# EAGLE schematic rev02 (EAGLE 7.5.0), part 1 of 2
CrypTech Alpha board Revision 02 (c) NORDUnet A/S

## Sheet 1 of 26
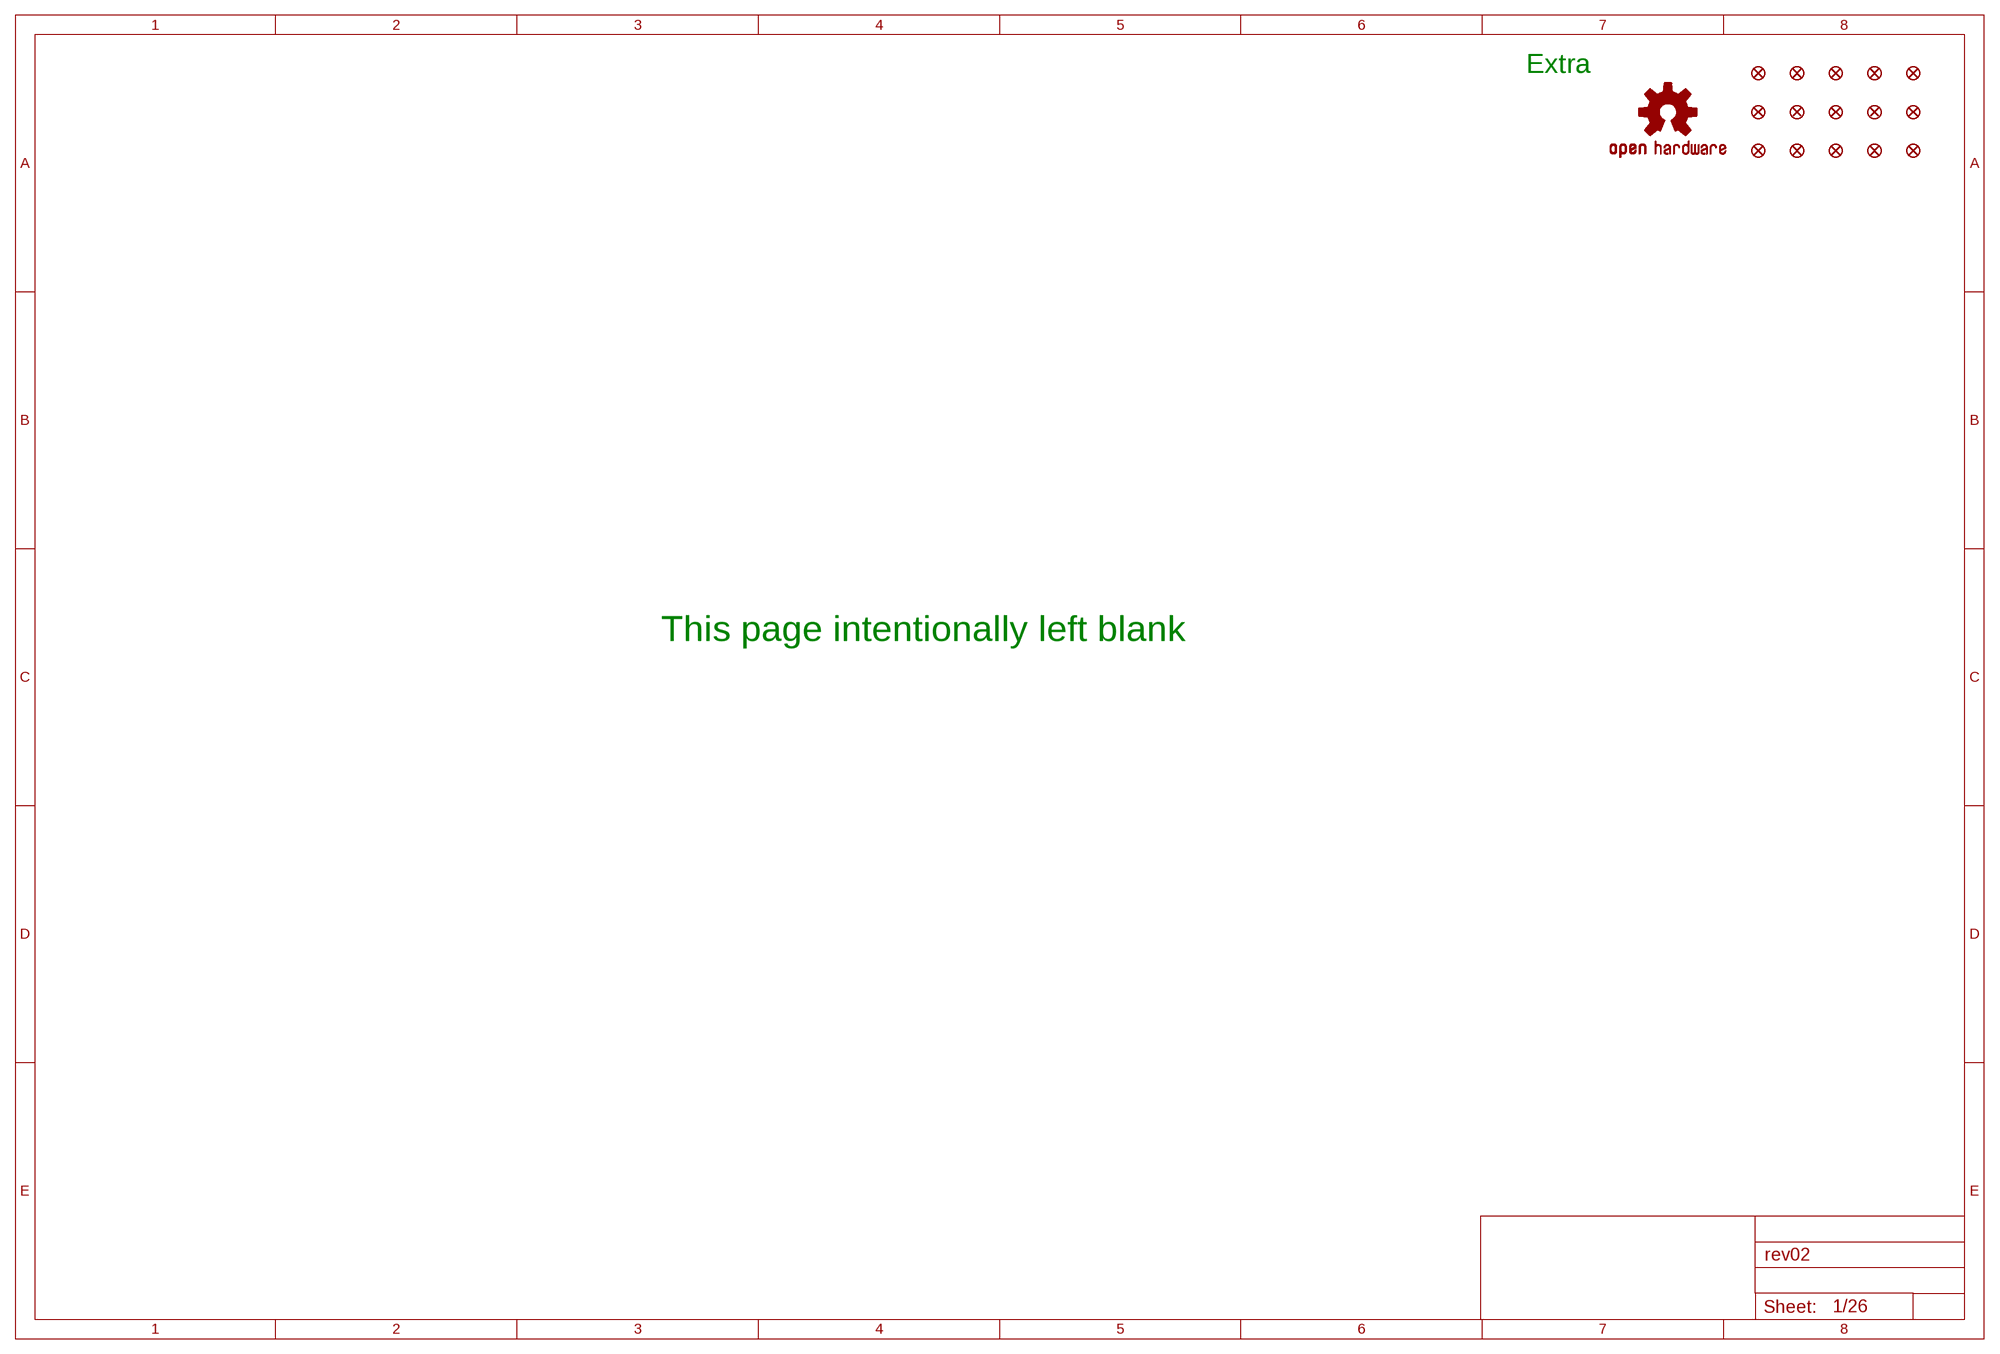
[diagram p0: schematic, sheet 1]

### Parts
FID1  FIDUCIAL1X2  [FIDUCIAL-1X2]
FID2  FIDUCIAL1X2  [FIDUCIAL-1X2]
FID3  FIDUCIAL1X2  [FIDUCIAL-1X2]
FID4  FIDUCIAL1X2  [FIDUCIAL-1X2]
FID5  FIDUCIAL1X2  [FIDUCIAL-1X2]
FID6  FIDUCIAL1X2  [FIDUCIAL-1X2]
FID7  FIDUCIAL1X2  [FIDUCIAL-1X2]
FID8  FIDUCIAL1X2  [FIDUCIAL-1X2]
FID9  FIDUCIAL1X2  [FIDUCIAL-1X2]
FID10  FIDUCIAL1X2  [FIDUCIAL-1X2]
FID11  FIDUCIAL1X2  [FIDUCIAL-1X2]
FID12  FIDUCIAL1X2  [FIDUCIAL-1X2]
FID13  FIDUCIAL1X2  [FIDUCIAL-1X2]
FID14  FIDUCIAL1X2  [FIDUCIAL-1X2]
FID15  FIDUCIAL1X2  [FIDUCIAL-1X2]
LOGO1  OSHW-LOGOL-COPPER  [OSHW-LOGO-L_COPPER]

### Notes on the sheet
- Extra
- This page intentionally left blank

## Sheet 2 of 26: Input power
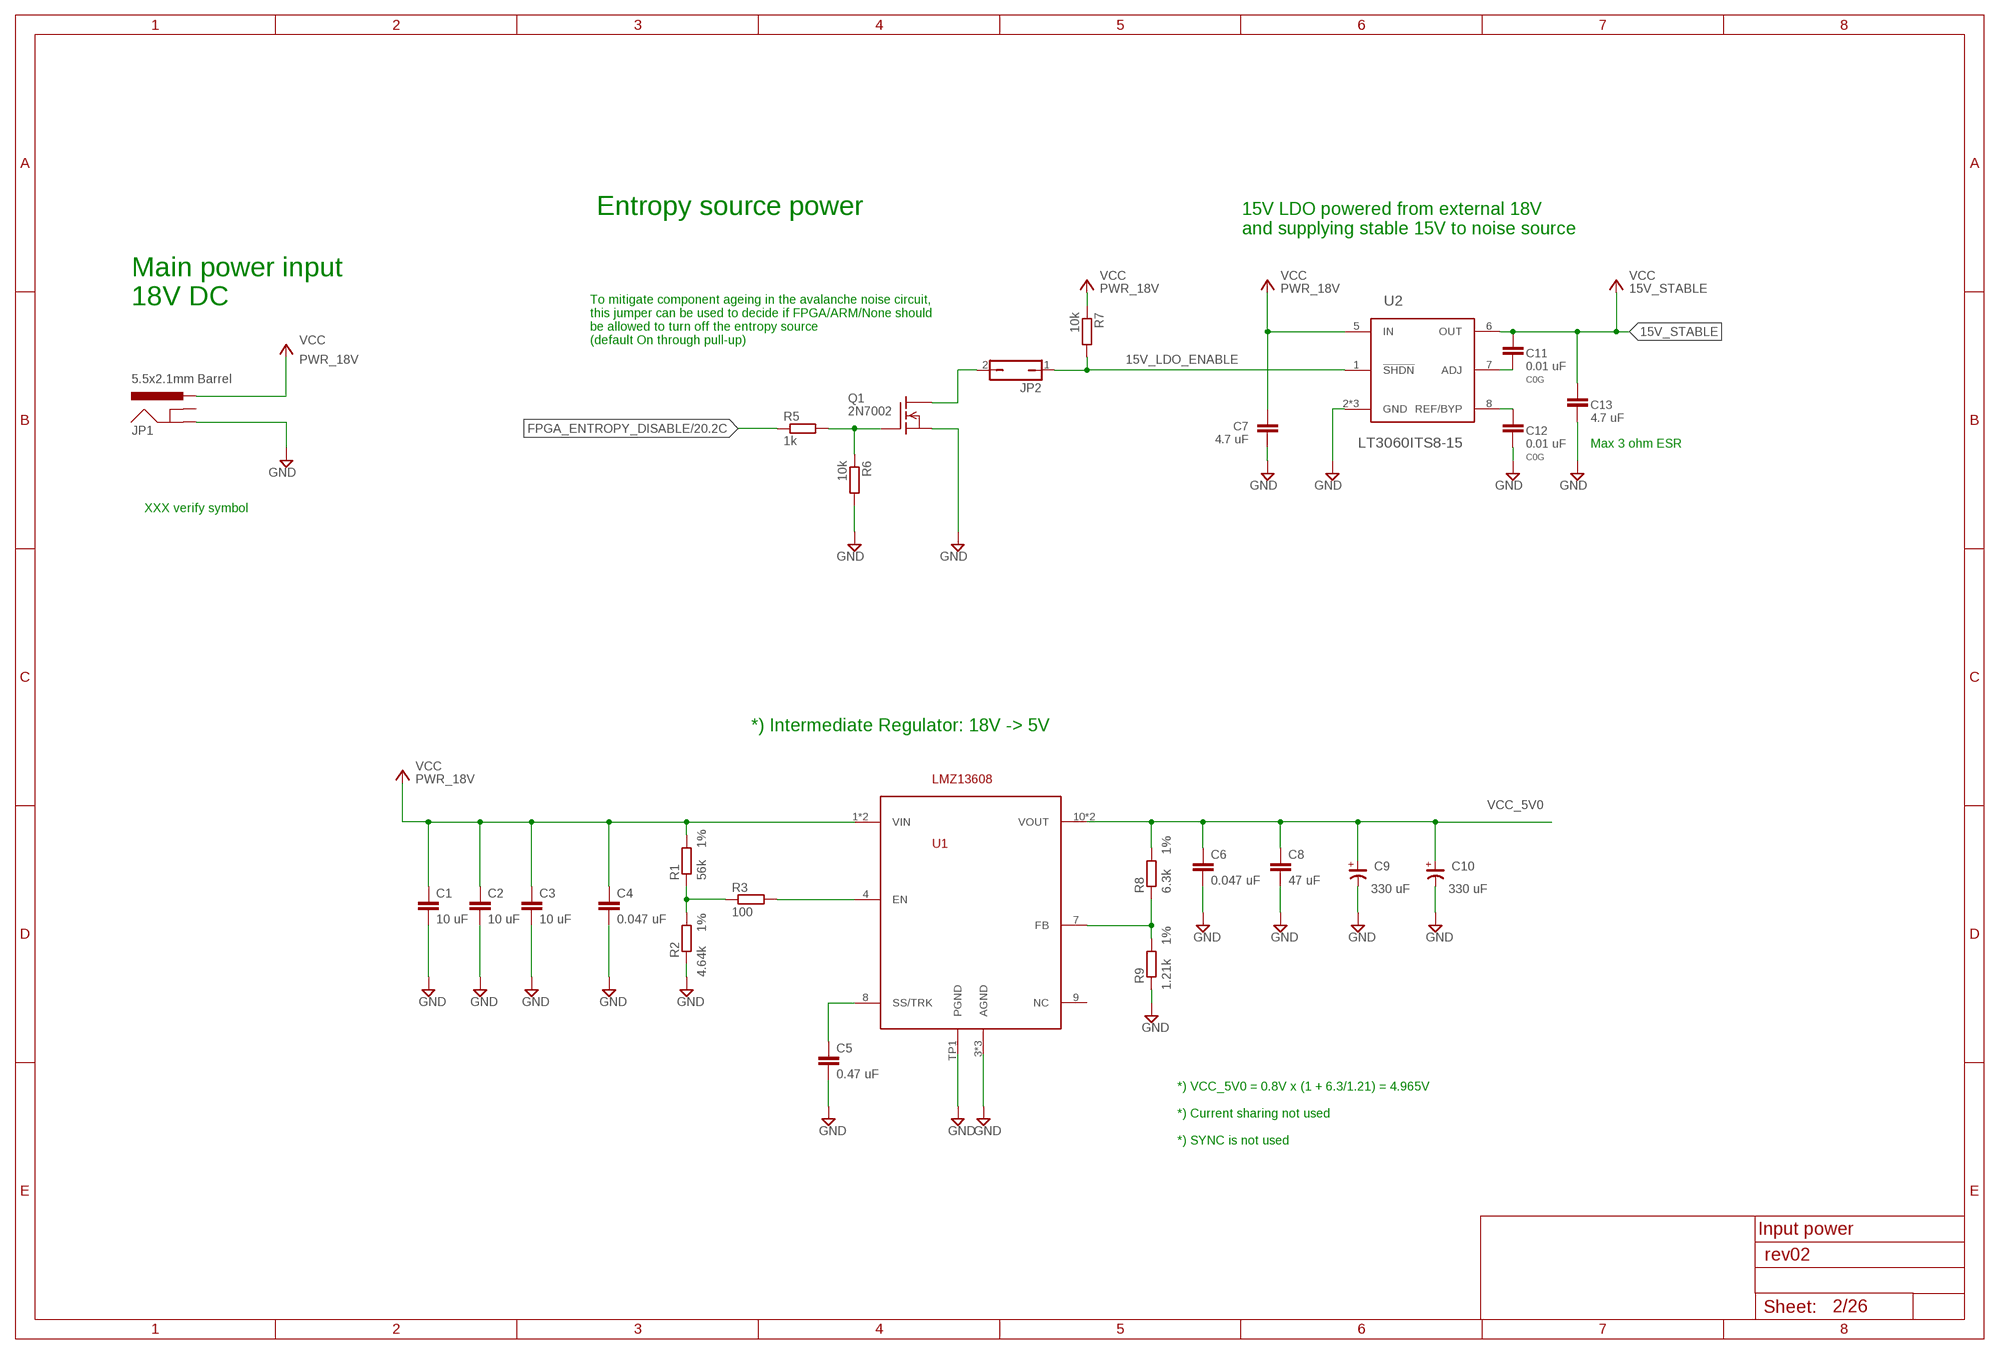
[diagram p1: schematic, sheet 2]

### Parts
C1  10 uF  C-EUC1210  [C1210]
C2  10 uF  C-EUC1210  [C1210]
C3  10 uF  C-EUC1210  [C1210]
C4  0.047 uF  C-EUC0402  [C0402]
C5  0.47 uF  C-EUC0603  [C0603]
C6  0.047 uF  C-EUC0402  [C0402]
C7  4.7 uF  C-EUC0603  [C0603]
C8  47 uF  C-EUC1210  [C1210]
C9  330 uF  CP_E-035X080  [CE-035X080]
C10  330 uF  CP_E-035X080  [CE-035X080]
C11  0.01 uF  C-EUC0402  [C0402]
C12  0.01 uF  C-EUC0402  [C0402]
C13  4.7 uF  C-EUC0603  [C0603]
JP1  5.5x2.1mm Barrel  POWER_JACKSMD  [POWER_JACK_SMD]
JP2  JP1Q  [JP1]
Q1  2N7002  [SOT23]
R1  56k  R-EU_R0402  [R0402]
R2  4.64k  R-EU_R0402  [R0402]
R3  100  R-EU_R0402  [R0402]
R5  1k  R-EU_R0402  [R0402]
R6  10k  R-EU_R0402  [R0402]
R7  10k  R-EU_R0402  [R0402]
R8  6.3k  R-EU_R0402  [R0402]
R9  1.21k  R-EU_R0402  [R0402]
U1  LMZ13608  [NDY]
U2  LT3060ITS8-15  [TSOT-8-23]

### Nets
15V_LDO_ENABLE: JP2.1 R7.2 U2.1(!SHDN)
15V_STABLE: C11.2 C13.1 U2.6(OUT) ; supply symbol labelled VCC ; also sheet 3
FPGA_ENTROPY_DISABLE: R5.1 ; also sheet 20
GND [Ground]: C1.2 C2.2 C3.2 C4.2 C5.2 C6.2 C7.2 C8.2 C9.- C10.- C12.1 C13.2 JP1.P$4(GND) Q1.2(S) R2.1 R6.2 R9.1 U1.3(AGND) U1.5(AGND) U1.6(AGND) U1.TP1(PGND) U2.2(GND) U2.3(GND) U2.4(GND) ; also sheet 3,4,5,7,8,9,10,11,12,13,14,15,16,19,20,22,23,24,25,26
N$1: C11.1 U2.7(ADJ)
N$2: C12.2 U2.8(REF/BYP)
N$11: Q1.1(G) R5.2 R6.1
N$14: JP2.2 Q1.3(D)
N$52: C5.1 U1.8(SS/TRK)
N$54: R1.1 R2.2 R3.1
N$55: R3.2 U1.4(EN)
N$56: R8.1 R9.2 U1.7(FB)
PWR_18V: C1.1 C2.1 C3.1 C4.1 C7.1 JP1.VIN0(PWR) R1.2 R7.1 U1.1(VIN) U1.2(VIN) U2.5(IN) ; supply symbol labelled VCC
VCC_5V0: C6.1 C8.1 C9.+ C10.+ R8.2 U1.10(VOUT) U1.11(VOUT) ; also sheet 19,25,26
Unconnected: JP1.GND(GNDBREAK) U1.9(NC)

### Notes on the sheet
- Entropy source power
- 15V LDO powered from external 18V
  and supplying stable 15V to noise source
- Main power input
  18V DC
- To mitigate component ageing in the avalanche noise circuit,
  this jumper can be used to decide if FPGA/ARM/None should
  be allowed to turn off the entropy source
  (default On through pull-up)
- Max 3 ohm ESR
- XXX verify symbol
- *) Intermediate Regulator: 18V -> 5V
- *) VCC_5V0 = 0.8V x (1 + 6.3/1.21) = 4.965V
  
  *) Current sharing not used
  
  *) SYNC is not used
- Input power

## Sheet 3 of 26: Noise source
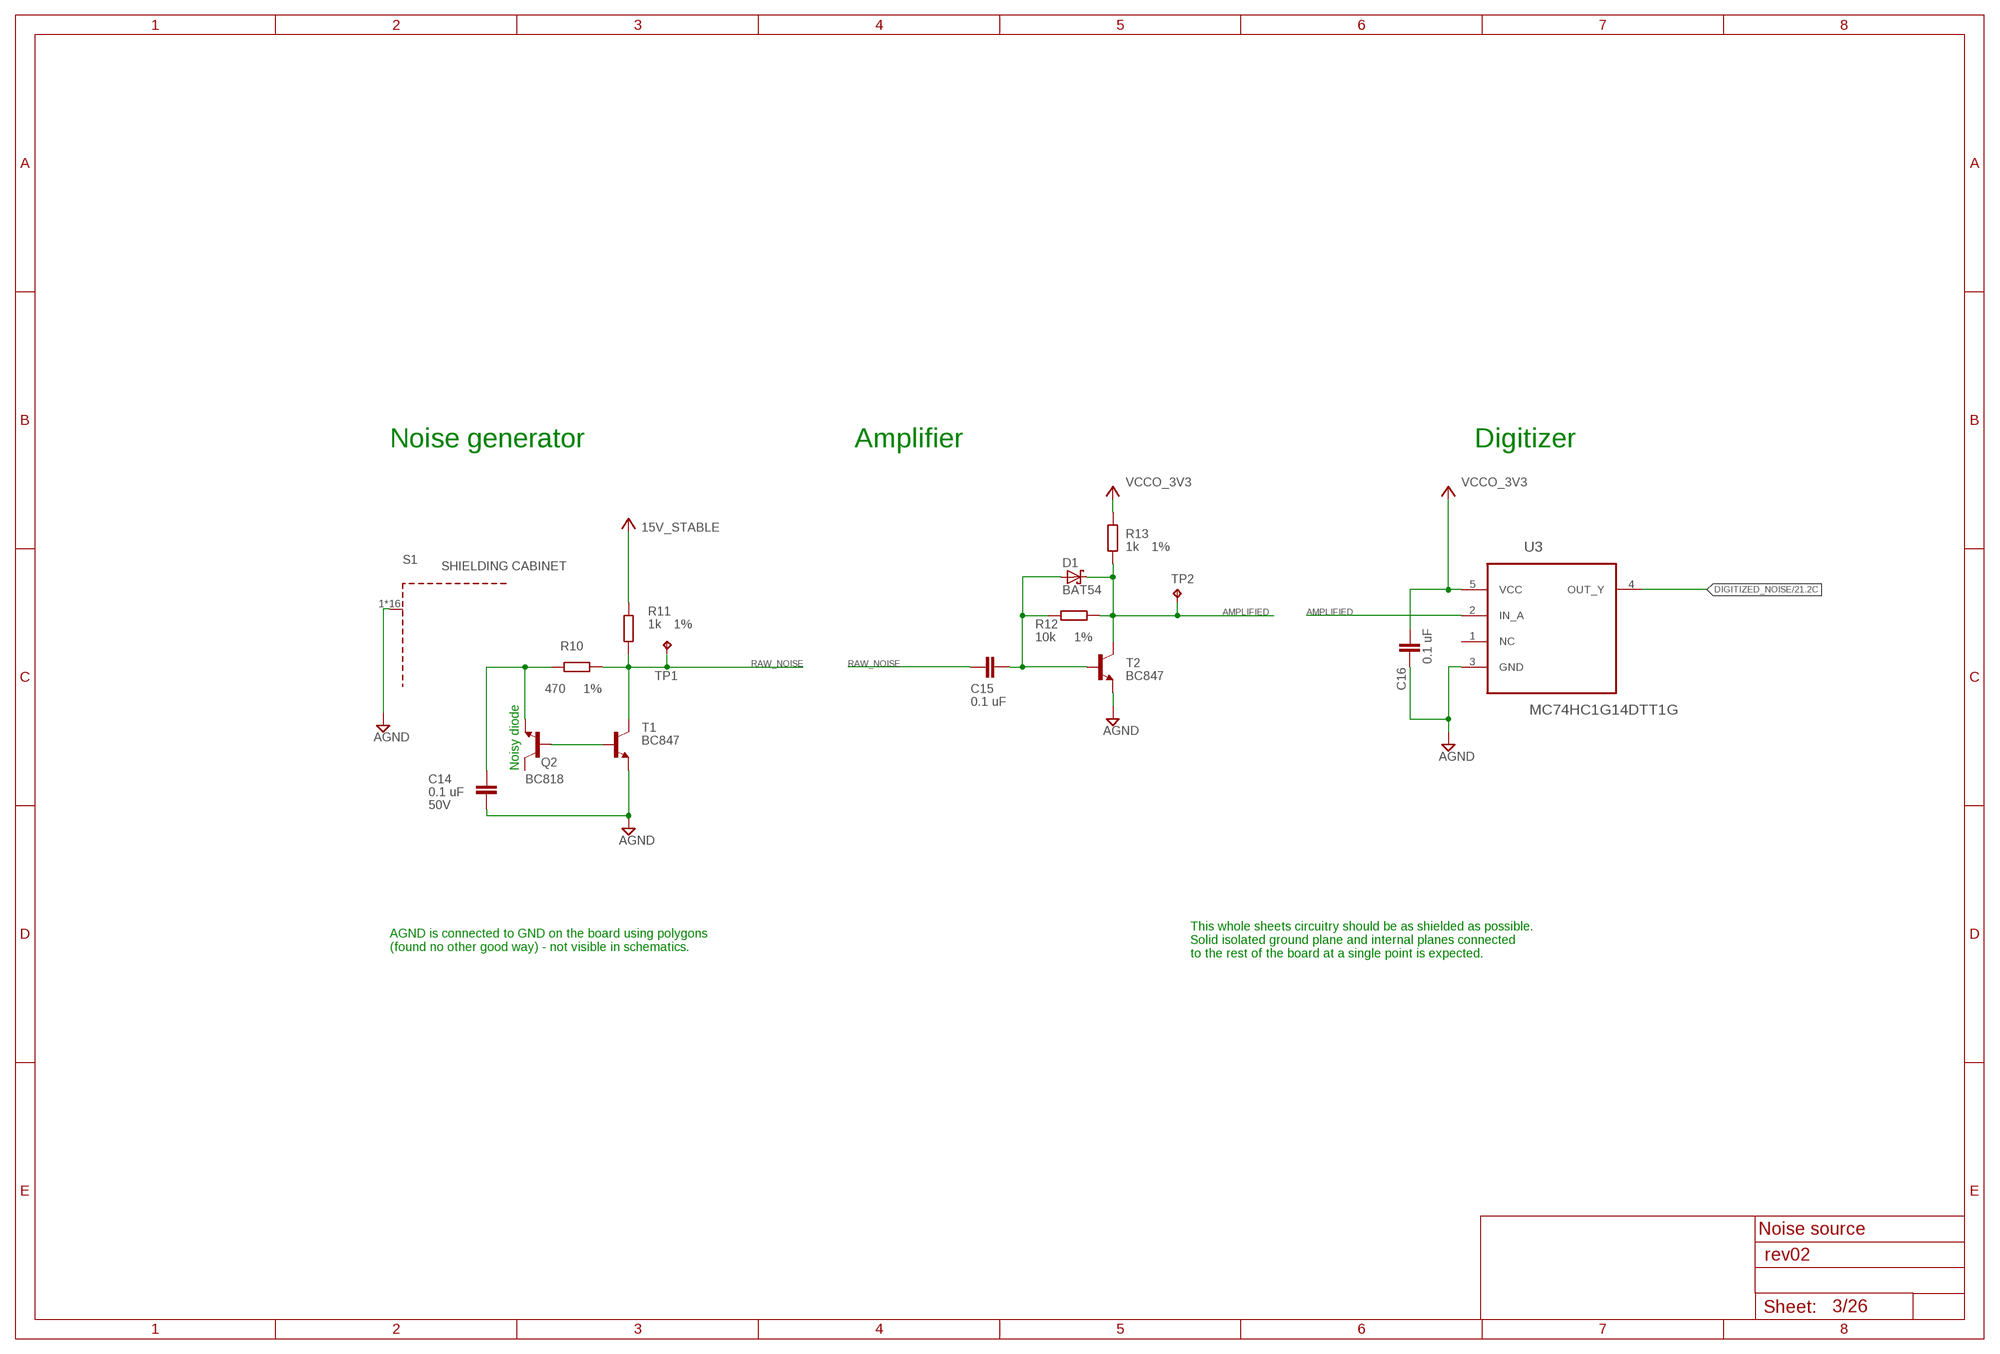
[diagram p2: schematic, sheet 3]

### Parts
C14  0.1 uF  C-EUC0603  [C0603]
C15  0.1 uF  C-EUC0603  [C0603]
C16  0.1 uF  C-EUC0603  [C0603]
D1  BAT54  [SOT23]
Q2  BC818  BC818-40SMD  [SOT23-BEC]
R10  470  R-EU_R0402  [R0402]
R11  1k  R-EU_R0402  [R0402]
R12  10k  R-EU_R0402  [R0402]
R13  1k  R-EU_R0402  [R0402]
S1  SHIELDING CABINET  WE-SHC  [WE-SHC_36103205_NO_CREAM]
T1  BC847  [SOT23]
T2  BC847  [SOT23]
TP1  TPB1,27  [B1,27]
TP2  TPB1,27  [B1,27]
U3  MC74HC1G14DTT1G  [SOT95P275X110-5N]

### Nets
15V_STABLE: R11.1 ; supply symbol labelled VCC ; also sheet 2
AGND: C16.1 S1.1(GND) S1.2(GND) S1.3(GND) S1.4(GND) S1.5(GND) S1.6(GND) S1.7(GND) S1.8(GND) S1.9(GND) S1.10(GND) S1.11(GND) S1.12(GND) S1.13(GND) S1.14(GND) S1.15(GND) S1.16(GND) T2.2(E) U3.3(GND)
AMP_P1: C15.2 D1.1(A) R12.1 T2.1(B)
AMPLIFIED: D1.3(C) R12.2 R13.1 T2.3(C) TP2.TP U3.2(IN_A)
DIGITIZED_NOISE: U3.4(OUT_Y) ; also sheet 21
GND [Ground]: C14.1 T1.2(E) ; supply symbol labelled AGND ; also sheet 2,4,5,7,8,9,10,11,12,13,14,15,16,19,20,22,23,24,25,26
NOISE_IN: C14.2 Q2.E R10.2
NOISE_OUT: Q2.B T1.1(B)
RAW_NOISE: C15.1 R10.1 R11.2 T1.3(C) TP1.TP
VCCO_3V3: C16.2 R13.2 U3.5(VCC) ; supply symbol labelled VCC ; also sheet 4,5,7,8,9,10,11,12,14,16,17,18,19,20,21,24
Unconnected: Q2.C U3.1(NC)

### Notes on the sheet
- Noise generator | Amplifier | Digitizer
- Noisy diode
- AGND is connected to GND on the board using polygons
  (found no other good way) - not visible in schematics.
- This whole sheets circuitry should be as shielded as possible.
  Solid isolated ground plane and internal planes connected
  to the rest of the board at a single point is expected.
- Noise source

## Sheet 4 of 26: ARM Configuration
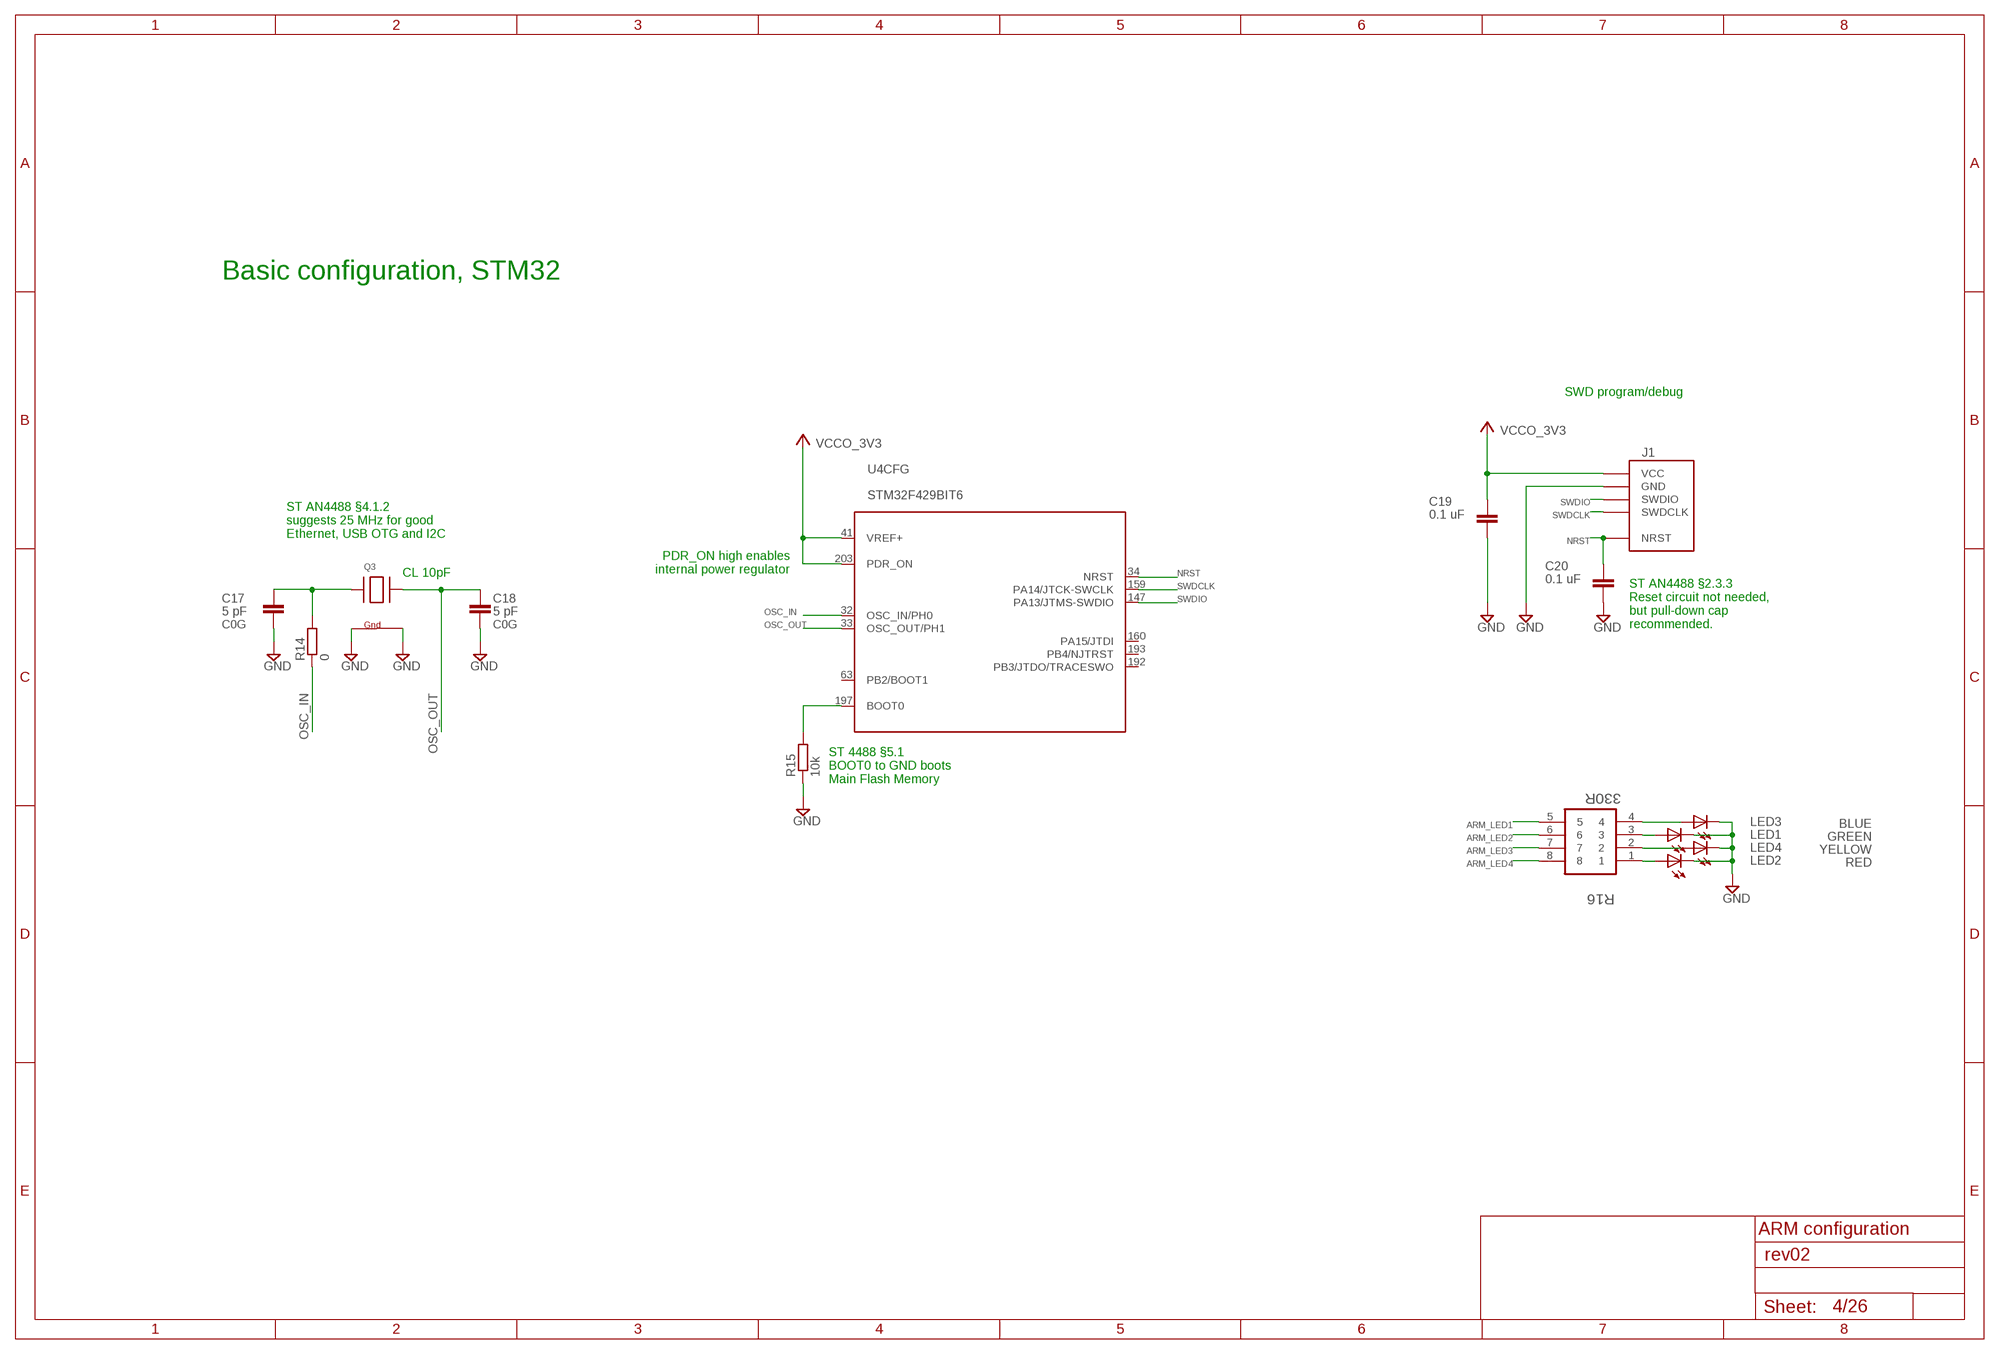
[diagram p3: schematic, sheet 4]

### Parts
C17  5 pF  C-EUC0402  [C0402]
C18  5 pF  C-EUC0402  [C0402]
C19  0.1 uF  C-EUC0402  [C0402]
C20  0.1 uF  C-EUC0402  [C0402]
J1  STM32-SWD  [100MIL_THT]
LED1  GREEN  LEDCHIP-LED0603  [CHIP-LED0603]
LED2  RED  LEDCHIP-LED0603  [CHIP-LED0603]
LED3  BLUE  LEDCHIP-LED0603  [CHIP-LED0603]
LED4  YELLOW  LEDCHIP-LED0603  [CHIP-LED0603]
Q3  XTAL-4-3225  [NX3225]
R14  0  R-EU_R0402  [R0402]
R15  10k  R-EU_R0402  [R0402]
R16  330R  EXB38V331JV  [RESCAXE80P320X160X60-8N]
U4  STM32F429BIT6  [LQFP-208]

### Nets
ARM_LED1: R16.5 ; also sheet 6
ARM_LED2: R16.6 ; also sheet 6
ARM_LED3: R16.7 ; also sheet 6
ARM_LED4: R16.8 ; also sheet 6
BOOT0 [Ground]: R15.2 U4.197(CFG:BOOT0)
GND [Ground]: C17.1 C18.1 C19.2 C20.2 J1.P$GND(GND) LED1.C LED2.C LED3.C LED4.C Q3.2(G2) Q3.4(G1) R15.1 ; also sheet 2,3,5,7,8,9,10,11,12,13,14,15,16,19,20,22,23,24,25,26
N$17: LED3.A R16.4
N$18: LED1.A R16.3
N$19: LED4.A R16.2
N$20: LED2.A R16.1
N$21: C17.2 Q3.1(X1) R14.2
NRST: C20.1 J1.P$NRST(NRST) U4.34(CFG:NRST)
OSC_IN: R14.1 U4.32(CFG:OSC_IN/PH0)
OSC_OUT: C18.2 Q3.3(X2) U4.33(CFG:OSC_OUT/PH1)
SWDCLK: J1.P$SWDCLK(SWDCLK) U4.159(CFG:PA14/JTCK-SWCLK)
SWDIO: J1.P$SWDIO(SWDIO) U4.147(CFG:PA13/JTMS-SWDIO)
VCCO_3V3: C19.1 J1.P$VCC(VCC) U4.41(CFG:VREF+) U4.203(CFG:PDR_ON) ; supply symbol labelled VCC ; also sheet 3,5,7,8,9,10,11,12,14,16,17,18,19,20,21,24
Unconnected: U4.63(CFG:PB2/BOOT1) U4.160(CFG:PA15/JTDI) U4.192(CFG:PB3/JTDO/TRACESWO) U4.193(CFG:PB4/NJTRST)

### Notes on the sheet
- Basic configuration, STM32
- SWD program/debug
- ST AN4488 §4.1.2
  suggests 25 MHz for good
  Ethernet, USB OTG and I2C
- PDR_ON high enables
  internal power regulator
- CL 10pF
- ST AN4488 §2.3.3
  Reset circuit not needed,
  but pull-down cap
  recommended.
- ST 4488 §5.1
  BOOT0 to GND boots
  Main Flash Memory
- ARM configuration

## Sheet 5 of 26: ARM Power
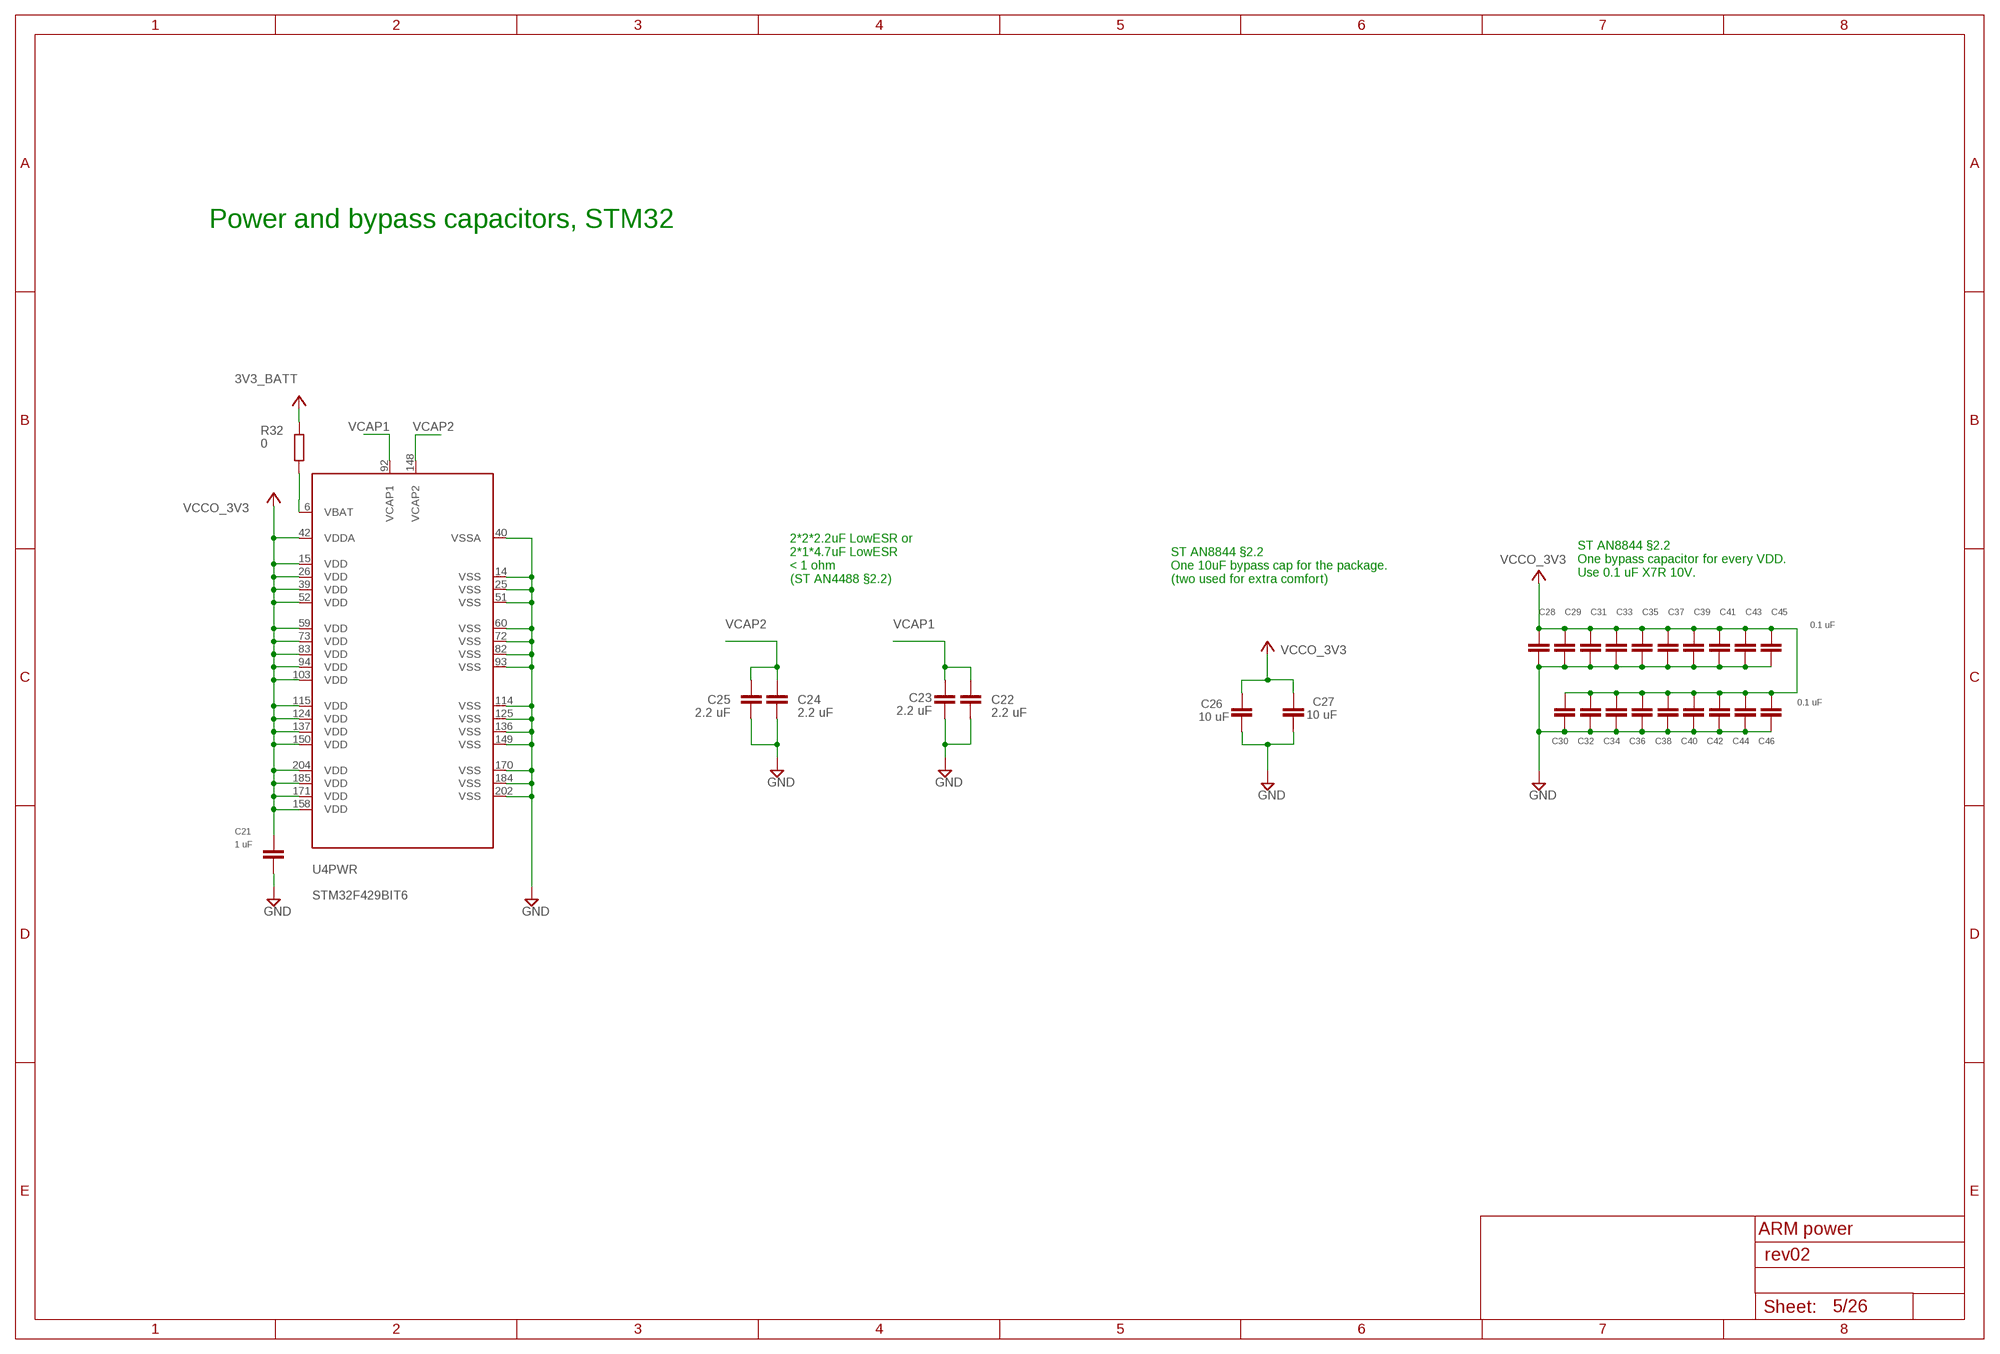
[diagram p4: schematic, sheet 5]

### Parts
C21  1 uF  C-EUC0603  [C0603]
C22  2.2 uF  C-EUC0603  [C0603]
C23  2.2 uF  C-EUC0603  [C0603]
C24  2.2 uF  C-EUC0603  [C0603]
C25  2.2 uF  C-EUC0603  [C0603]
C26  10 uF  C-EUC0805  [C0805]
C27  10 uF  C-EUC0805  [C0805]
C28  0.1 uF  C-EUC0402  [C0402]
C29  0.1 uF  C-EUC0402  [C0402]
C30  0.1 uF  C-EUC0402  [C0402]
C31  0.1 uF  C-EUC0402  [C0402]
C32  0.1 uF  C-EUC0402  [C0402]
C33  0.1 uF  C-EUC0402  [C0402]
C34  0.1 uF  C-EUC0402  [C0402]
C35  0.1 uF  C-EUC0402  [C0402]
C36  0.1 uF  C-EUC0402  [C0402]
C37  0.1 uF  C-EUC0402  [C0402]
C38  0.1 uF  C-EUC0402  [C0402]
C39  0.1 uF  C-EUC0402  [C0402]
C40  0.1 uF  C-EUC0402  [C0402]
C41  0.1 uF  C-EUC0402  [C0402]
C42  0.1 uF  C-EUC0402  [C0402]
C43  0.1 uF  C-EUC0402  [C0402]
C44  0.1 uF  C-EUC0402  [C0402]
C45  0.1 uF  C-EUC0402  [C0402]
C46  0.1 uF  C-EUC0402  [C0402]
R32  0  R-EU_R0402  [R0402]

### Nets
3V3_BATT: R32.1 ; supply symbol labelled VCC ; also sheet 9,12,13
GND [Ground]: C21.2 C22.1 C23.1 C24.1 C25.1 C26.2 C27.2 C28.2 C29.2 C30.2 C31.2 C32.2 C33.2 C34.2 C35.2 C36.2 C37.2 C38.2 C39.2 C40.2 C41.2 C42.2 C43.2 C44.2 C45.2 C46.2 U4.14(PWR:VSS) U4.25(PWR:VSS) U4.40(PWR:VSSA) U4.51(PWR:VSS) U4.60(PWR:VSS) U4.72(PWR:VSS) U4.82(PWR:VSS) U4.93(PWR:VSS) U4.114(PWR:VSS) U4.125(PWR:VSS) U4.136(PWR:VSS) U4.149(PWR:VSS) U4.170(PWR:VSS) U4.184(PWR:VSS) U4.202(PWR:VSS) ; also sheet 2,3,4,7,8,9,10,11,12,13,14,15,16,19,20,22,23,24,25,26
N$25: U4.6(PWR:VBAT)
N$53: R32.2
VCAP1: C22.2 C23.2 U4.92(PWR:VCAP1)
VCAP2: C24.2 C25.2 U4.148(PWR:VCAP2)
VCCO_3V3: C21.1 C26.1 C27.1 C28.1 C29.1 C30.1 C31.1 C32.1 C33.1 C34.1 C35.1 C36.1 C37.1 C38.1 C39.1 C40.1 C41.1 C42.1 C43.1 C44.1 C45.1 C46.1 U4.15(PWR:VDD) U4.26(PWR:VDD) U4.39(PWR:VDD) U4.42(PWR:VDDA) U4.52(PWR:VDD) U4.59(PWR:VDD) U4.73(PWR:VDD) U4.83(PWR:VDD) U4.94(PWR:VDD) U4.103(PWR:VDD) U4.115(PWR:VDD) U4.124(PWR:VDD) U4.137(PWR:VDD) U4.150(PWR:VDD) U4.158(PWR:VDD) U4.171(PWR:VDD) U4.185(PWR:VDD) U4.204(PWR:VDD) ; supply symbol labelled VCC ; also sheet 3,4,7,8,9,10,11,12,14,16,17,18,19,20,21,24

### Notes on the sheet
- Power and bypass capacitors, STM32
- ST AN8844 §2.2
  One bypass capacitor for every VDD.
  Use 0.1 uF X7R 10V.
- 2*2*2.2uF LowESR or
  2*1*4.7uF LowESR
  < 1 ohm
  (ST AN4488 §2.2)
- ST AN8844 §2.2
  One 10uF bypass cap for the package.
  (two used for extra comfort)
- ARM power

## Sheet 6 of 26: ARM I/O
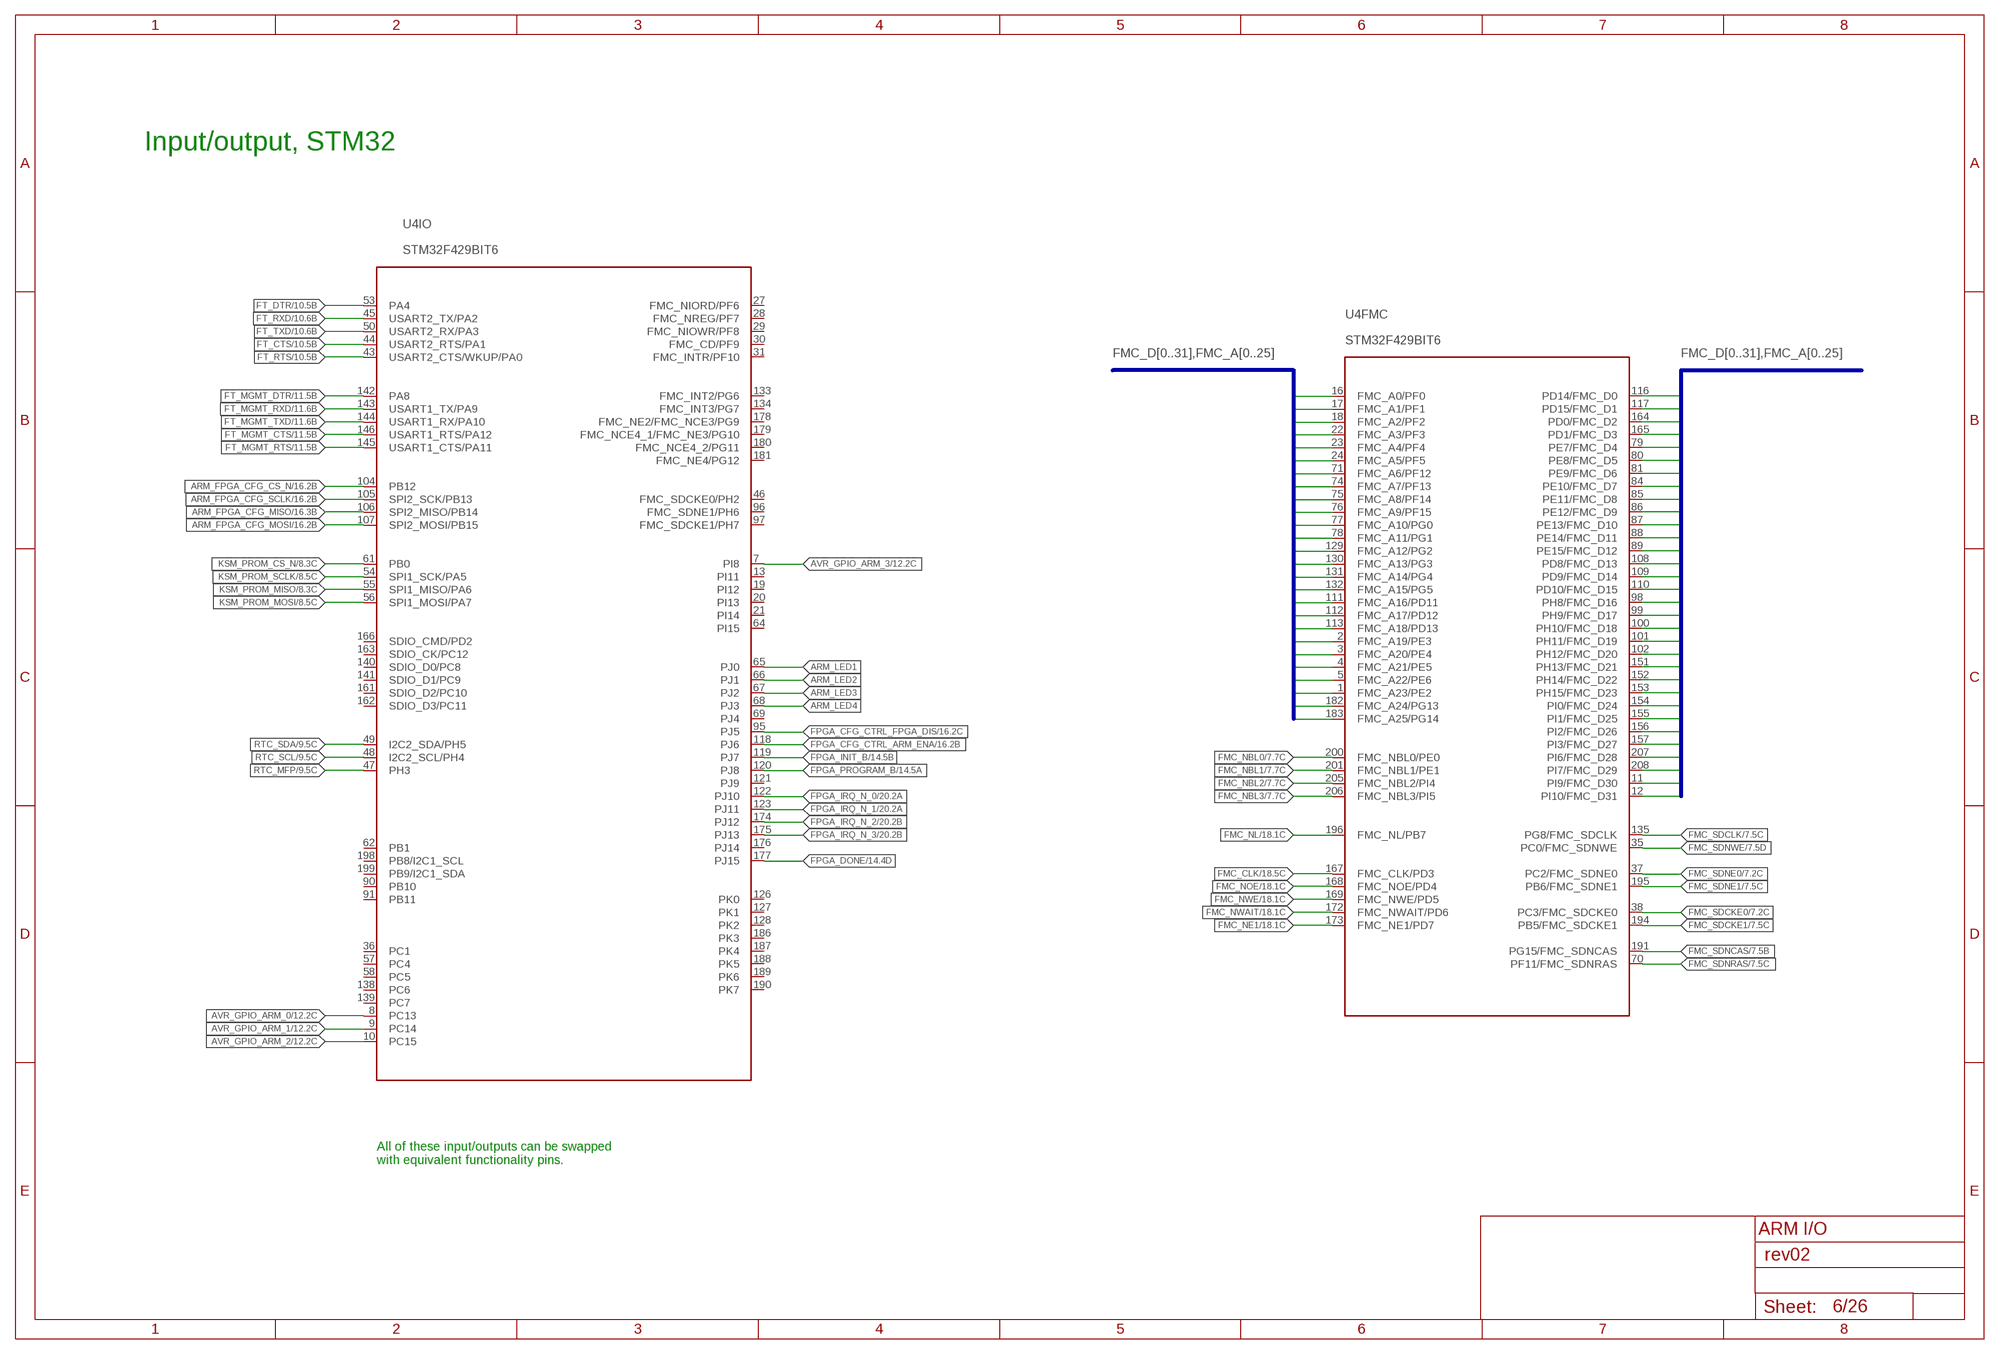
[diagram p5: schematic, sheet 6]

### Nets
ARM_FPGA_CFG_CS_N: U4.104(IO:PB12) ; also sheet 16
ARM_FPGA_CFG_MISO: U4.106(IO:SPI2_MISO/PB14) ; also sheet 16
ARM_FPGA_CFG_MOSI: U4.107(IO:SPI2_MOSI/PB15) ; also sheet 16
ARM_FPGA_CFG_SCLK: U4.105(IO:SPI2_SCK/PB13) ; also sheet 16
ARM_LED1: U4.65(IO:PJ0) ; also sheet 4
ARM_LED2: U4.66(IO:PJ1) ; also sheet 4
ARM_LED3: U4.67(IO:PJ2) ; also sheet 4
ARM_LED4: U4.68(IO:PJ3) ; also sheet 4
AVR_GPIO_ARM_0: U4.8(IO:PC13) ; also sheet 12
AVR_GPIO_ARM_1: U4.9(IO:PC14) ; also sheet 12
FMC_A0 [FMC ADDR]: U4.16(FMC:FMC_A0/PF0) ; also sheet 7,18
FMC_A1 [FMC ADDR]: U4.17(FMC:FMC_A1/PF1) ; also sheet 7,18
FMC_A2 [FMC ADDR]: U4.18(FMC:FMC_A2/PF2) ; also sheet 7,18
FMC_A3 [FMC ADDR]: U4.22(FMC:FMC_A3/PF3) ; also sheet 7,18
FMC_A4 [FMC ADDR]: U4.23(FMC:FMC_A4/PF4) ; also sheet 7,18
FMC_A5 [FMC ADDR]: U4.24(FMC:FMC_A5/PF5) ; also sheet 7,18
FMC_A6 [FMC ADDR]: U4.71(FMC:FMC_A6/PF12) ; also sheet 7,18
FMC_A7 [FMC ADDR]: U4.74(FMC:FMC_A7/PF13) ; also sheet 7,18
FMC_A8 [FMC ADDR]: U4.75(FMC:FMC_A8/PF14) ; also sheet 7,18
FMC_A9 [FMC ADDR]: U4.76(FMC:FMC_A9/PF15) ; also sheet 7,18
FMC_A10 [FMC ADDR]: U4.77(FMC:FMC_A10/PG0) ; also sheet 7,18
FMC_A11 [FMC ADDR]: U4.78(FMC:FMC_A11/PG1) ; also sheet 7,18
FMC_A12 [FMC ADDR]: U4.129(FMC:FMC_A12/PG2) ; also sheet 7,18
FMC_A13 [FMC ADDR]: U4.130(FMC:FMC_A13/PG3) ; also sheet 18
FMC_A14 [FMC ADDR]: U4.131(FMC:FMC_A14/PG4) ; also sheet 7,18
FMC_A15 [FMC ADDR]: U4.132(FMC:FMC_A15/PG5) ; also sheet 7,18
FMC_A16 [FMC ADDR]: U4.111(FMC:FMC_A16/PD11) ; also sheet 18
FMC_A17 [FMC ADDR]: U4.112(FMC:FMC_A17/PD12) ; also sheet 18
FMC_A18 [FMC ADDR]: U4.113(FMC:FMC_A18/PD13) ; also sheet 18
FMC_A19 [FMC ADDR]: U4.2(FMC:FMC_A19/PE3) ; also sheet 18
FMC_A20: U4.3(FMC:FMC_A20/PE4) ; also sheet 18
FMC_A21: U4.4(FMC:FMC_A21/PE5) ; also sheet 18
FMC_A22: U4.5(FMC:FMC_A22/PE6) ; also sheet 18
FMC_A23: U4.1(FMC:FMC_A23/PE2) ; also sheet 18
FMC_A24: U4.182(FMC:FMC_A24/PG13) ; also sheet 18
FMC_A25: U4.183(FMC:FMC_A25/PG14) ; also sheet 18
FMC_CLK: U4.167(FMC:FMC_CLK/PD3) ; also sheet 18
FMC_D0 [FMC DATA]: U4.116(FMC:PD14/FMC_D0) ; also sheet 7,18
FMC_D1 [FMC DATA]: U4.117(FMC:PD15/FMC_D1) ; also sheet 7,18
FMC_D2 [FMC DATA]: U4.164(FMC:PD0/FMC_D2) ; also sheet 7,18
FMC_D3 [FMC DATA]: U4.165(FMC:PD1/FMC_D3) ; also sheet 7,18
FMC_D4 [FMC DATA]: U4.79(FMC:PE7/FMC_D4) ; also sheet 7,18
FMC_D5 [FMC DATA]: U4.80(FMC:PE8/FMC_D5) ; also sheet 7,18
FMC_D6 [FMC DATA]: U4.81(FMC:PE9/FMC_D6) ; also sheet 7,18
FMC_D7 [FMC DATA]: U4.84(FMC:PE10/FMC_D7) ; also sheet 7,18
FMC_D8 [FMC DATA]: U4.85(FMC:PE11/FMC_D8) ; also sheet 7,18
FMC_D9 [FMC DATA]: U4.86(FMC:PE12/FMC_D9) ; also sheet 18
FMC_D10 [FMC DATA]: U4.87(FMC:PE13/FMC_D10) ; also sheet 7,18
FMC_D11 [FMC DATA]: U4.88(FMC:PE14/FMC_D11) ; also sheet 7,18
FMC_D12 [FMC DATA]: U4.89(FMC:PE15/FMC_D12) ; also sheet 7,18
FMC_D13 [FMC DATA]: U4.108(FMC:PD8/FMC_D13) ; also sheet 7,18
FMC_D14 [FMC DATA]: U4.109(FMC:PD9/FMC_D14) ; also sheet 7,18
FMC_D15 [FMC DATA]: U4.110(FMC:PD10/FMC_D15) ; also sheet 7,18
FMC_D16 [FMC DATA]: U4.98(FMC:PH8/FMC_D16) ; also sheet 7,18
FMC_D17 [FMC DATA]: U4.99(FMC:PH9/FMC_D17) ; also sheet 7,18
FMC_D18 [FMC DATA]: U4.100(FMC:PH10/FMC_D18) ; also sheet 7,18
FMC_D19 [FMC DATA]: U4.101(FMC:PH11/FMC_D19) ; also sheet 7,18
FMC_D20 [FMC DATA]: U4.102(FMC:PH12/FMC_D20) ; also sheet 7,18
FMC_D21 [FMC DATA]: U4.151(FMC:PH13/FMC_D21) ; also sheet 7,18
FMC_D22 [FMC DATA]: U4.152(FMC:PH14/FMC_D22) ; also sheet 7,18
FMC_D23 [FMC DATA]: U4.153(FMC:PH15/FMC_D23) ; also sheet 7,18
FMC_D24 [FMC DATA]: U4.154(FMC:PI0/FMC_D24) ; also sheet 7,18
FMC_D25 [FMC DATA]: U4.155(FMC:PI1/FMC_D25) ; also sheet 7,18
FMC_D26 [FMC DATA]: U4.156(FMC:PI2/FMC_D26) ; also sheet 7,18
FMC_D27 [FMC DATA]: U4.157(FMC:PI3/FMC_D27) ; also sheet 7,18
FMC_D28 [FMC DATA]: U4.207(FMC:PI6/FMC_D28) ; also sheet 7,18
FMC_D29 [FMC DATA]: U4.208(FMC:PI7/FMC_D29) ; also sheet 7,18
FMC_D30 [FMC DATA]: U4.11(FMC:PI9/FMC_D30) ; also sheet 7,18
FMC_D31 [FMC DATA]: U4.12(FMC:PI10/FMC_D31) ; also sheet 7,18
FMC_NBL0: U4.200(FMC:FMC_NBL0/PE0) ; also sheet 7
FMC_NBL1: U4.201(FMC:FMC_NBL1/PE1) ; also sheet 7
FMC_NBL2: U4.205(FMC:FMC_NBL2/PI4) ; also sheet 7
FMC_NBL3: U4.206(FMC:FMC_NBL3/PI5) ; also sheet 7
FMC_NE1: U4.173(FMC:FMC_NE1/PD7) ; also sheet 18
FMC_NL: U4.196(FMC:FMC_NL/PB7) ; also sheet 18
FMC_NOE: U4.168(FMC:FMC_NOE/PD4) ; also sheet 18
FMC_NWAIT: U4.172(FMC:FMC_NWAIT/PD6) ; also sheet 18
FMC_NWE: U4.169(FMC:FMC_NWE/PD5) ; also sheet 18
FMC_SDCKE0: U4.38(FMC:PC3/FMC_SDCKE0) ; also sheet 7
FMC_SDCKE1: U4.194(FMC:PB5/FMC_SDCKE1) ; also sheet 7
FMC_SDCLK: U4.135(FMC:PG8/FMC_SDCLK) ; also sheet 7
FMC_SDNCAS: U4.191(FMC:PG15/FMC_SDNCAS) ; also sheet 7
FMC_SDNE0: U4.37(FMC:PC2/FMC_SDNE0) ; also sheet 7
FMC_SDNE1: U4.195(FMC:PB6/FMC_SDNE1) ; also sheet 7
FMC_SDNRAS: U4.70(FMC:PF11/FMC_SDNRAS) ; also sheet 7
FMC_SDNWE: U4.35(FMC:PC0/FMC_SDNWE) ; also sheet 7
FPGA_CFG_CTRL_ARM_ENA: U4.118(IO:PJ6) ; also sheet 16
FPGA_CFG_CTRL_FPGA_DIS: U4.95(IO:PJ5) ; also sheet 16
FPGA_DONE: U4.177(IO:PJ15) ; also sheet 14
FPGA_INIT_B: U4.119(IO:PJ7) ; also sheet 14
FPGA_IRQ_N_0: U4.122(IO:PJ10) ; also sheet 20
FPGA_IRQ_N_1: U4.123(IO:PJ11) ; also sheet 20
FPGA_IRQ_N_2: U4.174(IO:PJ12) ; also sheet 20
FPGA_IRQ_N_3: U4.175(IO:PJ13) ; also sheet 20
FPGA_PROGRAM_B: U4.120(IO:PJ8) ; also sheet 14
FT_CTS: U4.44(IO:USART2_RTS/PA1) ; also sheet 10
FT_DTR: U4.53(IO:PA4) ; also sheet 10
FT_MGMT_CTS: U4.146(IO:USART1_RTS/PA12) ; also sheet 11
FT_MGMT_DTR: U4.142(IO:PA8) ; also sheet 11
FT_MGMT_RTS: U4.145(IO:USART1_CTS/PA11) ; also sheet 11
FT_MGMT_RXD: U4.143(IO:USART1_TX/PA9) ; also sheet 11
FT_MGMT_TXD: U4.144(IO:USART1_RX/PA10) ; also sheet 11
FT_RTS: U4.43(IO:USART2_CTS/WKUP/PA0) ; also sheet 10
FT_RXD: U4.45(IO:USART2_TX/PA2) ; also sheet 10
FT_TXD: U4.50(IO:USART2_RX/PA3) ; also sheet 10
KSM_PROM_CS_N: U4.61(IO:PB0) ; also sheet 8
KSM_PROM_MISO: U4.55(IO:SPI1_MISO/PA6) ; also sheet 8
KSM_PROM_MOSI: U4.56(IO:SPI1_MOSI/PA7) ; also sheet 8
KSM_PROM_SCLK: U4.54(IO:SPI1_SCK/PA5) ; also sheet 8
RTC_MFP: U4.47(IO:PH3) ; also sheet 9
RTC_SCL: U4.48(IO:I2C2_SCL/PH4) ; also sheet 9
RTC_SDA: U4.49(IO:I2C2_SDA/PH5) ; also sheet 9
Unconnected: U4.7(IO:PI8) U4.10(IO:PC15) U4.13(IO:PI11) U4.19(IO:PI12) U4.20(IO:PI13) U4.21(IO:PI14) U4.27(IO:FMC_NIORD/PF6) U4.28(IO:FMC_NREG/PF7) U4.29(IO:FMC_NIOWR/PF8) U4.30(IO:FMC_CD/PF9) U4.31(IO:FMC_INTR/PF10) U4.36(IO:PC1) U4.46(IO:FMC_SDCKE0/PH2) U4.57(IO:PC4) U4.58(IO:PC5) U4.62(IO:PB1) U4.64(IO:PI15) U4.69(IO:PJ4) U4.90(IO:PB10) U4.91(IO:PB11) U4.96(IO:FMC_SDNE1/PH6) U4.97(IO:FMC_SDCKE1/PH7) U4.121(IO:PJ9) U4.126(IO:PK0) U4.127(IO:PK1) U4.128(IO:PK2) U4.133(IO:FMC_INT2/PG6) U4.134(IO:FMC_INT3/PG7) U4.138(IO:PC6) U4.139(IO:PC7) U4.140(IO:SDIO_D0/PC8) U4.141(IO:SDIO_D1/PC9) U4.161(IO:SDIO_D2/PC10) U4.162(IO:SDIO_D3/PC11) U4.163(IO:SDIO_CK/PC12) U4.166(IO:SDIO_CMD/PD2) U4.176(IO:PJ14) U4.178(IO:FMC_NE2/FMC_NCE3/PG9) U4.179(IO:FMC_NCE4_1/FMC_NE3/PG10) U4.180(IO:FMC_NCE4_2/PG11) U4.181(IO:FMC_NE4/PG12) U4.186(IO:PK3) U4.187(IO:PK4) U4.188(IO:PK5) U4.189(IO:PK6) U4.190(IO:PK7) U4.198(IO:PB8/I2C1_SCL) U4.199(IO:PB9/I2C1_SDA)

### Buses
FMC_D[0..31],FMC_A[0..25]

### Notes on the sheet
- Input/output, STM32
- All of these input/outputs can be swapped
  with equivalent functionality pins.
- ARM I/O

## Sheet 7 of 26: SDRAM
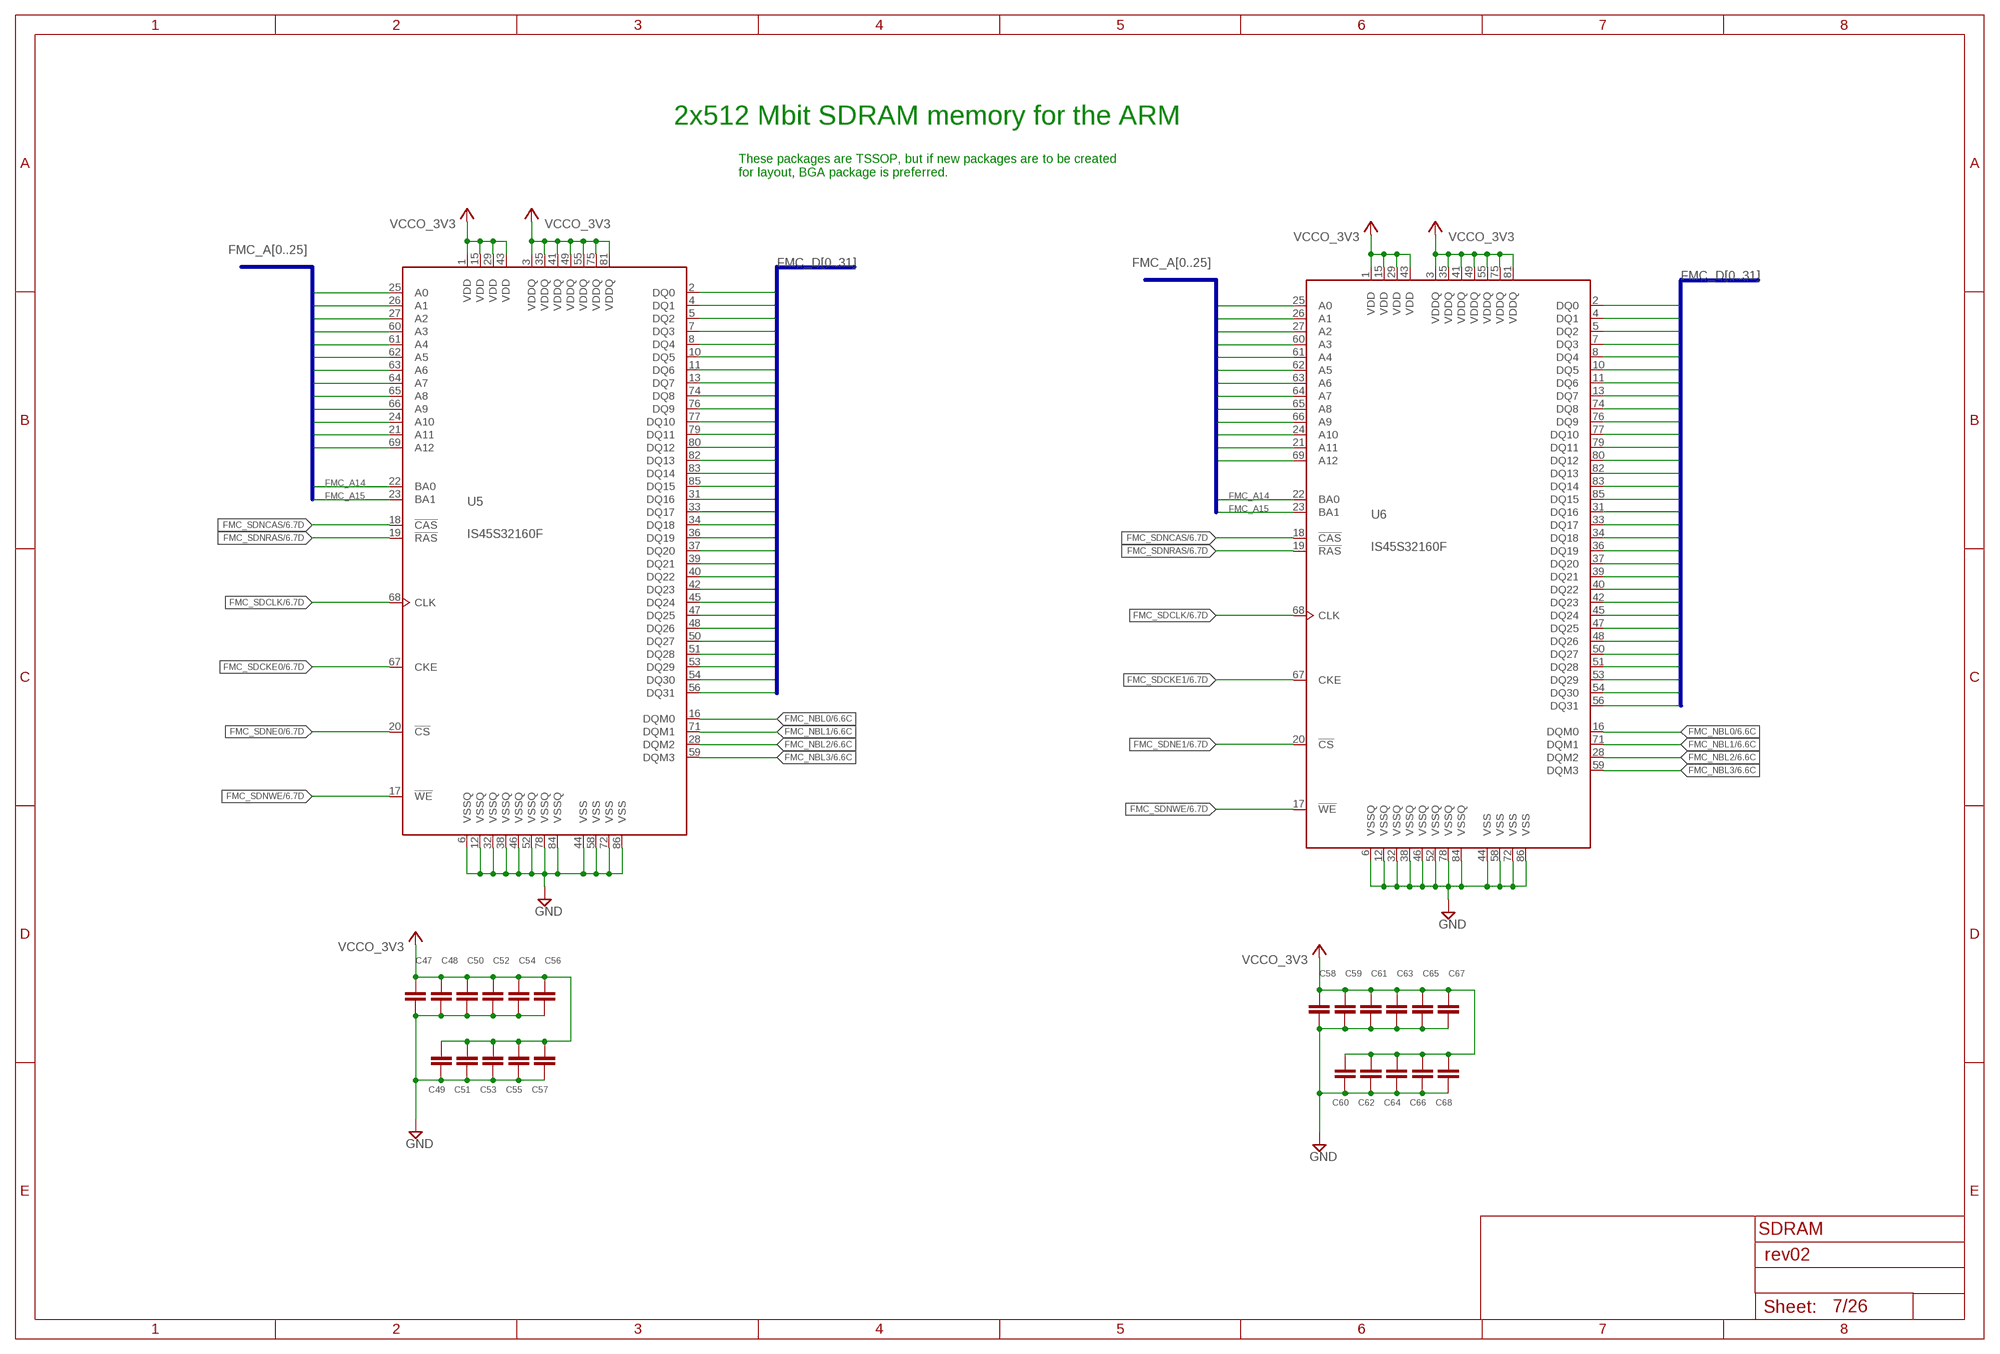
[diagram p6: schematic, sheet 7]

### Parts
C47  0.1 uF  C-EUC0402  [C0402]
C48  0.1 uF  C-EUC0402  [C0402]
C49  0.1 uF  C-EUC0402  [C0402]
C50  0.1 uF  C-EUC0402  [C0402]
C51  0.1 uF  C-EUC0402  [C0402]
C52  0.1 uF  C-EUC0402  [C0402]
C53  0.1 uF  C-EUC0402  [C0402]
C54  0.1 uF  C-EUC0402  [C0402]
C55  0.1 uF  C-EUC0402  [C0402]
C56  0.1 uF  C-EUC0402  [C0402]
C57  0.1 uF  C-EUC0402  [C0402]
C58  0.1 uF  C-EUC0402  [C0402]
C59  0.1 uF  C-EUC0402  [C0402]
C60  0.1 uF  C-EUC0402  [C0402]
C61  0.1 uF  C-EUC0402  [C0402]
C62  0.1 uF  C-EUC0402  [C0402]
C63  0.1 uF  C-EUC0402  [C0402]
C64  0.1 uF  C-EUC0402  [C0402]
C65  0.1 uF  C-EUC0402  [C0402]
C66  0.1 uF  C-EUC0402  [C0402]
C67  0.1 uF  C-EUC0402  [C0402]
C68  0.1 uF  C-EUC0402  [C0402]
U5  IS45S32160F  [TSOP2-86L]
U6  IS45S32160F  [TSOP2-86L]

### Nets
FMC_A0 [FMC ADDR]: U5.25(A0) U6.25(A0) ; also sheet 6,18
FMC_A1 [FMC ADDR]: U5.26(A1) U6.26(A1) ; also sheet 6,18
FMC_A2 [FMC ADDR]: U5.27(A2) U6.27(A2) ; also sheet 6,18
FMC_A3 [FMC ADDR]: U5.60(A3) U6.60(A3) ; also sheet 6,18
FMC_A4 [FMC ADDR]: U5.61(A4) U6.61(A4) ; also sheet 6,18
FMC_A5 [FMC ADDR]: U5.62(A5) U6.62(A5) ; also sheet 6,18
FMC_A6 [FMC ADDR]: U5.63(A6) U6.63(A6) ; also sheet 6,18
FMC_A7 [FMC ADDR]: U5.64(A7) U6.64(A7) ; also sheet 6,18
FMC_A8 [FMC ADDR]: U5.65(A8) U6.65(A8) ; also sheet 6,18
FMC_A9 [FMC ADDR]: U5.66(A9) U6.66(A9) ; also sheet 6,18
FMC_A10 [FMC ADDR]: U5.24(A10) U6.24(A10) ; also sheet 6,18
FMC_A11 [FMC ADDR]: U5.21(A11) U6.21(A11) ; also sheet 6,18
FMC_A12 [FMC ADDR]: U5.69(A12) U6.69(A12) ; also sheet 6,18
FMC_A14 [FMC ADDR]: U5.22(BA0) U6.22(BA0) ; also sheet 6,18
FMC_A15 [FMC ADDR]: U5.23(BA1) U6.23(BA1) ; also sheet 6,18
FMC_D0 [FMC DATA]: U5.2(DQ0) U6.2(DQ0) ; also sheet 6,18
FMC_D1 [FMC DATA]: U5.4(DQ1) U6.4(DQ1) ; also sheet 6,18
FMC_D2 [FMC DATA]: U5.5(DQ2) U6.5(DQ2) ; also sheet 6,18
FMC_D3 [FMC DATA]: U5.7(DQ3) U6.7(DQ3) ; also sheet 6,18
FMC_D4 [FMC DATA]: U5.8(DQ4) U6.8(DQ4) ; also sheet 6,18
FMC_D5 [FMC DATA]: U5.10(DQ5) U6.10(DQ5) ; also sheet 6,18
FMC_D6 [FMC DATA]: U5.11(DQ6) U6.11(DQ6) ; also sheet 6,18
FMC_D7 [FMC DATA]: U5.13(DQ7) U6.13(DQ7) ; also sheet 6,18
FMC_D8 [FMC DATA]: U5.74(DQ8) U6.74(DQ8) ; also sheet 6,18
FMC_D10 [FMC DATA]: U5.76(DQ9) U5.77(DQ10) U6.76(DQ9) U6.77(DQ10) ; also sheet 6,18
FMC_D11 [FMC DATA]: U5.79(DQ11) U6.79(DQ11) ; also sheet 6,18
FMC_D12 [FMC DATA]: U5.80(DQ12) U6.80(DQ12) ; also sheet 6,18
FMC_D13 [FMC DATA]: U5.82(DQ13) U6.82(DQ13) ; also sheet 6,18
FMC_D14 [FMC DATA]: U5.83(DQ14) U6.83(DQ14) ; also sheet 6,18
FMC_D15 [FMC DATA]: U5.85(DQ15) U6.85(DQ15) ; also sheet 6,18
FMC_D16 [FMC DATA]: U5.31(DQ16) U6.31(DQ16) ; also sheet 6,18
FMC_D17 [FMC DATA]: U5.33(DQ17) U6.33(DQ17) ; also sheet 6,18
FMC_D18 [FMC DATA]: U5.34(DQ18) U6.34(DQ18) ; also sheet 6,18
FMC_D19 [FMC DATA]: U5.36(DQ19) U6.36(DQ19) ; also sheet 6,18
FMC_D20 [FMC DATA]: U5.37(DQ20) U6.37(DQ20) ; also sheet 6,18
FMC_D21 [FMC DATA]: U5.39(DQ21) U6.39(DQ21) ; also sheet 6,18
FMC_D22 [FMC DATA]: U5.40(DQ22) U6.40(DQ22) ; also sheet 6,18
FMC_D23 [FMC DATA]: U5.42(DQ23) U6.42(DQ23) ; also sheet 6,18
FMC_D24 [FMC DATA]: U5.45(DQ24) U6.45(DQ24) ; also sheet 6,18
FMC_D25 [FMC DATA]: U5.47(DQ25) U6.47(DQ25) ; also sheet 6,18
FMC_D26 [FMC DATA]: U5.48(DQ26) U6.48(DQ26) ; also sheet 6,18
FMC_D27 [FMC DATA]: U5.50(DQ27) U6.50(DQ27) ; also sheet 6,18
FMC_D28 [FMC DATA]: U5.51(DQ28) U6.51(DQ28) ; also sheet 6,18
FMC_D29 [FMC DATA]: U5.53(DQ29) U6.53(DQ29) ; also sheet 6,18
FMC_D30 [FMC DATA]: U5.54(DQ30) U6.54(DQ30) ; also sheet 6,18
FMC_D31 [FMC DATA]: U5.56(DQ31) U6.56(DQ31) ; also sheet 6,18
FMC_NBL0: U5.16(DQM0) U6.16(DQM0) ; also sheet 6
FMC_NBL1: U5.71(DQM1) U6.71(DQM1) ; also sheet 6
FMC_NBL2: U5.28(DQM2) U6.28(DQM2) ; also sheet 6
FMC_NBL3: U5.59(DQM3) U6.59(DQM3) ; also sheet 6
FMC_SDCKE0: U5.67(CKE) ; also sheet 6
FMC_SDCKE1: U6.67(CKE) ; also sheet 6
FMC_SDCLK: U5.68(CLK) U6.68(CLK) ; also sheet 6
FMC_SDNCAS: U5.18(!CAS) U6.18(!CAS) ; also sheet 6
FMC_SDNE0: U5.20(!CS) ; also sheet 6
FMC_SDNE1: U6.20(!CS) ; also sheet 6
FMC_SDNRAS: U5.19(!RAS) U6.19(!RAS) ; also sheet 6
FMC_SDNWE: U5.17(!WE) U6.17(!WE) ; also sheet 6
GND [Ground]: C47.2 C48.2 C49.2 C50.2 C51.2 C52.2 C53.2 C54.2 C55.2 C56.2 C57.2 C58.2 C59.2 C60.2 C61.2 C62.2 C63.2 C64.2 C65.2 C66.2 C67.2 C68.2 U5.6(VSSQ) U5.12(VSSQ) U5.32(VSSQ) U5.38(VSSQ) U5.44(VSS) U5.46(VSSQ) U5.52(VSSQ) U5.58(VSS) U5.72(VSS) U5.78(VSSQ) U5.84(VSSQ) U5.86(VSS) U6.6(VSSQ) U6.12(VSSQ) U6.32(VSSQ) U6.38(VSSQ) U6.44(VSS) U6.46(VSSQ) U6.52(VSSQ) U6.58(VSS) U6.72(VSS) U6.78(VSSQ) U6.84(VSSQ) U6.86(VSS) ; also sheet 2,3,4,5,8,9,10,11,12,13,14,15,16,19,20,22,23,24,25,26
VCCO_3V3: C47.1 C48.1 C49.1 C50.1 C51.1 C52.1 C53.1 C54.1 C55.1 C56.1 C57.1 C58.1 C59.1 C60.1 C61.1 C62.1 C63.1 C64.1 C65.1 C66.1 C67.1 C68.1 U5.1(VDD) U5.3(VDDQ) U5.15(VDD) U5.29(VDD) U5.35(VDDQ) U5.41(VDDQ) U5.43(VDD) U5.49(VDDQ) U5.55(VDDQ) U5.75(VDDQ) U5.81(VDDQ) U6.1(VDD) U6.3(VDDQ) U6.15(VDD) U6.29(VDD) U6.35(VDDQ) U6.41(VDDQ) U6.43(VDD) U6.49(VDDQ) U6.55(VDDQ) U6.75(VDDQ) U6.81(VDDQ) ; supply symbol labelled VCC ; also sheet 3,4,5,8,9,10,11,12,14,16,17,18,19,20,21,24

### Buses
FMC_A[0..25]
FMC_D[0..31]

### Notes on the sheet
- 2x512 Mbit SDRAM memory for the ARM
- These packages are TSSOP, but if new packages are to be created
  for layout, BGA package is preferred.
- SDRAM

## Sheet 8 of 26: Keystore memory
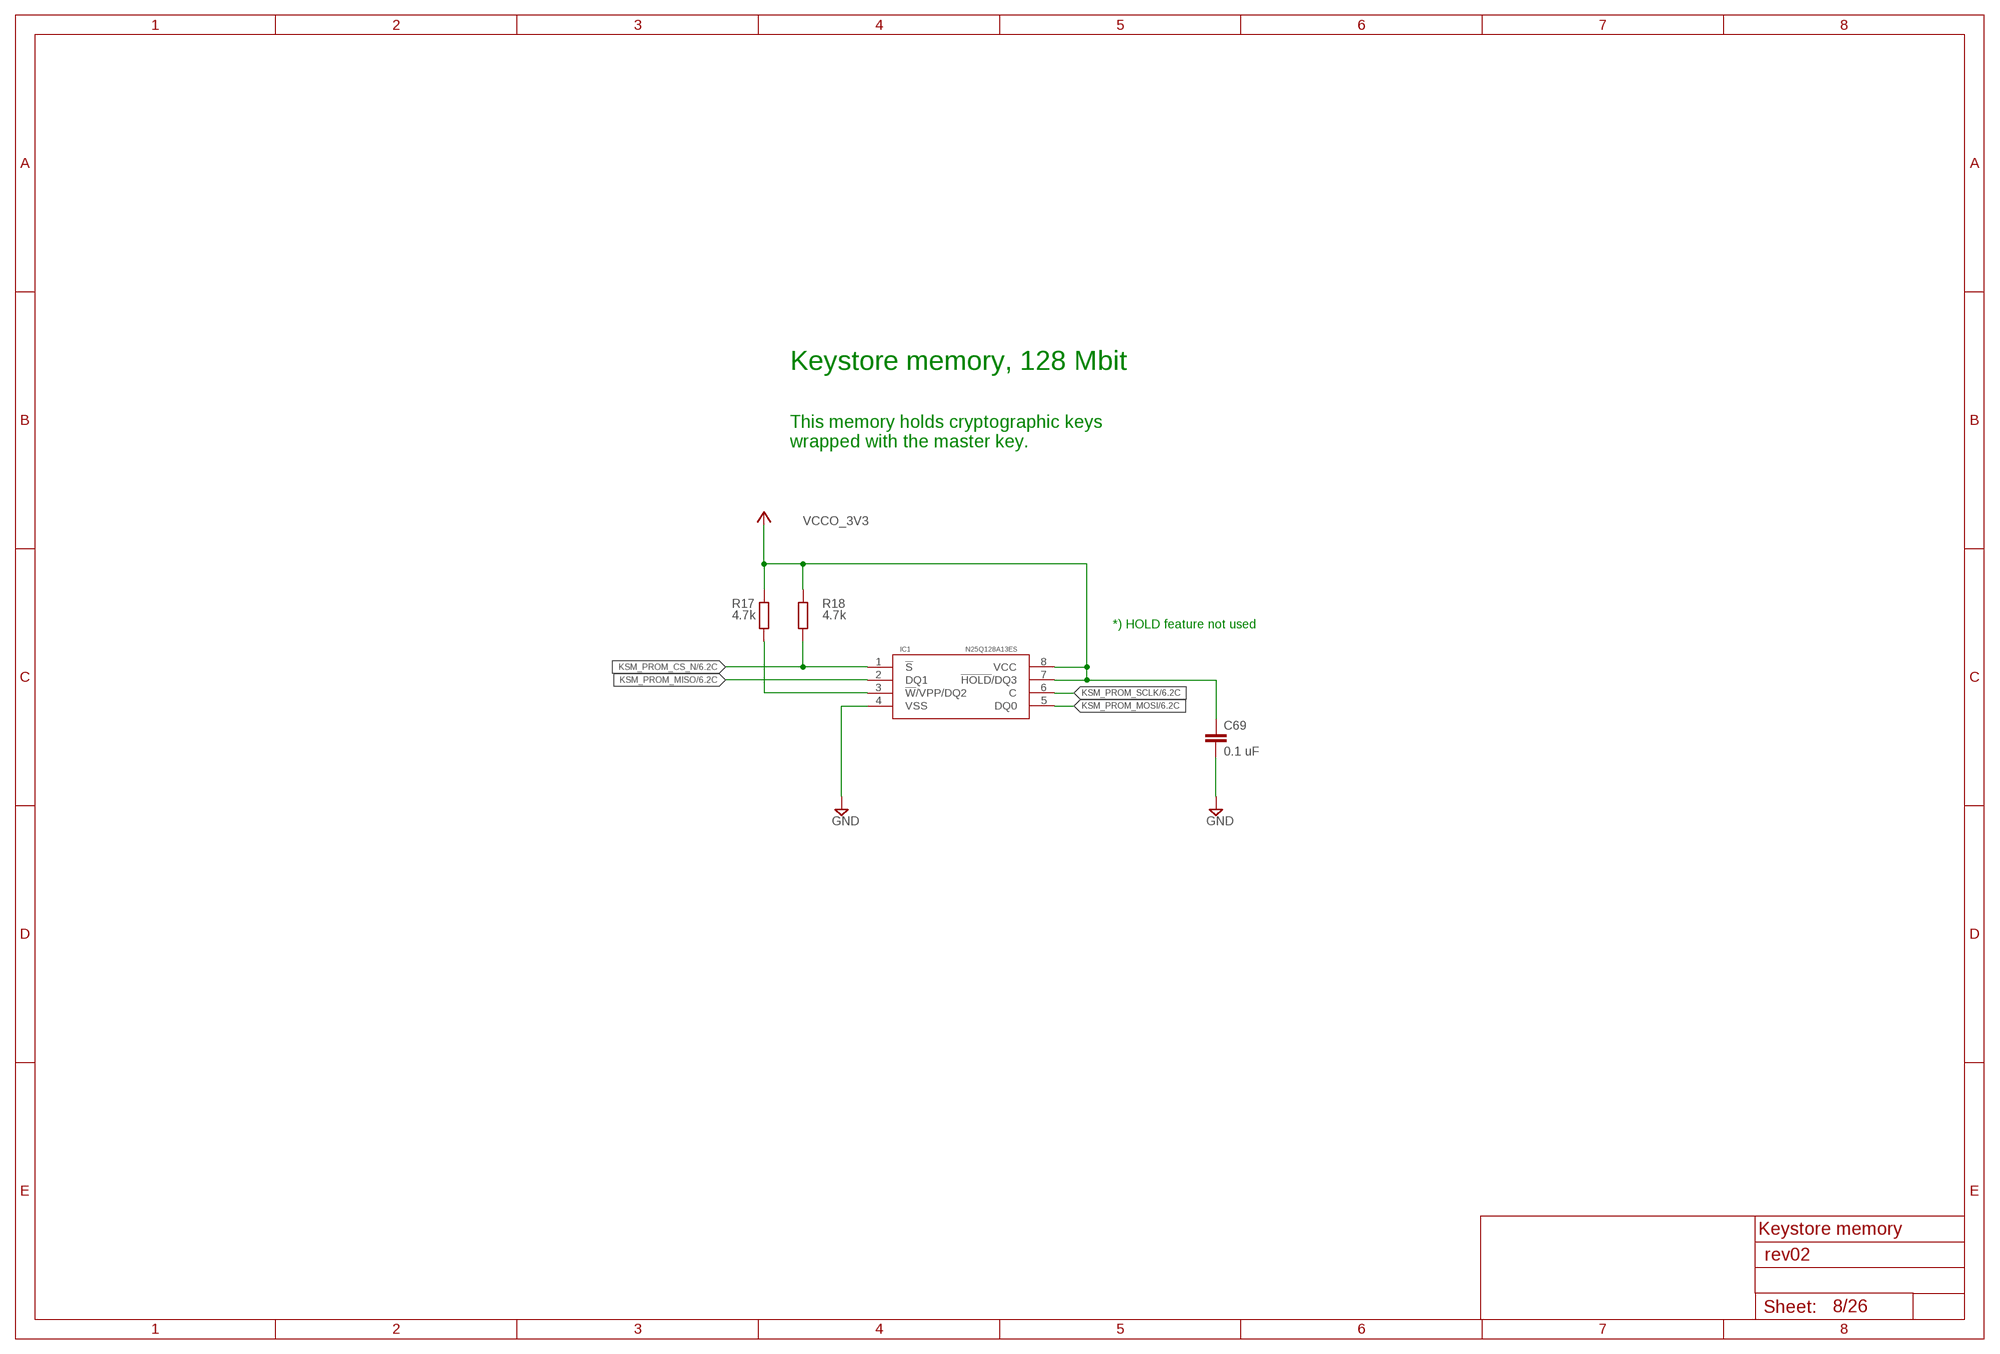
[diagram p7: schematic, sheet 8]

### Parts
C69  0.1 uF  C-EUC0402  [C0402]
IC1  N25Q128A13ES  [SO08]
R17  4.7k  R-EU_R0402  [R0402]
R18  4.7k  R-EU_R0402  [R0402]

### Nets
GND [Ground]: C69.2 IC1.4(VSS) ; also sheet 2,3,4,5,7,9,10,11,12,13,14,15,16,19,20,22,23,24,25,26
KSM_PROM_CS_N: IC1.1(!S) R18.2 ; also sheet 6
KSM_PROM_MISO: IC1.2(DQ1) ; also sheet 6
KSM_PROM_MOSI: IC1.5(DQ0) ; also sheet 6
KSM_PROM_SCLK: IC1.6(C) ; also sheet 6
N$23: IC1.3(!W!/VPP/DQ2) R17.2
VCCO_3V3: C69.1 IC1.7(!HOLD!/DQ3) IC1.8(VCC) R17.1 R18.1 ; supply symbol labelled VCC ; also sheet 3,4,5,7,9,10,11,12,14,16,17,18,19,20,21,24

### Notes on the sheet
- Keystore memory, 128 Mbit
- This memory holds cryptographic keys
  wrapped with the master key.
- *) HOLD feature not used
- Keystore memory

## Sheet 9 of 26: Real Time Clock
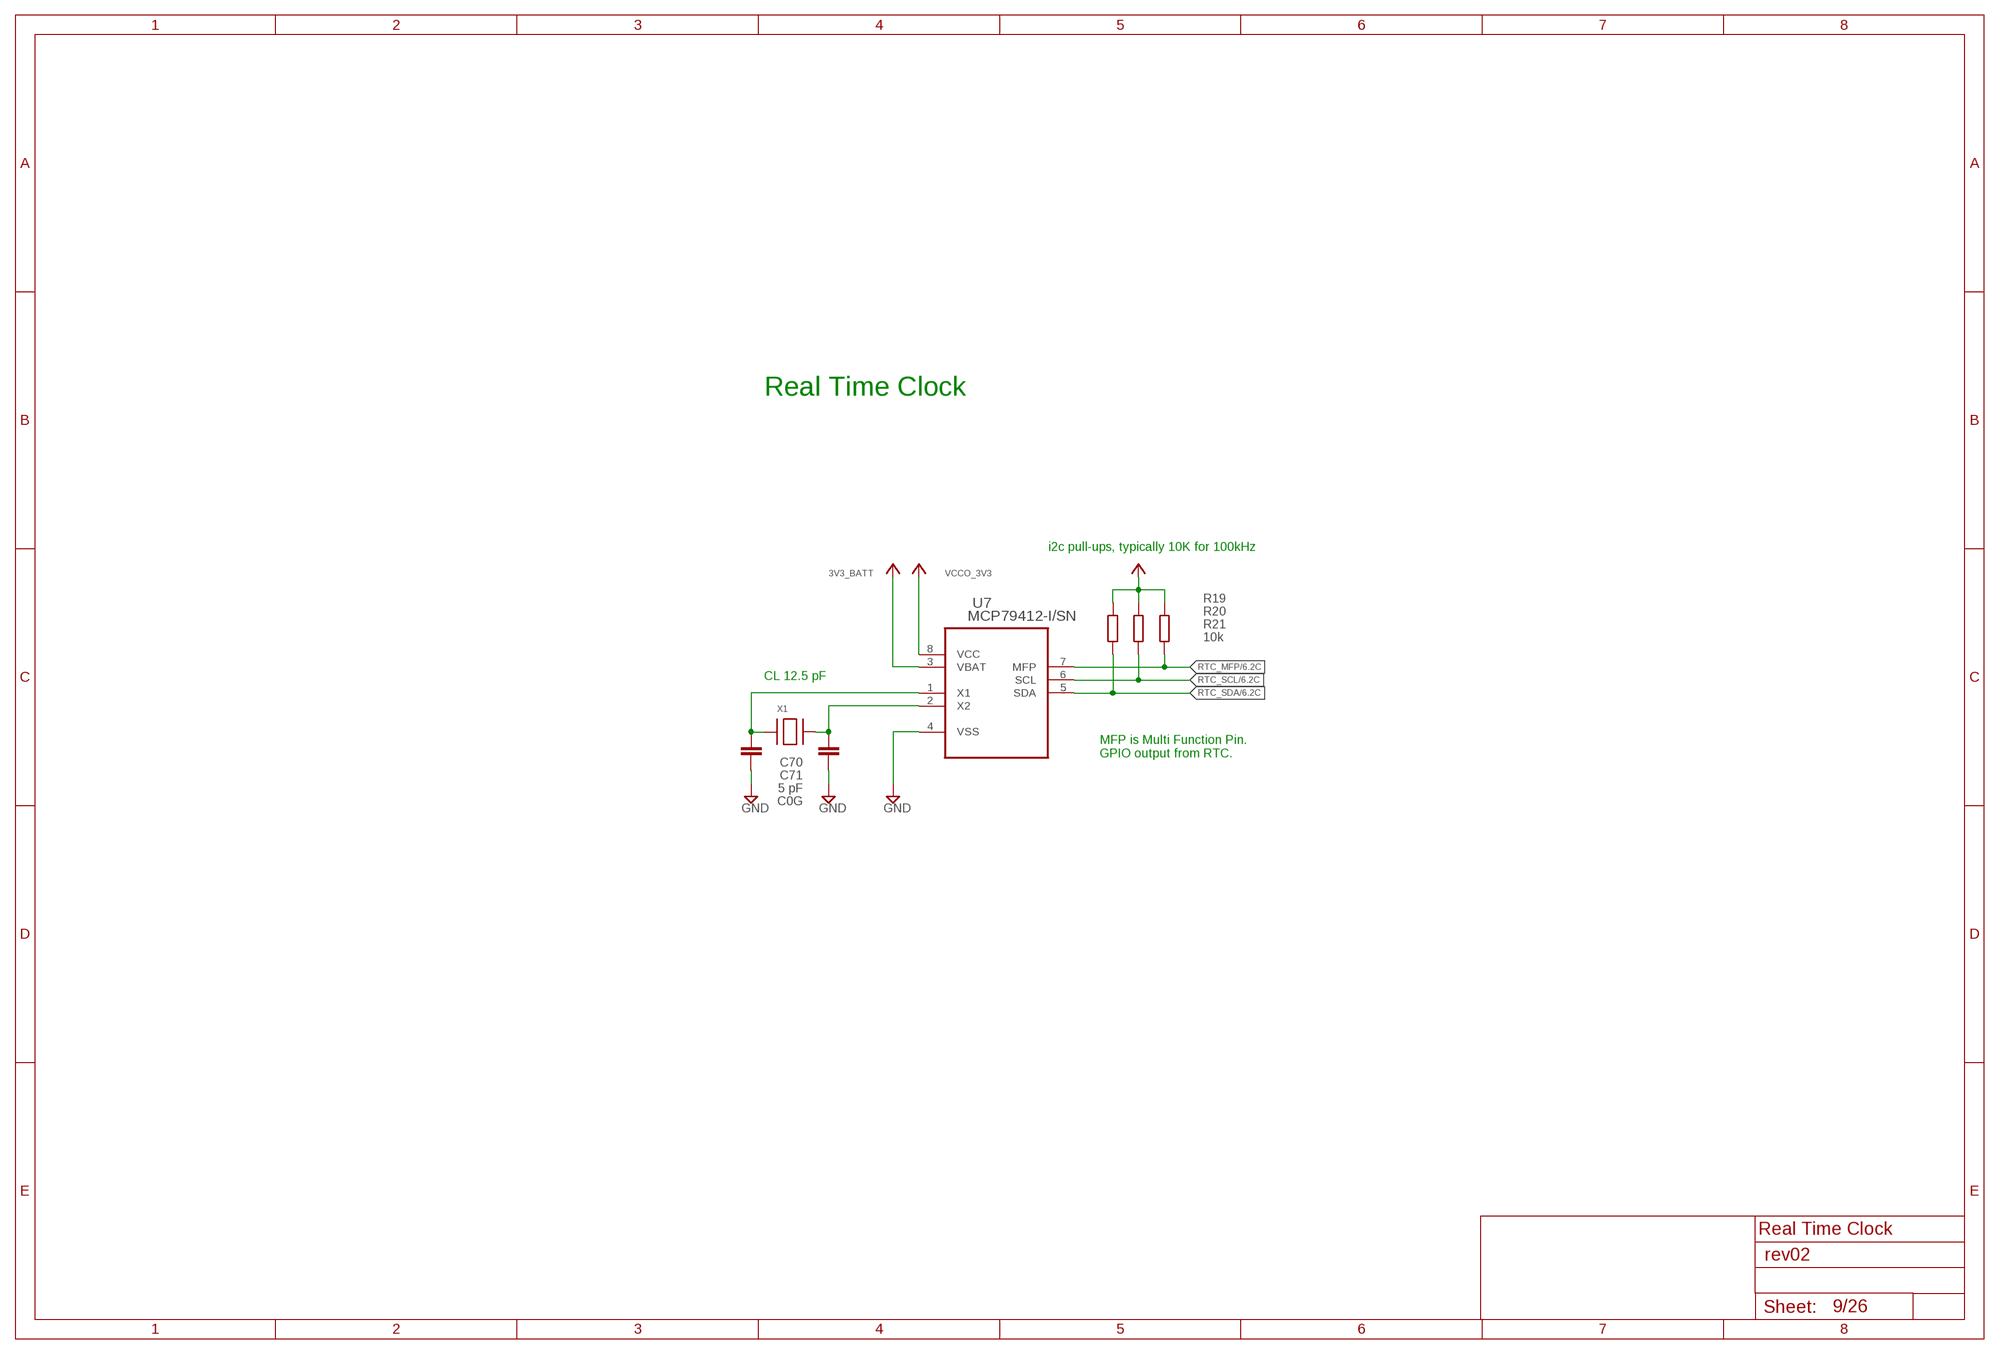
[diagram p8: schematic, sheet 9]

### Parts
C70  5 pF  C-EUC0402  [C0402]
C71  5 pF  C-EUC0402  [C0402]
R19  10k  R-EU_R0402  [R0402]
R20  10k  R-EU_R0402  [R0402]
R21  10k  R-EU_R0402  [R0402]
U7  MCP79412-I/SN  [SOIC127P600X175-8N]
X1  XTAL-3.2X1.5  [XTAL3215]

### Nets
3V3_BATT: U7.3(VBAT) ; supply symbol labelled VCC ; also sheet 5,12,13
GND [Ground]: C70.1 C71.1 U7.4(VSS) ; also sheet 2,3,4,5,7,8,10,11,12,13,14,15,16,19,20,22,23,24,25,26
RTC_MFP: R21.2 U7.7(MFP) ; also sheet 6
RTC_SCL: R20.2 U7.6(SCL) ; also sheet 6
RTC_SDA: R19.2 U7.5(SDA) ; also sheet 6
RTC_X1: C70.2 U7.1(X1) X1.P$1
RTC_X2: C71.2 U7.2(X2) X1.P$2
VCC: R19.1 R20.1 R21.1 ; also sheet 12
VCCO_3V3: U7.8(VCC) ; supply symbol labelled VCC ; also sheet 3,4,5,7,8,10,11,12,14,16,17,18,19,20,21,24

### Notes on the sheet
- Real Time Clock
- i2c pull-ups, typically 10K for 100kHz
- CL 12.5 pF
- MFP is Multi Function Pin.
  GPIO output from RTC.
- Real Time Clock

## Sheet 10 of 26: USB-UART interface
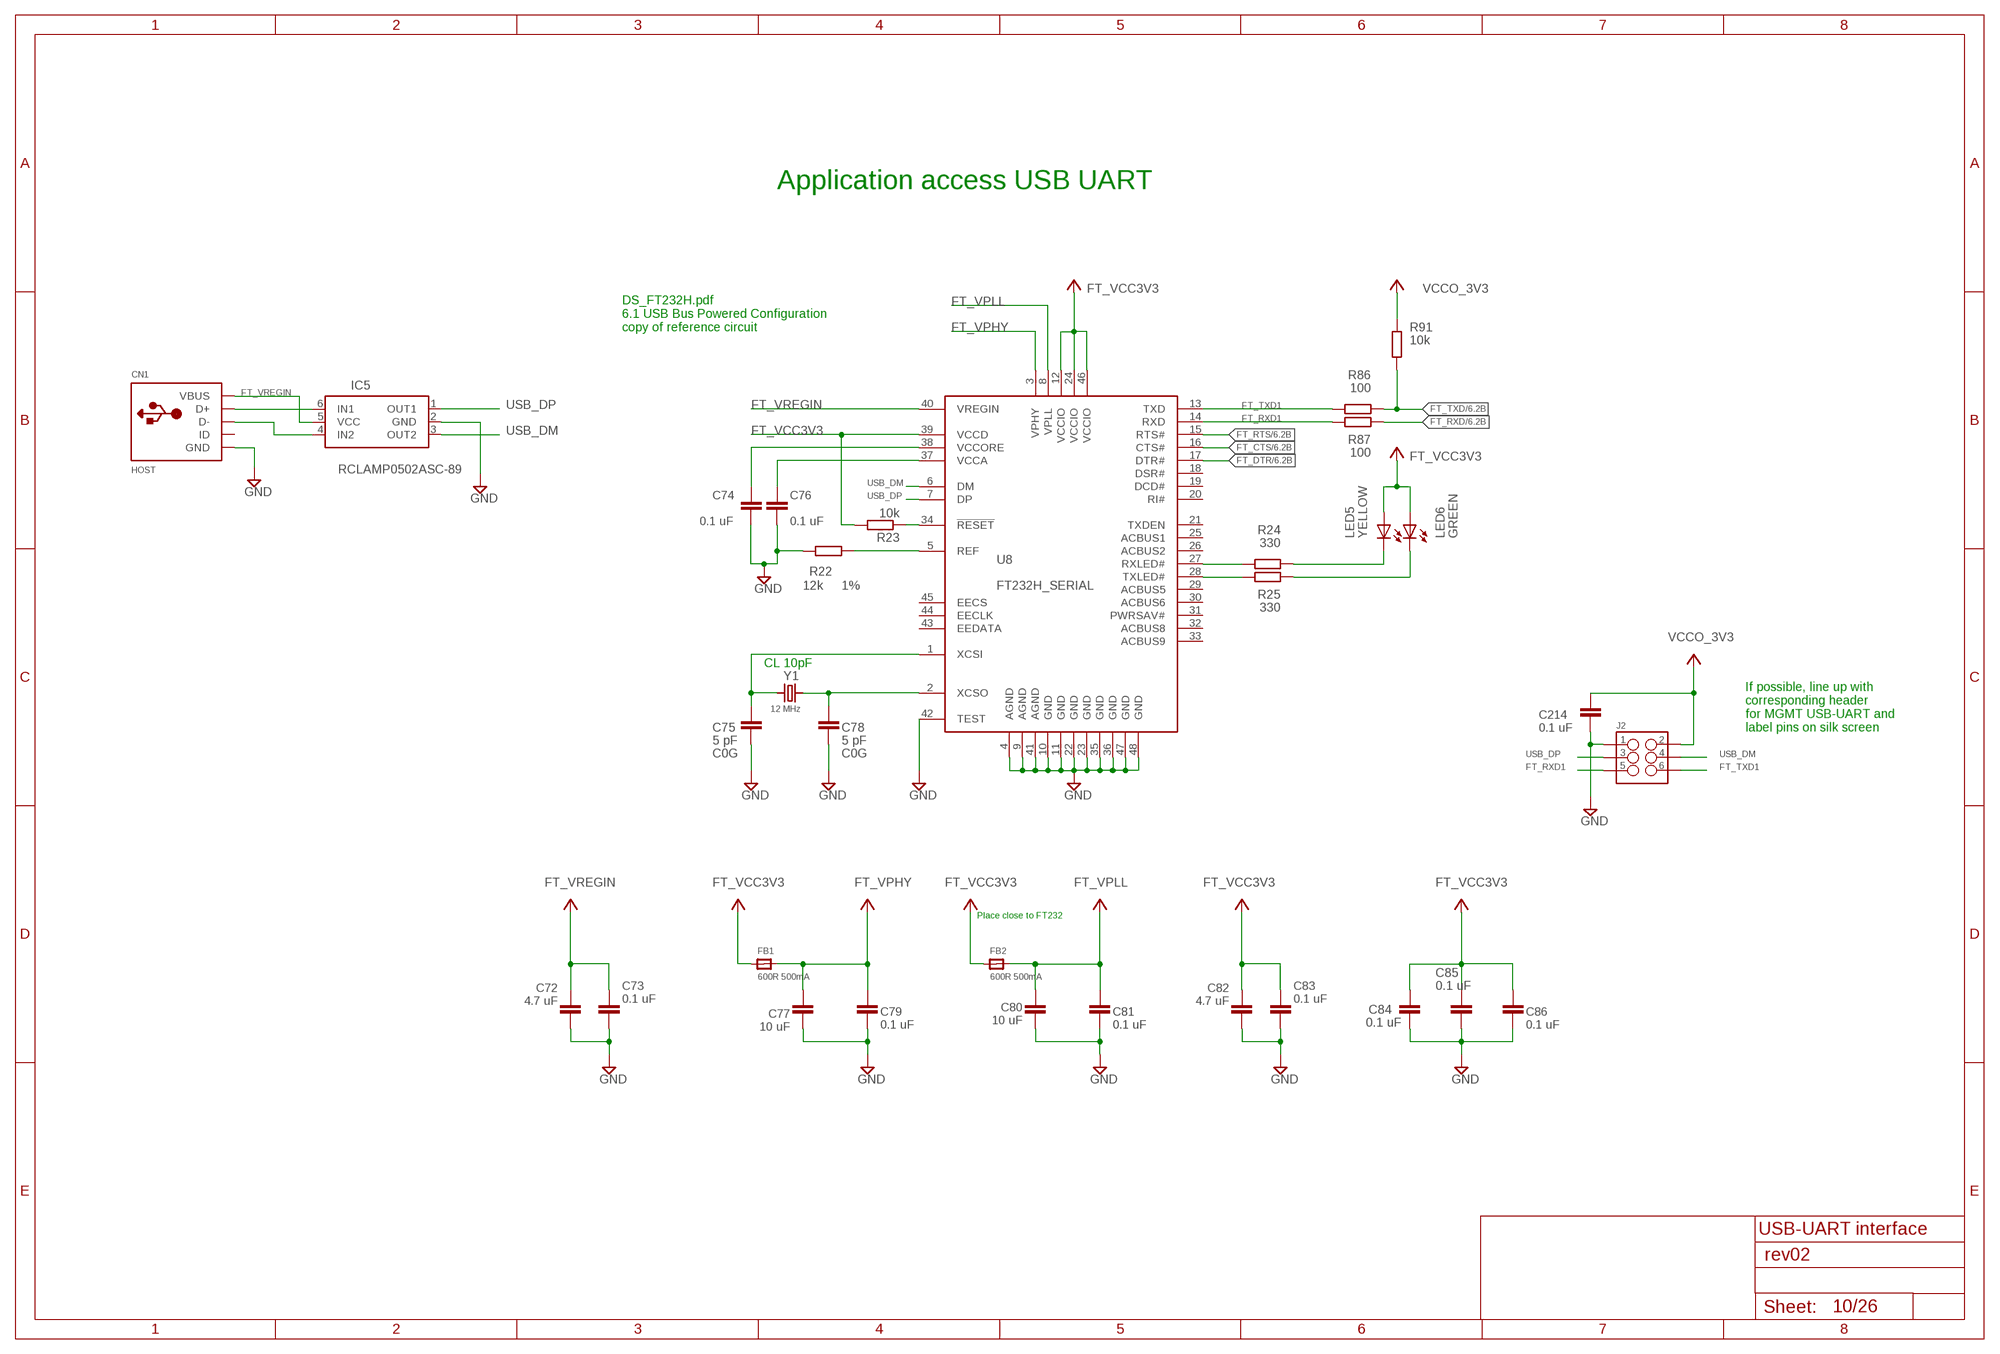
[diagram p9: schematic, sheet 10]

### Parts
C72  4.7 uF  C-EUC0603  [C0603]
C73  0.1 uF  C-EUC0402  [C0402]
C74  0.1 uF  C-EUC0402  [C0402]
C75  5 pF  C-EUC0402  [C0402]
C76  0.1 uF  C-EUC0402  [C0402]
C77  10 uF  C-EUC0805  [C0805]
C78  5 pF  C-EUC0402  [C0402]
C79  0.1 uF  C-EUC0402  [C0402]
C80  10 uF  C-EUC0805  [C0805]
C81  0.1 uF  C-EUC0402  [C0402]
C82  4.7 uF  C-EUC0603  [C0603]
C83  0.1 uF  C-EUC0402  [C0402]
C84  0.1 uF  C-EUC0402  [C0402]
C85  0.1 uF  C-EUC0402  [C0402]
C86  0.1 uF  C-EUC0402  [C0402]
C214  0.1 uF  C-EUC0402  [C0402]
CN1  HOST  USBMINIB  [USB-MINIB]
FB1  600R 500mA  FERRITE_0603MP  [_0603MP]
FB2  600R 500mA  FERRITE_0603MP  [_0603MP]
IC5  RCLAMP0502ASC-89  [RCLAMP0502A]
J2  M03X2NO_SILK  [2X3-NS]
LED5  YELLOW  LEDCHIP-LED0603  [CHIP-LED0603]
LED6  GREEN  LEDCHIP-LED0603  [CHIP-LED0603]
R22  12k  R-EU_R0402  [R0402]
R23  10k  R-EU_R0402  [R0402]
R24  330  R-EU_R0402  [R0402]
R25  330  R-EU_R0402  [R0402]
R86  100  R-EU_R0402  [R0402]
R87  100  R-EU_R0402  [R0402]
R91  10k  R-EU_R0402  [R0402]
U8  FT232H_SERIAL  [FT2323HL_LQFP48]
Y1  12 MHz  CRYSTALTHIN  [CRYSTAL_3.2X2.5]

### Nets
FT_CTS: U8.16(CTS#) ; also sheet 6
FT_DTR: U8.17(DTR#) ; also sheet 6
FT_REF: R22.1 U8.5(REF)
FT_RESET: R23.1 U8.34(!RESET)
FT_RTS: U8.15(RTS#) ; also sheet 6
FT_RXD: R87.1 ; also sheet 6
FT_RXD1: J2.5 R87.2 U8.14(RXD)
FT_RXLED: R24.2 U8.27(RXLED#)
FT_TXD: R86.1 R91.2 ; also sheet 6
FT_TXD1: J2.6 R86.2 U8.13(TXD)
FT_TXLED: R25.2 U8.28(TXLED#)
FT_VCC3V3: C82.1 C83.1 C84.1 C85.1 C86.1 FB1.1 FB2.1 LED5.A LED6.A R23.2 U8.12(VCCIO) U8.24(VCCIO) U8.39(VCCD) U8.46(VCCIO) ; supply symbol labelled VCC
FT_VCCA: C76.1 U8.37(VCCA)
FT_VCCORE: C74.1 U8.38(VCCORE)
FT_VPHY: C77.1 C79.1 FB1.2 U8.3(VPHY) ; supply symbol labelled VCC
FT_VPLL: C80.1 C81.1 FB2.2 U8.8(VPLL) ; supply symbol labelled VCC
FT_VREGIN: C72.1 C73.1 CN1.VBUS IC5.5(VCC) U8.40(VREGIN) ; supply symbol labelled VCC
GND [Ground]: C72.2 C73.2 C74.2 C75.1 C76.2 C77.2 C78.1 C79.2 C80.2 C81.2 C82.2 C83.2 C84.2 C85.2 C86.2 C214.2 CN1.GND IC5.2(GND) J2.1 R22.2 U8.4(AGND) U8.9(AGND) U8.10(GND) U8.11(GND) U8.22(GND) U8.23(GND) U8.35(GND) U8.36(GND) U8.41(AGND) U8.42(TEST) U8.47(GND) U8.48(GND) ; also sheet 2,3,4,5,7,8,9,11,12,13,14,15,16,19,20,22,23,24,25,26
N$13: C75.2 U8.1(XCSI) Y1.1
N$22: C78.2 U8.2(XCSO) Y1.2
N$24: LED5.C R24.1
N$26: LED6.C R25.1
N$57: CN1.D+ IC5.6(IN1)
N$58: CN1.D- IC5.4(IN2)
USB_DM: IC5.3(OUT2) U8.6(DM)
USB_DP: IC5.1(OUT1) U8.7(DP)
VCCO_3V3: C214.1 J2.2 R91.1 ; supply symbol labelled VCC ; also sheet 3,4,5,7,8,9,11,12,14,16,17,18,19,20,21,24
Unconnected: CN1.ID J2.3 J2.4 U8.18(DSR#) U8.19(DCD#) U8.20(RI#) U8.21(TXDEN) U8.25(ACBUS1) U8.26(ACBUS2) U8.29(ACBUS5) U8.30(ACBUS6) U8.31(PWRSAV#) U8.32(ACBUS8) U8.33(ACBUS9) U8.43(EEDATA) U8.44(EECLK) U8.45(EECS)

### Notes on the sheet
- Application access USB UART
- DS_FT232H.pdf
  6.1 USB Bus Powered Configuration
  copy of reference circuit
- CL 10pF
- If possible, line up with
  corresponding header
  for MGMT USB-UART and
  label pins on silk screen
- Place close to FT232
- USB-UART interface

## Sheet 11 of 26: MGMT USB-UART
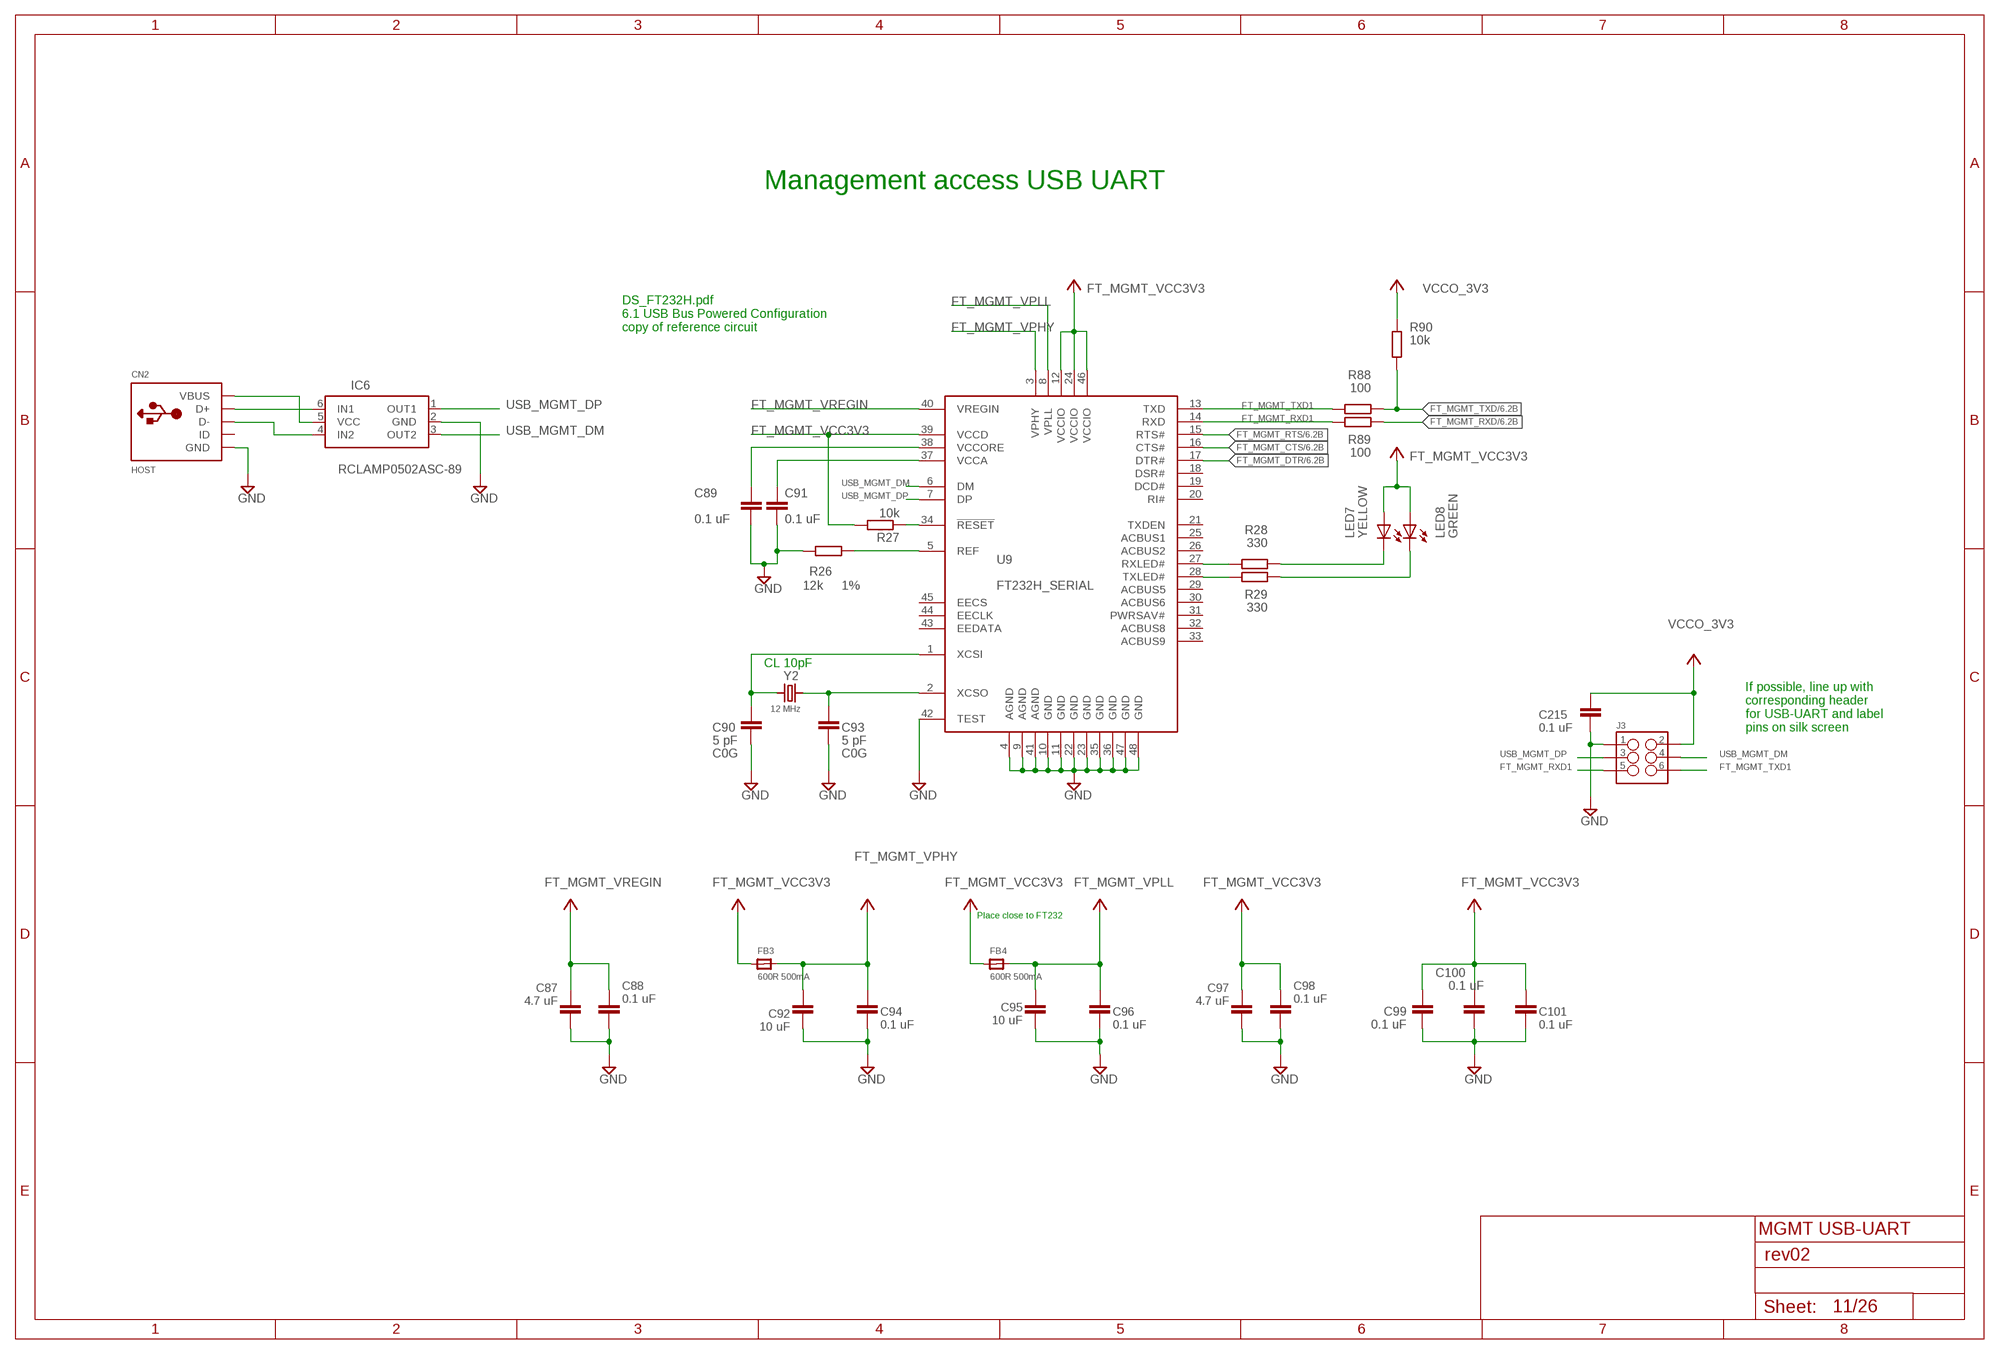
[diagram p10: schematic, sheet 11]

### Parts
C87  4.7 uF  C-EUC0603  [C0603]
C88  0.1 uF  C-EUC0402  [C0402]
C89  0.1 uF  C-EUC0402  [C0402]
C90  5 pF  C-EUC0402  [C0402]
C91  0.1 uF  C-EUC0402  [C0402]
C92  10 uF  C-EUC0805  [C0805]
C93  5 pF  C-EUC0402  [C0402]
C94  0.1 uF  C-EUC0402  [C0402]
C95  10 uF  C-EUC0805  [C0805]
C96  0.1 uF  C-EUC0402  [C0402]
C97  4.7 uF  C-EUC0603  [C0603]
C98  0.1 uF  C-EUC0402  [C0402]
C99  0.1 uF  C-EUC0402  [C0402]
C100  0.1 uF  C-EUC0402  [C0402]
C101  0.1 uF  C-EUC0402  [C0402]
C215  0.1 uF  C-EUC0402  [C0402]
CN2  HOST  USBMINIB  [USB-MINIB]
FB3  600R 500mA  FERRITE_0603MP  [_0603MP]
FB4  600R 500mA  FERRITE_0603MP  [_0603MP]
IC6  RCLAMP0502ASC-89  [RCLAMP0502A]
J3  M03X2NO_SILK  [2X3-NS]
LED7  YELLOW  LEDCHIP-LED0603  [CHIP-LED0603]
LED8  GREEN  LEDCHIP-LED0603  [CHIP-LED0603]
R26  12k  R-EU_R0402  [R0402]
R27  10k  R-EU_R0402  [R0402]
R28  330  R-EU_R0402  [R0402]
R29  330  R-EU_R0402  [R0402]
R88  100  R-EU_R0402  [R0402]
R89  100  R-EU_R0402  [R0402]
R90  10k  R-EU_R0402  [R0402]
U9  FT232H_SERIAL  [FT2323HL_LQFP48]
Y2  12 MHz  CRYSTALTHIN  [CRYSTAL_3.2X2.5]

### Nets
FT_MGMT_CTS: U9.16(CTS#) ; also sheet 6
FT_MGMT_DTR: U9.17(DTR#) ; also sheet 6
FT_MGMT_RTS: U9.15(RTS#) ; also sheet 6
FT_MGMT_RXD: R89.1 ; also sheet 6
FT_MGMT_RXD1: J3.5 R89.2
FT_MGMT_TXD: R88.1 R90.2 ; also sheet 6
FT_MGMT_TXD1: J3.6 R88.2
FT_MGMT_VCC3V3: C97.1 C98.1 C99.1 C100.1 C101.1 FB3.1 FB4.1 LED7.A LED8.A R27.2 U9.12(VCCIO) U9.24(VCCIO) U9.39(VCCD) U9.46(VCCIO) ; supply symbol labelled VCC
FT_MGMT_VPHY: C92.1 C94.1 FB3.2 U9.3(VPHY) ; supply symbol labelled VCC
FT_MGMT_VPLL: C95.1 C96.1 FB4.2 U9.8(VPLL) ; supply symbol labelled VCC
FT_MGMT_VREGIN: C87.1 C88.1 CN2.VBUS IC6.5(VCC) U9.40(VREGIN) ; supply symbol labelled VCC
FT_REF1: R26.1 U9.5(REF)
FT_RESET1: R27.1 U9.34(!RESET)
FT_RXLED1: R28.2 U9.27(RXLED#)
FT_TXLED1: R29.2 U9.28(TXLED#)
FT_VCCA1: C91.1 U9.37(VCCA)
FT_VCCORE1: C89.1 U9.38(VCCORE)
GND [Ground]: C87.2 C88.2 C89.2 C90.1 C91.2 C92.2 C93.1 C94.2 C95.2 C96.2 C97.2 C98.2 C99.2 C100.2 C101.2 C215.2 CN2.GND IC6.2(GND) J3.1 R26.2 U9.4(AGND) U9.9(AGND) U9.10(GND) U9.11(GND) U9.22(GND) U9.23(GND) U9.35(GND) U9.36(GND) U9.41(AGND) U9.42(TEST) U9.47(GND) U9.48(GND) ; also sheet 2,3,4,5,7,8,9,10,12,13,14,15,16,19,20,22,23,24,25,26
N$6: LED7.C R28.1
N$7: LED8.C R29.1
N$8: C93.2 U9.2(XCSO) Y2.2
N$9: C90.2 U9.1(XCSI) Y2.1
N$59: CN2.D+ IC6.6(IN1)
N$60: CN2.D- IC6.4(IN2)
USB_MGMT_DM: IC6.3(OUT2) J3.4 U9.6(DM)
USB_MGMT_DP: IC6.1(OUT1) J3.3 U9.7(DP)
VCCO_3V3: C215.1 J3.2 R90.1 ; supply symbol labelled VCC ; also sheet 3,4,5,7,8,9,10,12,14,16,17,18,19,20,21,24
Unconnected: CN2.ID U9.13(TXD) U9.14(RXD) U9.18(DSR#) U9.19(DCD#) U9.20(RI#) U9.21(TXDEN) U9.25(ACBUS1) U9.26(ACBUS2) U9.29(ACBUS5) U9.30(ACBUS6) U9.31(PWRSAV#) U9.32(ACBUS8) U9.33(ACBUS9) U9.43(EEDATA) U9.44(EECLK) U9.45(EECS)

### Notes on the sheet
- Management access USB UART
- DS_FT232H.pdf
  6.1 USB Bus Powered Configuration
  copy of reference circuit
- CL 10pF
- If possible, line up with
  corresponding header
  for USB-UART and label
  pins on silk screen
- Place close to FT232
- MGMT USB-UART

## Sheet 12 of 26: AVR Tamper circuit
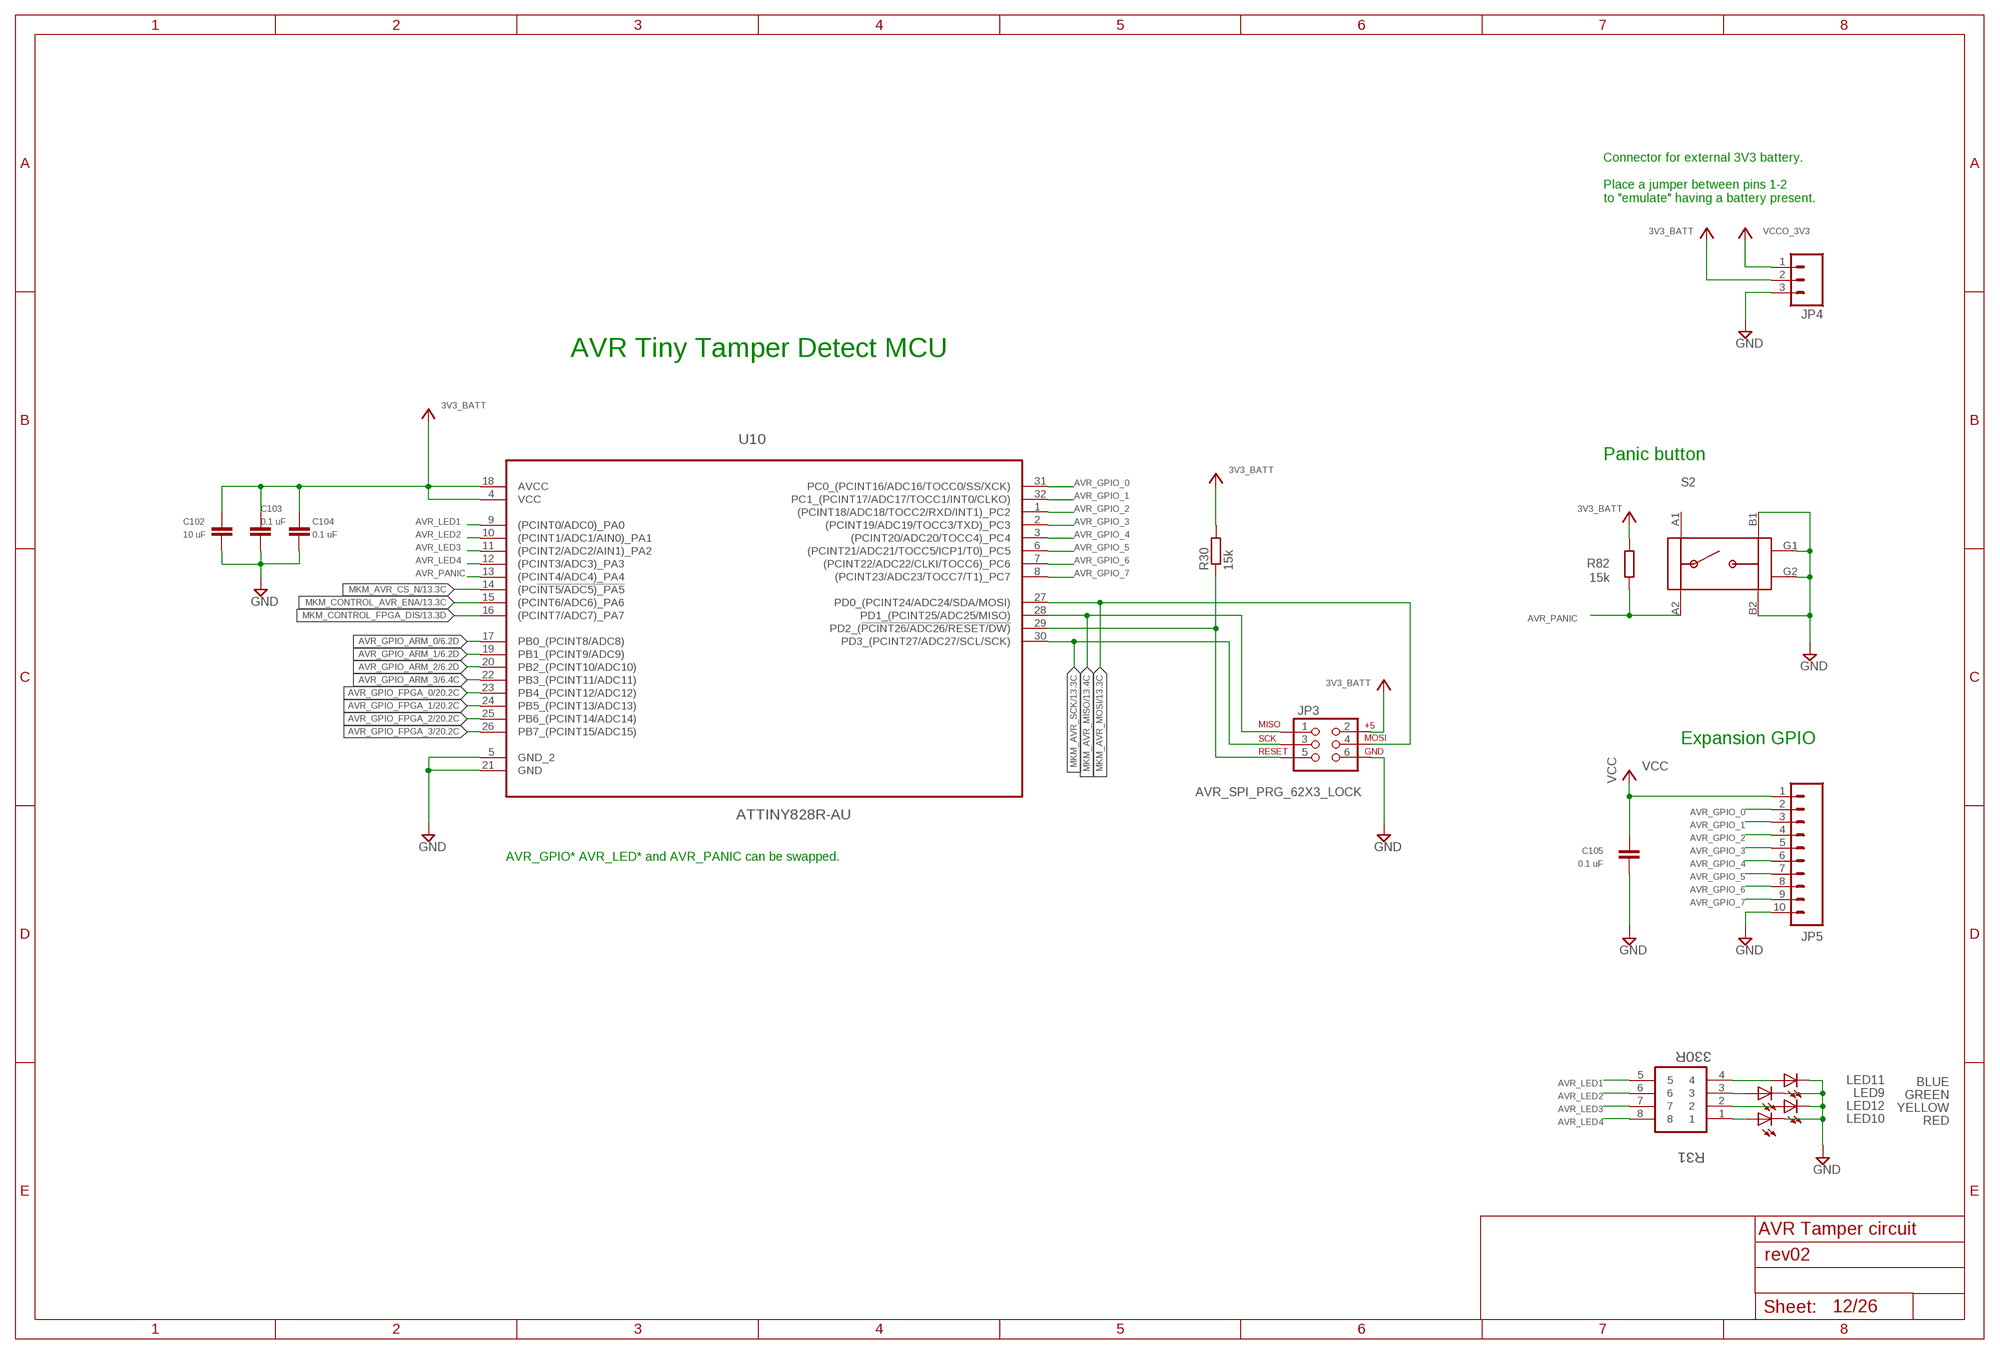
[diagram p11: schematic, sheet 12]

### Parts
C102  10 uF  C-EUC0805  [C0805]
C103  0.1 uF  C-EUC0402  [C0402]
C104  0.1 uF  C-EUC0402  [C0402]
C105  0.1 uF  C-EUC0402  [C0402]
JP3  AVR_SPI_PRG_62X3_LOCK  [2X3_LOCK]
JP4  M03LOCK  [1X03_LOCK]
JP5  M10LOCK  [1X10_LOCK]
LED9  GREEN  LEDCHIP-LED0603  [CHIP-LED0603]
LED10  RED  LEDCHIP-LED0603  [CHIP-LED0603]
LED11  BLUE  LEDCHIP-LED0603  [CHIP-LED0603]
LED12  YELLOW  LEDCHIP-LED0603  [CHIP-LED0603]
R30  15k  R-EU_R0402  [R0402]
R31  330R  EXB38V331JV  [RESCAXE80P320X160X60-8N]
R82  15k  R-EU_R0402  [R0402]
S2  TACTILE_SWITCH  [TACTILE_SWITCH]
U10  ATTINY828R-AU  [QFP80P900X900X120-32N]

### Nets
3V3_BATT: C102.1 C103.1 C104.1 JP3.2 JP4.2 R30.2 R82.2 U10.4(VCC) U10.18(AVCC) ; supply symbol labelled VCC ; also sheet 5,9,13
AVR_GPIO_0: JP5.2 U10.31(PC0_(PCINT16/ADC16/TOCC0/SS/XCK))
AVR_GPIO_1: JP5.3 U10.32(PC1_(PCINT17/ADC17/TOCC1/INT0/CLKO))
AVR_GPIO_2: JP5.4 U10.1((PCINT18/ADC18/TOCC2/RXD/INT1)_PC2)
AVR_GPIO_3: JP5.5 U10.2((PCINT19/ADC19/TOCC3/TXD)_PC3)
AVR_GPIO_4: JP5.6 U10.3((PCINT20/ADC20/TOCC4)_PC4)
AVR_GPIO_5: JP5.7 U10.6((PCINT21/ADC21/TOCC5/ICP1/T0)_PC5)
AVR_GPIO_6: JP5.8 U10.7((PCINT22/ADC22/CLKI/TOCC6)_PC6)
AVR_GPIO_7: JP5.9 U10.8((PCINT23/ADC23/TOCC7/T1)_PC7)
AVR_GPIO_ARM_0: U10.17(PB0_(PCINT8/ADC8)) ; also sheet 6
AVR_GPIO_ARM_1: U10.19(PB1_(PCINT9/ADC9)) ; also sheet 6
AVR_GPIO_FPGA_2: U10.25(PB6_(PCINT14/ADC14)) ; also sheet 20
AVR_GPIO_FPGA_3: U10.26(PB7_(PCINT15/ADC15)) ; also sheet 20
AVR_LED1: R31.5 U10.9((PCINT0/ADC0)_PA0)
AVR_LED2: R31.6 U10.10((PCINT1/ADC1/AIN0)_PA1)
AVR_LED3: R31.7 U10.11((PCINT2/ADC2/AIN1)_PA2)
AVR_LED4: R31.8 U10.12((PCINT3/ADC3)_PA3)
AVR_PANIC: R82.1 S2.A2
AVR_RESET: JP3.5 R30.1 U10.29(PD2_(!PCINT26/ADC26/RESET/DW))
GND [Ground]: C102.2 C103.2 C104.2 C105.2 JP3.6 JP4.3 JP5.10 LED9.C LED10.C LED11.C LED12.C S2.B1 S2.B2 S2.G1 S2.G2 U10.5(GND_2) U10.21(GND) ; also sheet 2,3,4,5,7,8,9,10,11,13,14,15,16,19,20,22,23,24,25,26
MKM_AVR_CS_N: U10.14((PC!INT5/ADC5)_PA5) ; also sheet 13
MKM_AVR_MISO: JP3.1 U10.28(PD1_(PCINT25/ADC25/MISO)) ; also sheet 13
MKM_AVR_MOSI: JP3.4 U10.27(PD0_(PCINT24/ADC24/SDA/MOSI)) ; also sheet 13
MKM_AVR_SCK: JP3.3 U10.30(PD3_(PCINT27/ADC27/SCL/SCK)) ; also sheet 13
MKM_CONTROL_AVR_ENA: U10.15((PCINT6/ADC6)_PA6) ; also sheet 13
N$4: LED11.A R31.4
N$5: LED9.A R31.3
N$15: LED12.A R31.2
N$16: LED10.A R31.1
VCC: C105.1 JP5.1 ; also sheet 9
VCCO_3V3: JP4.1 ; supply symbol labelled VCC ; also sheet 3,4,5,7,8,9,10,11,14,16,17,18,19,20,21,24
Unconnected: S2.A1 U10.13((PCINT4/ADC4)_PA4) U10.16((PCINT7/ADC7)_PA7) U10.20(PB2_(PCINT10/ADC10)) U10.22(PB3_(PCINT11/ADC11)) U10.23(PB4_(PCINT12/ADC12)) U10.24(PB5_(PCINT13/ADC13))

### Notes on the sheet
- Connector for external 3V3 battery.
  
  Place a jumper between pins 1-2
  to "emulate" having a battery present.
- AVR Tiny Tamper Detect MCU
- Panic button
- Expansion GPIO
- AVR_GPIO* AVR_LED* and AVR_PANIC can be swapped.
- AVR Tamper circuit

## Sheet 13 of 26: Master Key Memory
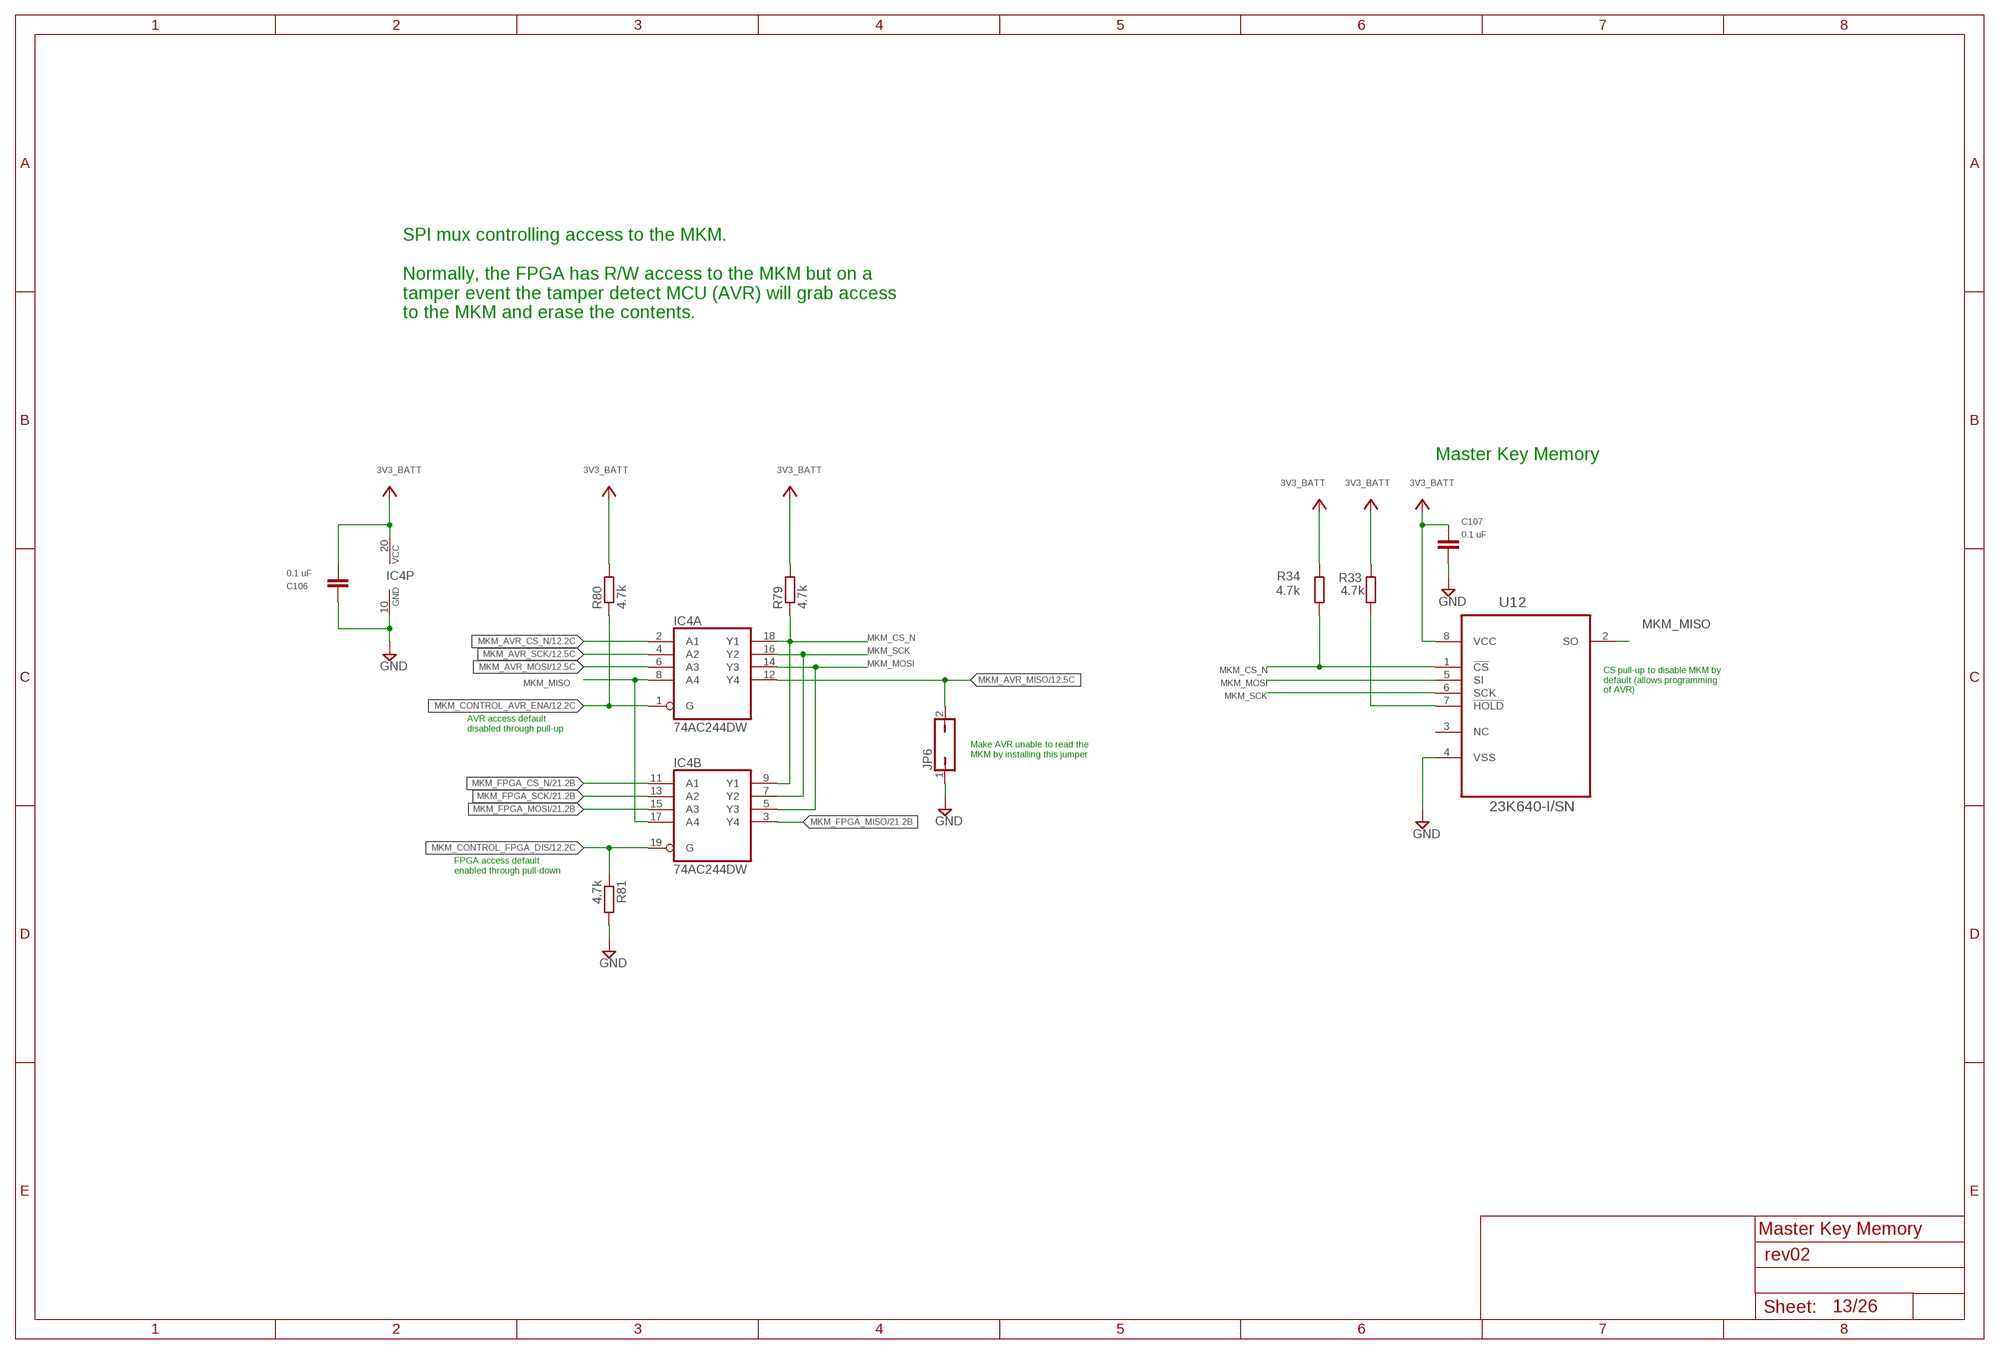
[diagram p12: schematic, sheet 13]

### Parts
C106  0.1 uF  C-EUC0402  [C0402]
C107  0.1 uF  C-EUC0402  [C0402]
IC4  74AC244DW  [SO20W]
JP6  JP1Q  [JP1]
R33  4.7k  R-EU_R0402  [R0402]
R34  4.7k  R-EU_R0402  [R0402]
R79  4.7k  R-EU_R0402  [R0402]
R80  4.7k  R-EU_R0402  [R0402]
R81  4.7k  R-EU_R0402  [R0402]
U12  23K640-I/SN  [SOIC127P600X175-8N]

### Nets
3V3_BATT: C106.1 C107.1 IC4.20(P:VCC) R33.1 R34.2 R79.2 R80.2 U12.8(VCC) ; supply symbol labelled VCC ; also sheet 5,9,12
GND [Ground]: C106.2 C107.2 IC4.10(P:GND) JP6.1 R81.2 U12.4(VSS) ; also sheet 2,3,4,5,7,8,9,10,11,12,14,15,16,19,20,22,23,24,25,26
MKM_AVR_CS_N: IC4.2(A:A1) ; also sheet 12
MKM_AVR_MISO: IC4.12(A:Y4) JP6.2 ; also sheet 12
MKM_AVR_MOSI: IC4.6(A:A3) ; also sheet 12
MKM_AVR_SCK: IC4.4(A:A2) ; also sheet 12
MKM_CONTROL_AVR_ENA: IC4.1(A:G) R80.1 ; also sheet 12
MKM_CONTROL_FPGA_DIS: IC4.19(B:G) R81.1 ; also sheet 12
MKM_CS_N: IC4.9(B:Y1) IC4.18(A:Y1) R34.1 R79.1 U12.1(!CS)
MKM_FPGA_CS_N: IC4.11(B:A1) ; also sheet 21
MKM_FPGA_MISO: IC4.3(B:Y4) ; also sheet 21
MKM_FPGA_MOSI: IC4.15(B:A3) ; also sheet 21
MKM_FPGA_SCK: IC4.13(B:A2) ; also sheet 21
MKM_MISO: IC4.8(A:A4) IC4.17(B:A4) U12.2(SO)
MKM_MOSI: IC4.5(B:Y3) IC4.14(A:Y3) U12.5(SI)
MKM_SCK: IC4.7(B:Y2) IC4.16(A:Y2) U12.6(SCK)
N$31: R33.2 U12.7(!HOLD)
Unconnected: U12.3(NC)

### Notes on the sheet
- SPI mux controlling access to the MKM.
  
  Normally, the FPGA has R/W access to the MKM but on a
  tamper event the tamper detect MCU (AVR) will grab access
  to the MKM and erase the contents.
- Master Key Memory
- CS pull-up to disable MKM by
  default (allows programming
  of AVR)
- AVR access default
  disabled through pull-up
- Make AVR unable to read the
  MKM by installing this jumper
- FPGA access default
  enabled through pull-down
- Master Key Memory

## Sheet 14 of 26: FPGA configuration interface
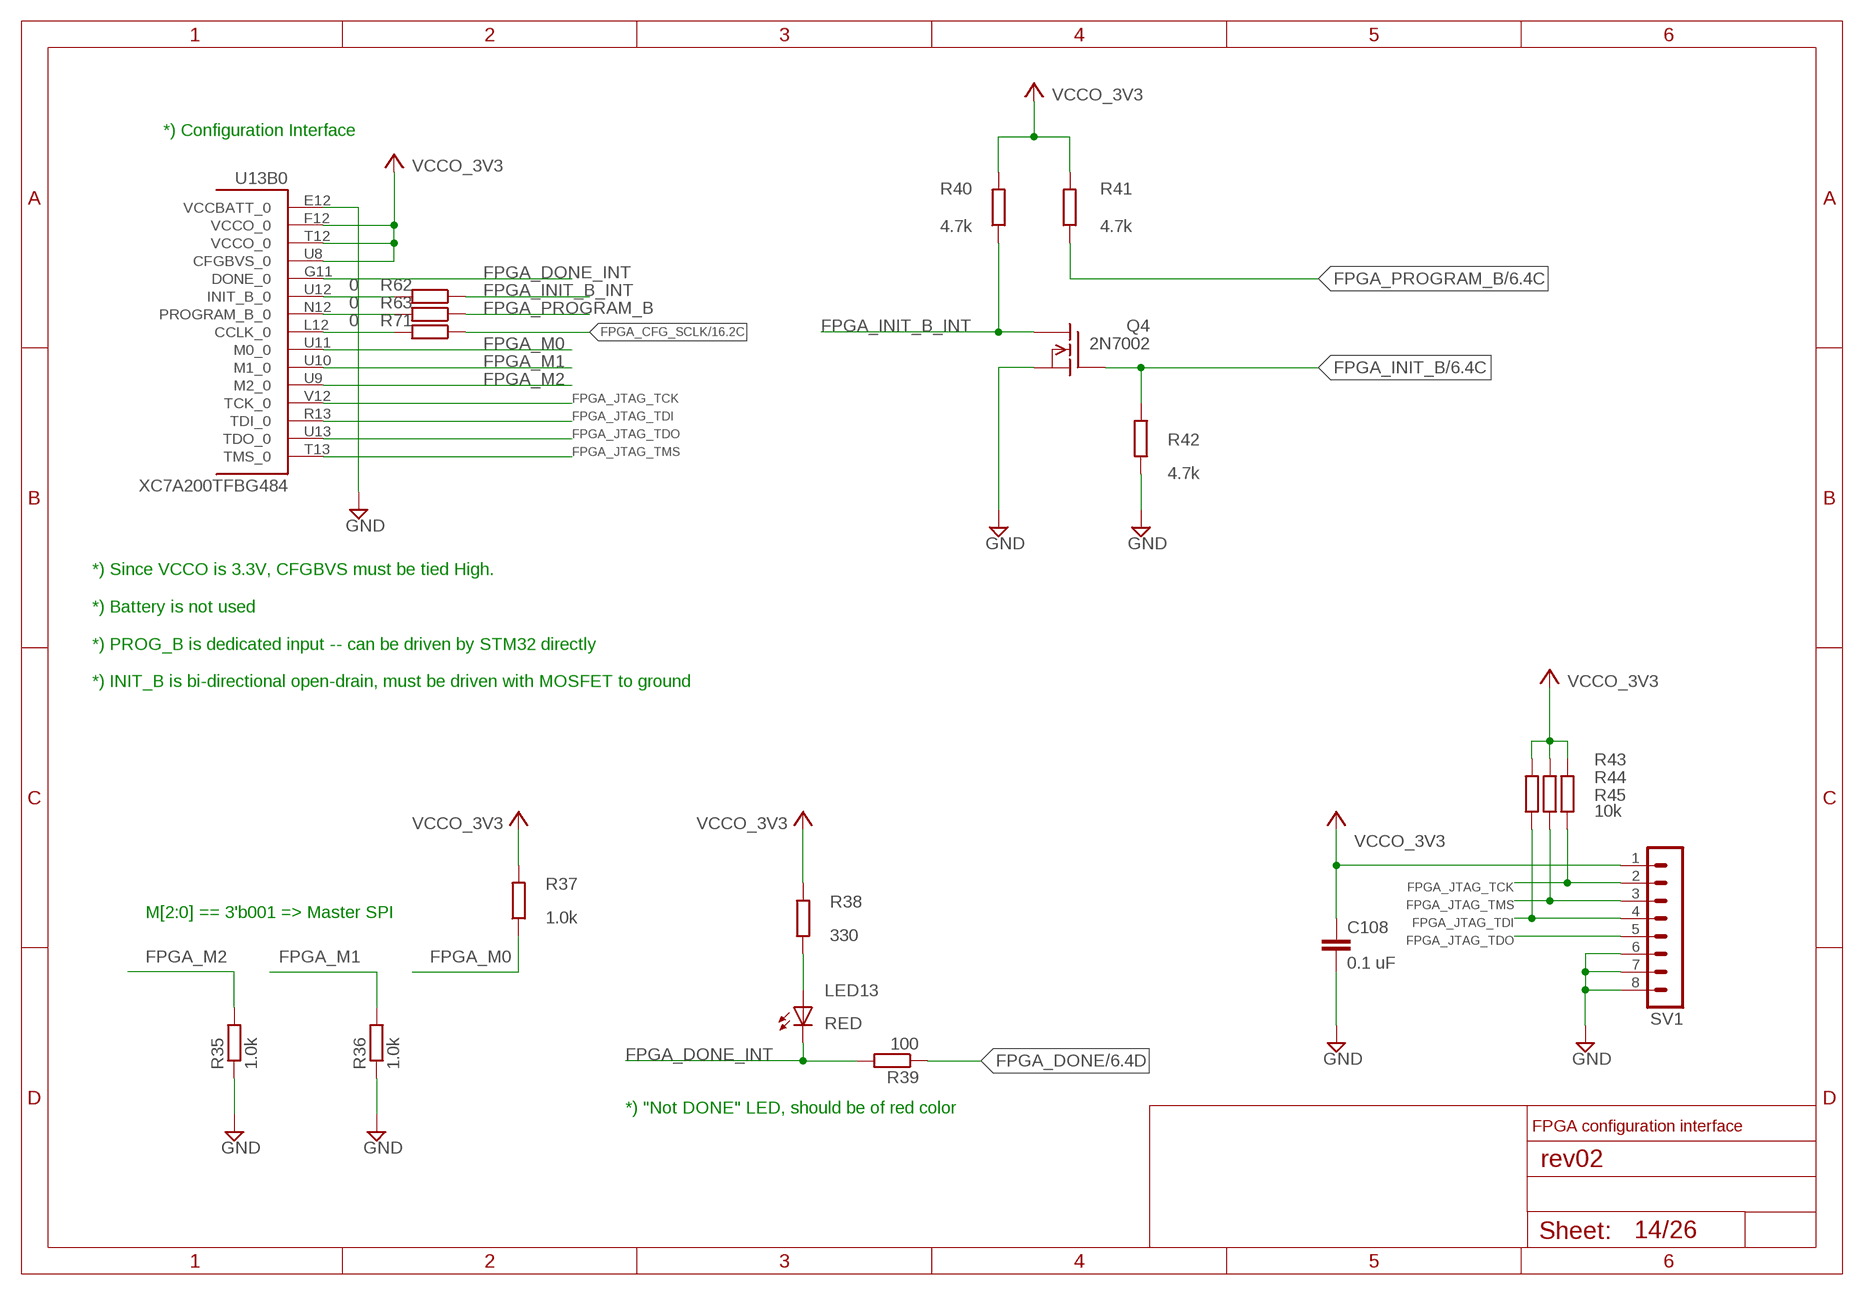
[diagram p13: schematic, sheet 14]

### Parts
C108  0.1 uF  C-EUC0402  [C0402]
LED13  RED  LEDCHIP-LED0603  [CHIP-LED0603]
Q4  2N7002  [SOT23]
R35  1.0k  R-EU_R0402  [R0402]
R36  1.0k  R-EU_R0402  [R0402]
R37  1.0k  R-EU_R0402  [R0402]
R38  330  R-EU_R0402  [R0402]
R39  100  R-EU_R0402  [R0402]
R40  4.7k  R-EU_R0402  [R0402]
R41  4.7k  R-EU_R0402  [R0402]
R42  4.7k  R-EU_R0402  [R0402]
R43  10k  R-EU_R0402  [R0402]
R44  10k  R-EU_R0402  [R0402]
R45  10k  R-EU_R0402  [R0402]
R62  0  R-EU_R0603  [R0603]
R63  0  R-EU_R0603  [R0603]
R71  0  R-EU_R0603  [R0603]
SV1  MA08-1  [MA08-1]
U13  XC7A200TFBG484  [FF484]

### Nets
FPGA_CFG_SCLK: R71.1 ; also sheet 16
FPGA_CFG_SCLK1: R71.2 U13.L12(B0:CCLK_0)
FPGA_DONE: R39.1 ; also sheet 6
FPGA_DONE_INT: LED13.C R39.2 U13.G11(B0:DONE_0)
FPGA_INIT_B: Q4.1(G) R42.2 ; also sheet 6
FPGA_INIT_B_INT: Q4.3(D) R40.1 R62.1
FPGA_INIT_B_INT1: R62.2 U13.U12(B0:INIT_B_0)
FPGA_JTAG_TCK: R45.1 SV1.2 U13.V12(B0:TCK_0)
FPGA_JTAG_TDI: R43.1 SV1.4 U13.R13(B0:TDI_0)
FPGA_JTAG_TDO: SV1.5 U13.U13(B0:TDO_0)
FPGA_JTAG_TMS: R44.1 SV1.3 U13.T13(B0:TMS_0)
FPGA_M0: R37.1 U13.U11(B0:M0_0)
FPGA_M1: R36.2 U13.U10(B0:M1_0)
FPGA_M2: R35.2 U13.U9(B0:M2_0)
FPGA_PROGRAM_B: R41.1 R63.1 ; also sheet 6
FPGA_PROGRAM_B1: R63.2 U13.N12(B0:PROGRAM_B_0)
GND [Ground]: C108.2 Q4.2(S) R35.1 R36.1 R42.1 SV1.6 SV1.7 SV1.8 U13.E12(B0:VCCBATT_0) ; also sheet 2,3,4,5,7,8,9,10,11,12,13,15,16,19,20,22,23,24,25,26
N$34: LED13.A R38.1
VCCO_3V3: C108.1 R37.2 R38.2 R40.2 R41.2 R43.2 R44.2 R45.2 SV1.1 U13.F12(B0:VCCO_0) U13.T12(B0:VCCO_0) U13.U8(B0:CFGBVS_0) ; supply symbol labelled VCC ; also sheet 3,4,5,7,8,9,10,11,12,16,17,18,19,20,21,24

### Notes on the sheet
- *) Configuration Interface
- *) Since VCCO is 3.3V, CFGBVS must be tied High.
  
  *) Battery is not used
  
  *) PROG_B is dedicated input -- can be driven by STM32 directly
  
  *) INIT_B is bi-directional open-drain, must be driven with MOSFET to ground
- M[2:0] == 3'b001 => Master SPI
- *) "Not DONE" LED, should be of red color
- FPGA configuration interface

## Sheet 15 of 26: FPGA unused
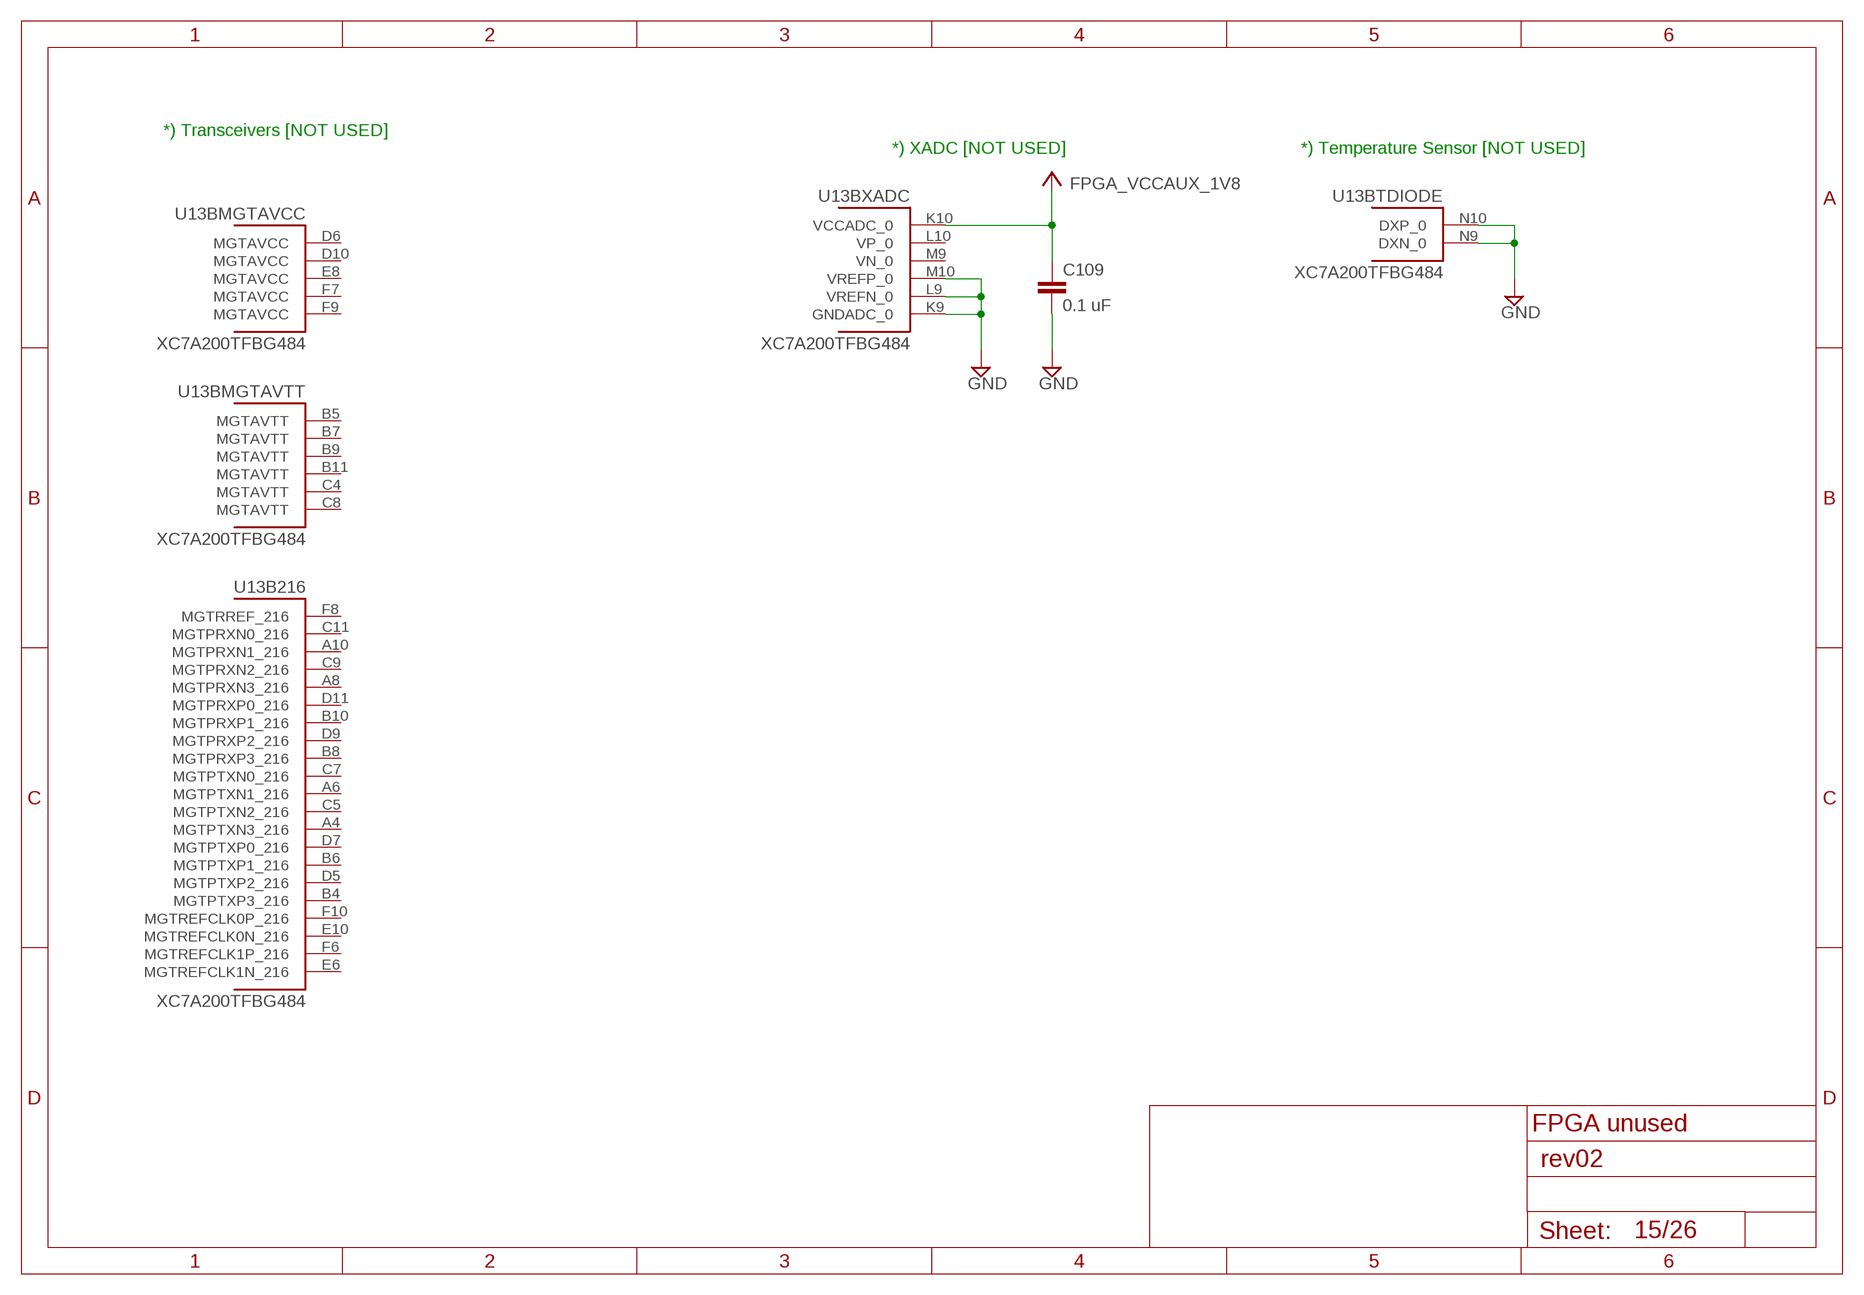
[diagram p14: schematic, sheet 15]

### Parts
C109  0.1 uF  C-EUC0402  [C0402]

### Nets
FPGA_VCCAUX_1V8: C109.1 U13.K10(BXADC:VCCADC_0) ; supply symbol labelled VCC ; also sheet 19,22,23
GND [Ground]: C109.2 U13.K9(BXADC:GNDADC_0) U13.L9(BXADC:VREFN_0) U13.M10(BXADC:VREFP_0) U13.N9(BTDIODE:DXN_0) U13.N10(BTDIODE:DXP_0) ; also sheet 2,3,4,5,7,8,9,10,11,12,13,14,16,19,20,22,23,24,25,26
Unconnected: U13.A4(B216:MGTPTXN3_216) U13.A6(B216:MGTPTXN1_216) U13.A8(B216:MGTPRXN3_216) U13.A10(B216:MGTPRXN1_216) U13.B4(B216:MGTPTXP3_216) U13.B5(BMGTAVTT:MGTAVTT) U13.B6(B216:MGTPTXP1_216) U13.B7(BMGTAVTT:MGTAVTT) U13.B8(B216:MGTPRXP3_216) U13.B9(BMGTAVTT:MGTAVTT) U13.B10(B216:MGTPRXP1_216) U13.B11(BMGTAVTT:MGTAVTT) U13.C4(BMGTAVTT:MGTAVTT) U13.C5(B216:MGTPTXN2_216) U13.C7(B216:MGTPTXN0_216) U13.C8(BMGTAVTT:MGTAVTT) U13.C9(B216:MGTPRXN2_216) U13.C11(B216:MGTPRXN0_216) U13.D5(B216:MGTPTXP2_216) U13.D6(BMGTAVCC:MGTAVCC) U13.D7(B216:MGTPTXP0_216) U13.D9(B216:MGTPRXP2_216) U13.D10(BMGTAVCC:MGTAVCC) U13.D11(B216:MGTPRXP0_216) U13.E6(B216:MGTREFCLK1N_216) U13.E8(BMGTAVCC:MGTAVCC) U13.E10(B216:MGTREFCLK0N_216) U13.F6(B216:MGTREFCLK1P_216) U13.F7(BMGTAVCC:MGTAVCC) U13.F8(B216:MGTRREF_216) U13.F9(BMGTAVCC:MGTAVCC) U13.F10(B216:MGTREFCLK0P_216) U13.L10(BXADC:VP_0) U13.M9(BXADC:VN_0)

### Notes on the sheet
- *) Transceivers [NOT USED]
- *) XADC [NOT USED] | *) Temperature Sensor [NOT USED]
- FPGA unused

## Sheet 16 of 26: FPGA supporting components
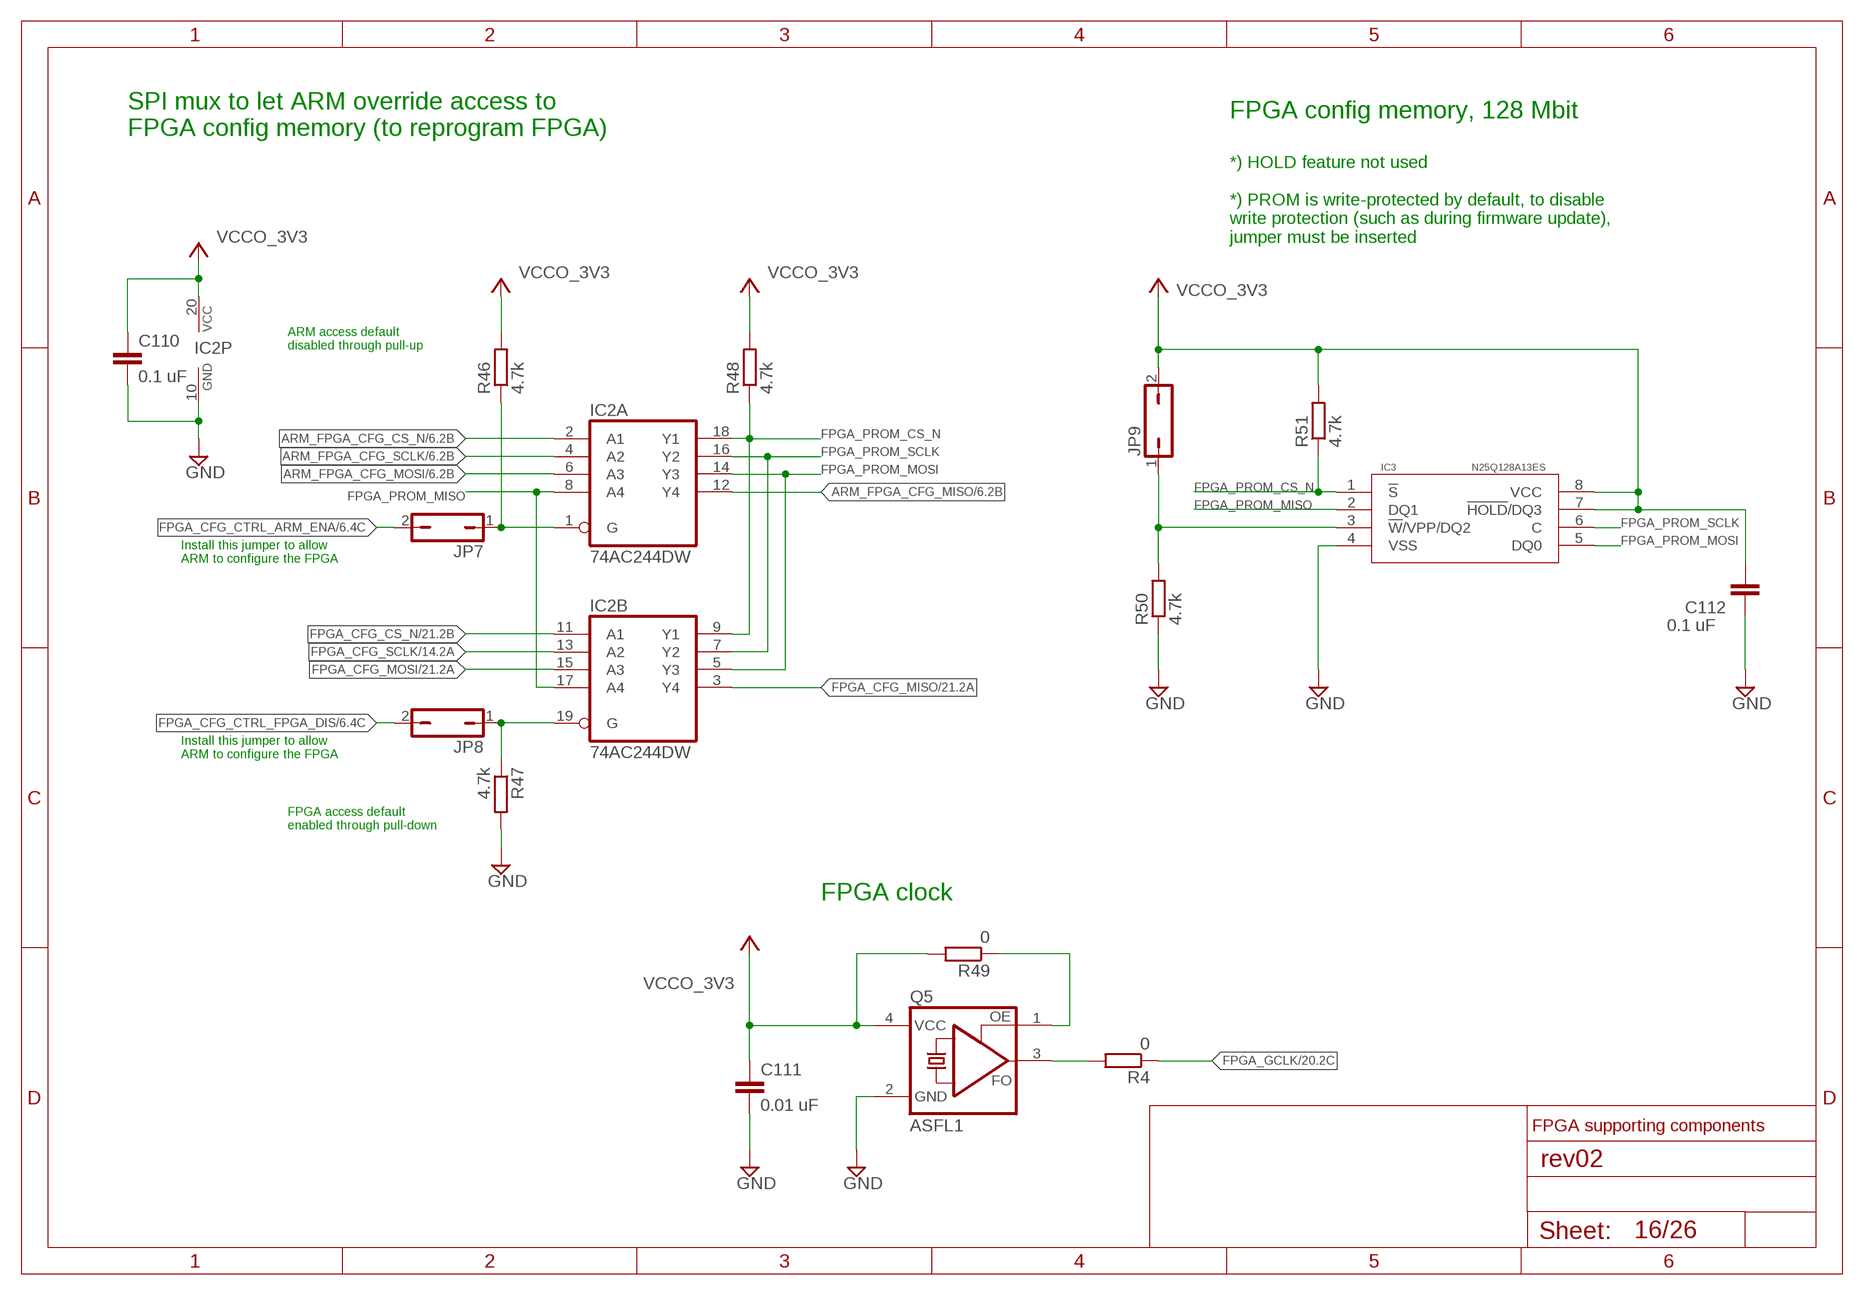
[diagram p15: schematic, sheet 16]

### Parts
C110  0.1 uF  C-EUC0402  [C0402]
C111  0.01 uF  C-EUC0402  [C0402]
C112  0.1 uF  C-EUC0402  [C0402]
IC2  74AC244DW  [SO20W]
IC3  N25Q128A13ES  [SO08]
JP7  JP1Q  [JP1]
JP8  JP1Q  [JP1]
JP9  JP1Q  [JP1]
Q5  ASFL1  [ASF]
R4  0  R-EU_R0402  [R0402]
R46  4.7k  R-EU_R0402  [R0402]
R47  4.7k  R-EU_R0402  [R0402]
R48  4.7k  R-EU_R0402  [R0402]
R49  0  R-EU_R0402  [R0402]
R50  4.7k  R-EU_R0402  [R0402]
R51  4.7k  R-EU_R0402  [R0402]

### Nets
ARM_FPGA_CFG_CS_N: IC2.2(A:A1) ; also sheet 6
ARM_FPGA_CFG_MISO: IC2.12(A:Y4) ; also sheet 6
ARM_FPGA_CFG_MOSI: IC2.6(A:A3) ; also sheet 6
ARM_FPGA_CFG_SCLK: IC2.4(A:A2) ; also sheet 6
FPGA_CFG_CS_N: IC2.11(B:A1) ; also sheet 21
FPGA_CFG_CTRL_ARM_ENA: JP7.2 ; also sheet 6
FPGA_CFG_CTRL_FPGA_DIS: JP8.2 ; also sheet 6
FPGA_CFG_MISO: IC2.3(B:Y4) ; also sheet 21
FPGA_CFG_MOSI: IC2.15(B:A3) ; also sheet 21
FPGA_CFG_SCLK: IC2.13(B:A2) ; also sheet 14
FPGA_PROM_CS_N: IC2.9(B:Y1) IC2.18(A:Y1) IC3.1(!S) R48.1 R51.1
FPGA_PROM_MISO: IC2.8(A:A4) IC2.17(B:A4) IC3.2(DQ1)
FPGA_PROM_MOSI: IC2.5(B:Y3) IC2.14(A:Y3) IC3.5(DQ0)
FPGA_PROM_SCLK: IC2.7(B:Y2) IC2.16(A:Y2) IC3.6(C)
FPGA_PROM_W_N: IC3.3(!W!/VPP/DQ2) JP9.1 R50.2
GND [Ground]: C110.2 C111.2 C112.2 IC2.10(P:GND) IC3.4(VSS) Q5.2(GND) R47.2 R50.1 ; also sheet 2,3,4,5,7,8,9,10,11,12,13,14,15,19,20,22,23,24,25,26
N$3: Q5.3(FO) R4.2
N$33: Q5.1(OE) R49.1
SPI_A_TRISTATE: IC2.1(A:G) JP7.1 R46.1
SPI_B_TRISTATE: IC2.19(B:G) JP8.1 R47.1
VCCO_3V3: C110.1 C111.1 C112.1 IC2.20(P:VCC) IC3.7(!HOLD!/DQ3) IC3.8(VCC) JP9.2 Q5.4(VCC) R46.2 R48.2 R49.2 R51.2 ; supply symbol labelled VCC ; also sheet 3,4,5,7,8,9,10,11,12,14,17,18,19,20,21,24
Unconnected: R4.1

### Notes on the sheet
- FPGA config memory, 128 Mbit
- SPI mux to let ARM override access to
  FPGA config memory (to reprogram FPGA)
- *) HOLD feature not used
  
  *) PROM is write-protected by default, to disable
  write protection (such as during firmware update),
  jumper must be inserted
- ARM access default
  disabled through pull-up
- Install this jumper to allow
  ARM to configure the FPGA
- Install this jumper to allow
  ARM to configure the FPGA
- FPGA access default
  enabled through pull-down
- FPGA clock
- FPGA supporting components

## Sheet 17 of 26: FPGA unused banks
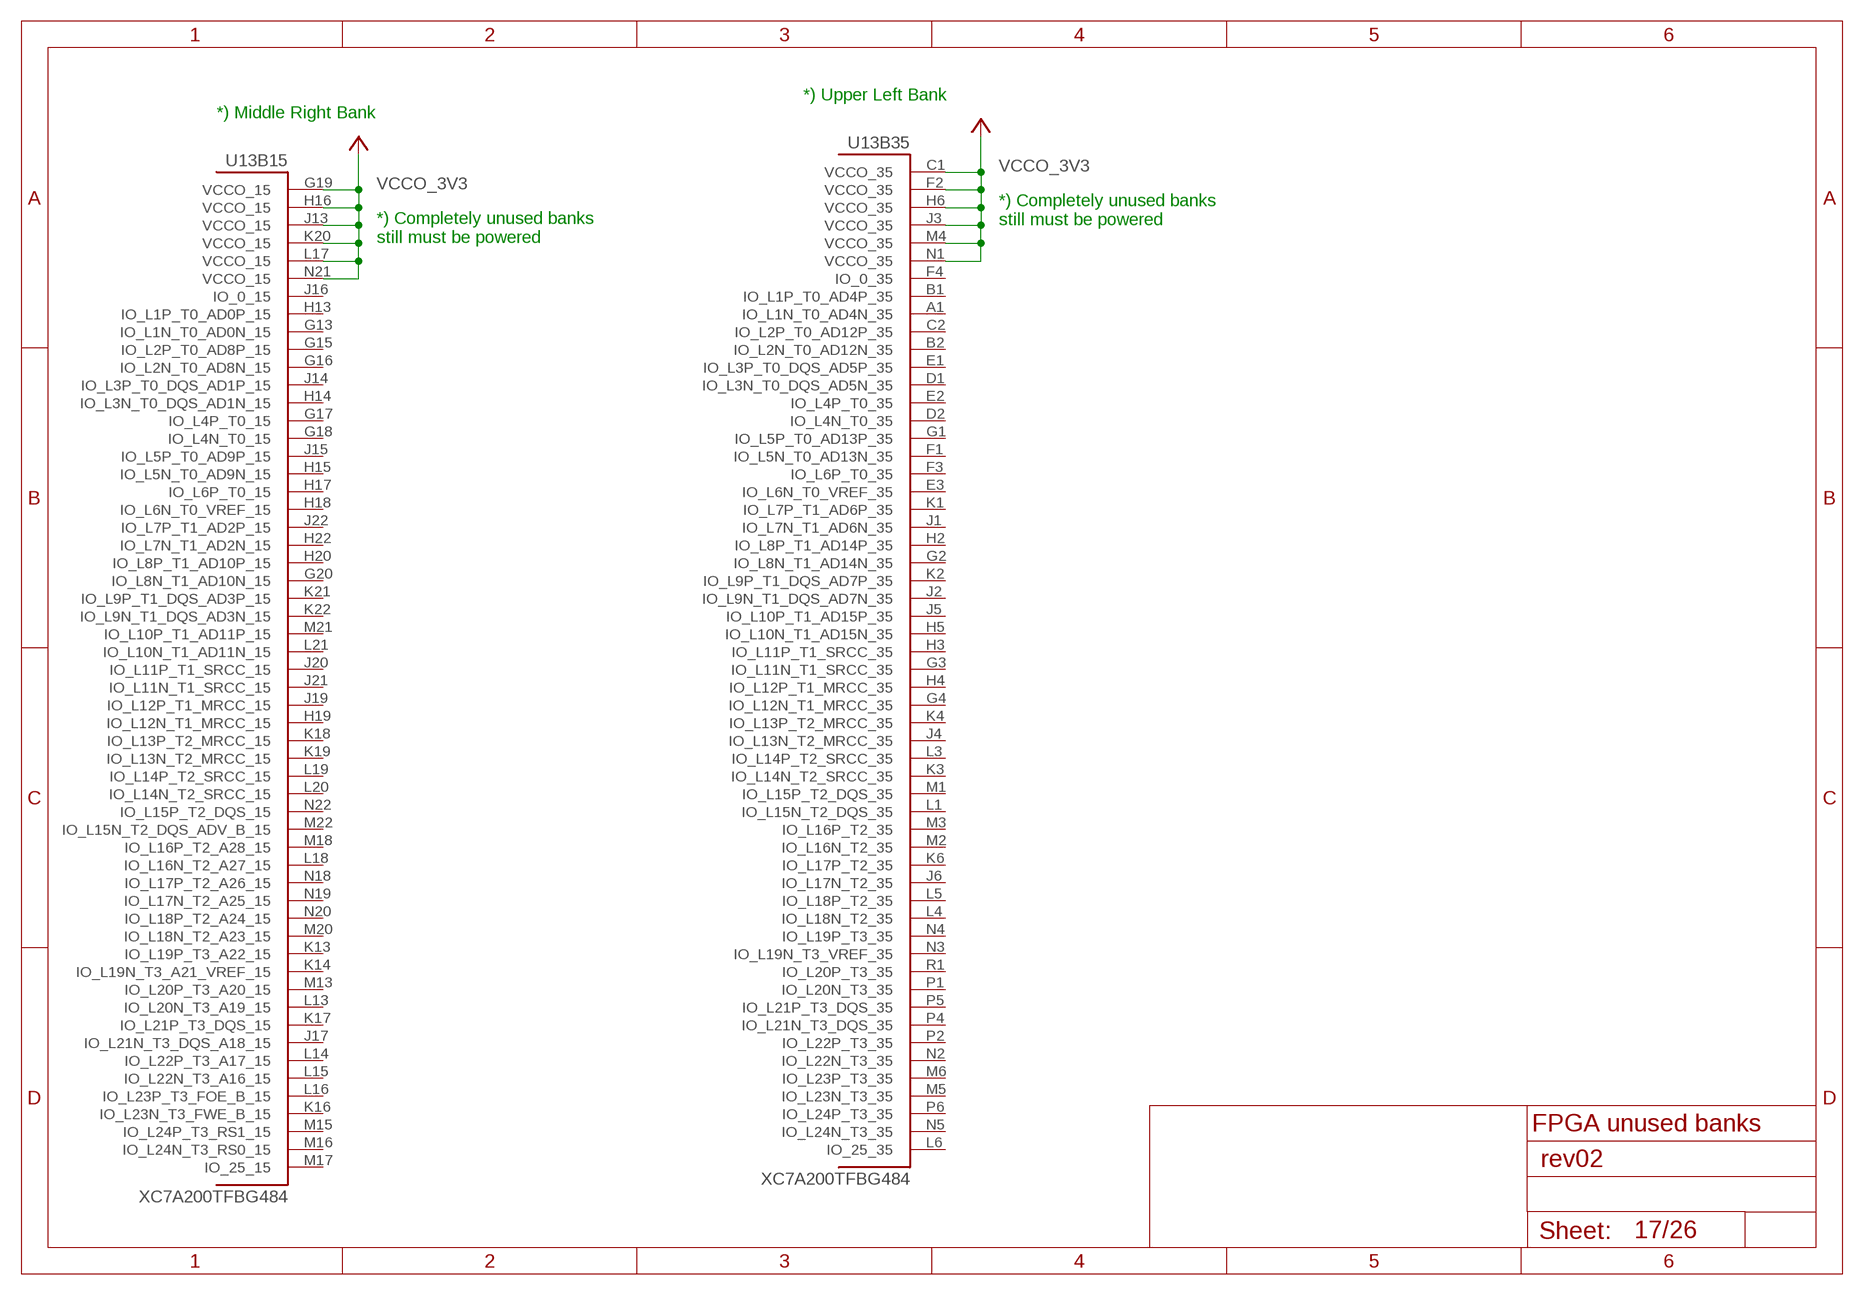
[diagram p16: schematic, sheet 17]

### Nets
VCCO_3V3: U13.C1(B35:VCCO_35) U13.F2(B35:VCCO_35) U13.G19(B15:VCCO_15) U13.H6(B35:VCCO_35) U13.H16(B15:VCCO_15) U13.J3(B35:VCCO_35) U13.J13(B15:VCCO_15) U13.K20(B15:VCCO_15) U13.L17(B15:VCCO_15) U13.M4(B35:VCCO_35) U13.N1(B35:VCCO_35) U13.N21(B15:VCCO_15) ; supply symbol labelled VCC ; also sheet 3,4,5,7,8,9,10,11,12,14,16,18,19,20,21,24
Unconnected: U13.A1(B35:IO_L1N_T0_AD4N_35) U13.B1(B35:IO_L1P_T0_AD4P_35) U13.B2(B35:IO_L2N_T0_AD12N_35) U13.C2(B35:IO_L2P_T0_AD12P_35) U13.D1(B35:IO_L3N_T0_DQS_AD5N_35) U13.D2(B35:IO_L4N_T0_35) U13.E1(B35:IO_L3P_T0_DQS_AD5P_35) U13.E2(B35:IO_L4P_T0_35) U13.E3(B35:IO_L6N_T0_VREF_35) U13.F1(B35:IO_L5N_T0_AD13N_35) U13.F3(B35:IO_L6P_T0_35) U13.F4(B35:IO_0_35) U13.G1(B35:IO_L5P_T0_AD13P_35) U13.G2(B35:IO_L8N_T1_AD14N_35) U13.G3(B35:IO_L11N_T1_SRCC_35) U13.G4(B35:IO_L12N_T1_MRCC_35) U13.G13(B15:IO_L1N_T0_AD0N_15) U13.G15(B15:IO_L2P_T0_AD8P_15) U13.G16(B15:IO_L2N_T0_AD8N_15) U13.G17(B15:IO_L4P_T0_15) U13.G18(B15:IO_L4N_T0_15) U13.G20(B15:IO_L8N_T1_AD10N_15) U13.H2(B35:IO_L8P_T1_AD14P_35) U13.H3(B35:IO_L11P_T1_SRCC_35) U13.H4(B35:IO_L12P_T1_MRCC_35) U13.H5(B35:IO_L10N_T1_AD15N_35) U13.H13(B15:IO_L1P_T0_AD0P_15) U13.H14(B15:IO_L3N_T0_DQS_AD1N_15) U13.H15(B15:IO_L5N_T0_AD9N_15) U13.H17(B15:IO_L6P_T0_15) U13.H18(B15:IO_L6N_T0_VREF_15) U13.H19(B15:IO_L12N_T1_MRCC_15) U13.H20(B15:IO_L8P_T1_AD10P_15) U13.H22(B15:IO_L7N_T1_AD2N_15) U13.J1(B35:IO_L7N_T1_AD6N_35) U13.J2(B35:IO_L9N_T1_DQS_AD7N_35) U13.J4(B35:IO_L13N_T2_MRCC_35) U13.J5(B35:IO_L10P_T1_AD15P_35) U13.J6(B35:IO_L17N_T2_35) U13.J14(B15:IO_L3P_T0_DQS_AD1P_15) U13.J15(B15:IO_L5P_T0_AD9P_15) U13.J16(B15:IO_0_15) U13.J17(B15:IO_L21N_T3_DQS_A18_15) U13.J19(B15:IO_L12P_T1_MRCC_15) U13.J20(B15:IO_L11P_T1_SRCC_15) U13.J21(B15:IO_L11N_T1_SRCC_15) U13.J22(B15:IO_L7P_T1_AD2P_15) U13.K1(B35:IO_L7P_T1_AD6P_35) U13.K2(B35:IO_L9P_T1_DQS_AD7P_35) U13.K3(B35:IO_L14N_T2_SRCC_35) U13.K4(B35:IO_L13P_T2_MRCC_35) U13.K6(B35:IO_L17P_T2_35) U13.K13(B15:IO_L19P_T3_A22_15) U13.K14(B15:IO_L19N_T3_A21_VREF_15) U13.K16(B15:IO_L23N_T3_FWE_B_15) U13.K17(B15:IO_L21P_T3_DQS_15) U13.K18(B15:IO_L13P_T2_MRCC_15) U13.K19(B15:IO_L13N_T2_MRCC_15) U13.K21(B15:IO_L9P_T1_DQS_AD3P_15) U13.K22(B15:IO_L9N_T1_DQS_AD3N_15) U13.L1(B35:IO_L15N_T2_DQS_35) U13.L3(B35:IO_L14P_T2_SRCC_35) U13.L4(B35:IO_L18N_T2_35) U13.L5(B35:IO_L18P_T2_35) U13.L6(B35:IO_25_35) U13.L13(B15:IO_L20N_T3_A19_15) U13.L14(B15:IO_L22P_T3_A17_15) U13.L15(B15:IO_L22N_T3_A16_15) U13.L16(B15:IO_L23P_T3_FOE_B_15) U13.L18(B15:IO_L16N_T2_A27_15) U13.L19(B15:IO_L14P_T2_SRCC_15) U13.L20(B15:IO_L14N_T2_SRCC_15) U13.L21(B15:IO_L10N_T1_AD11N_15) U13.M1(B35:IO_L15P_T2_DQS_35) U13.M2(B35:IO_L16N_T2_35) U13.M3(B35:IO_L16P_T2_35) U13.M5(B35:IO_L23N_T3_35) U13.M6(B35:IO_L23P_T3_35) U13.M13(B15:IO_L20P_T3_A20_15) U13.M15(B15:IO_L24P_T3_RS1_15) U13.M16(B15:IO_L24N_T3_RS0_15) U13.M17(B15:IO_25_15) U13.M18(B15:IO_L16P_T2_A28_15) U13.M20(B15:IO_L18N_T2_A23_15) U13.M21(B15:IO_L10P_T1_AD11P_15) U13.M22(B15:IO_L15N_T2_DQS_ADV_B_15) U13.N2(B35:IO_L22N_T3_35) U13.N3(B35:IO_L19N_T3_VREF_35) U13.N4(B35:IO_L19P_T3_35) U13.N5(B35:IO_L24N_T3_35) U13.N18(B15:IO_L17P_T2_A26_15) U13.N19(B15:IO_L17N_T2_A25_15) U13.N20(B15:IO_L18P_T2_A24_15) U13.N22(B15:IO_L15P_T2_DQS_15) U13.P1(B35:IO_L20N_T3_35) U13.P2(B35:IO_L22P_T3_35) U13.P4(B35:IO_L21N_T3_DQS_35) U13.P5(B35:IO_L21P_T3_DQS_35) U13.P6(B35:IO_L24P_T3_35) U13.R1(B35:IO_L20P_T3_35)

### Notes on the sheet
- *) Upper Left Bank
- *) Middle Right Bank
- *) Completely unused banks
  still must be powered
- *) Completely unused banks
  still must be powered
- FPGA unused banks

## Sheet 18 of 26: FPGA FMC interface
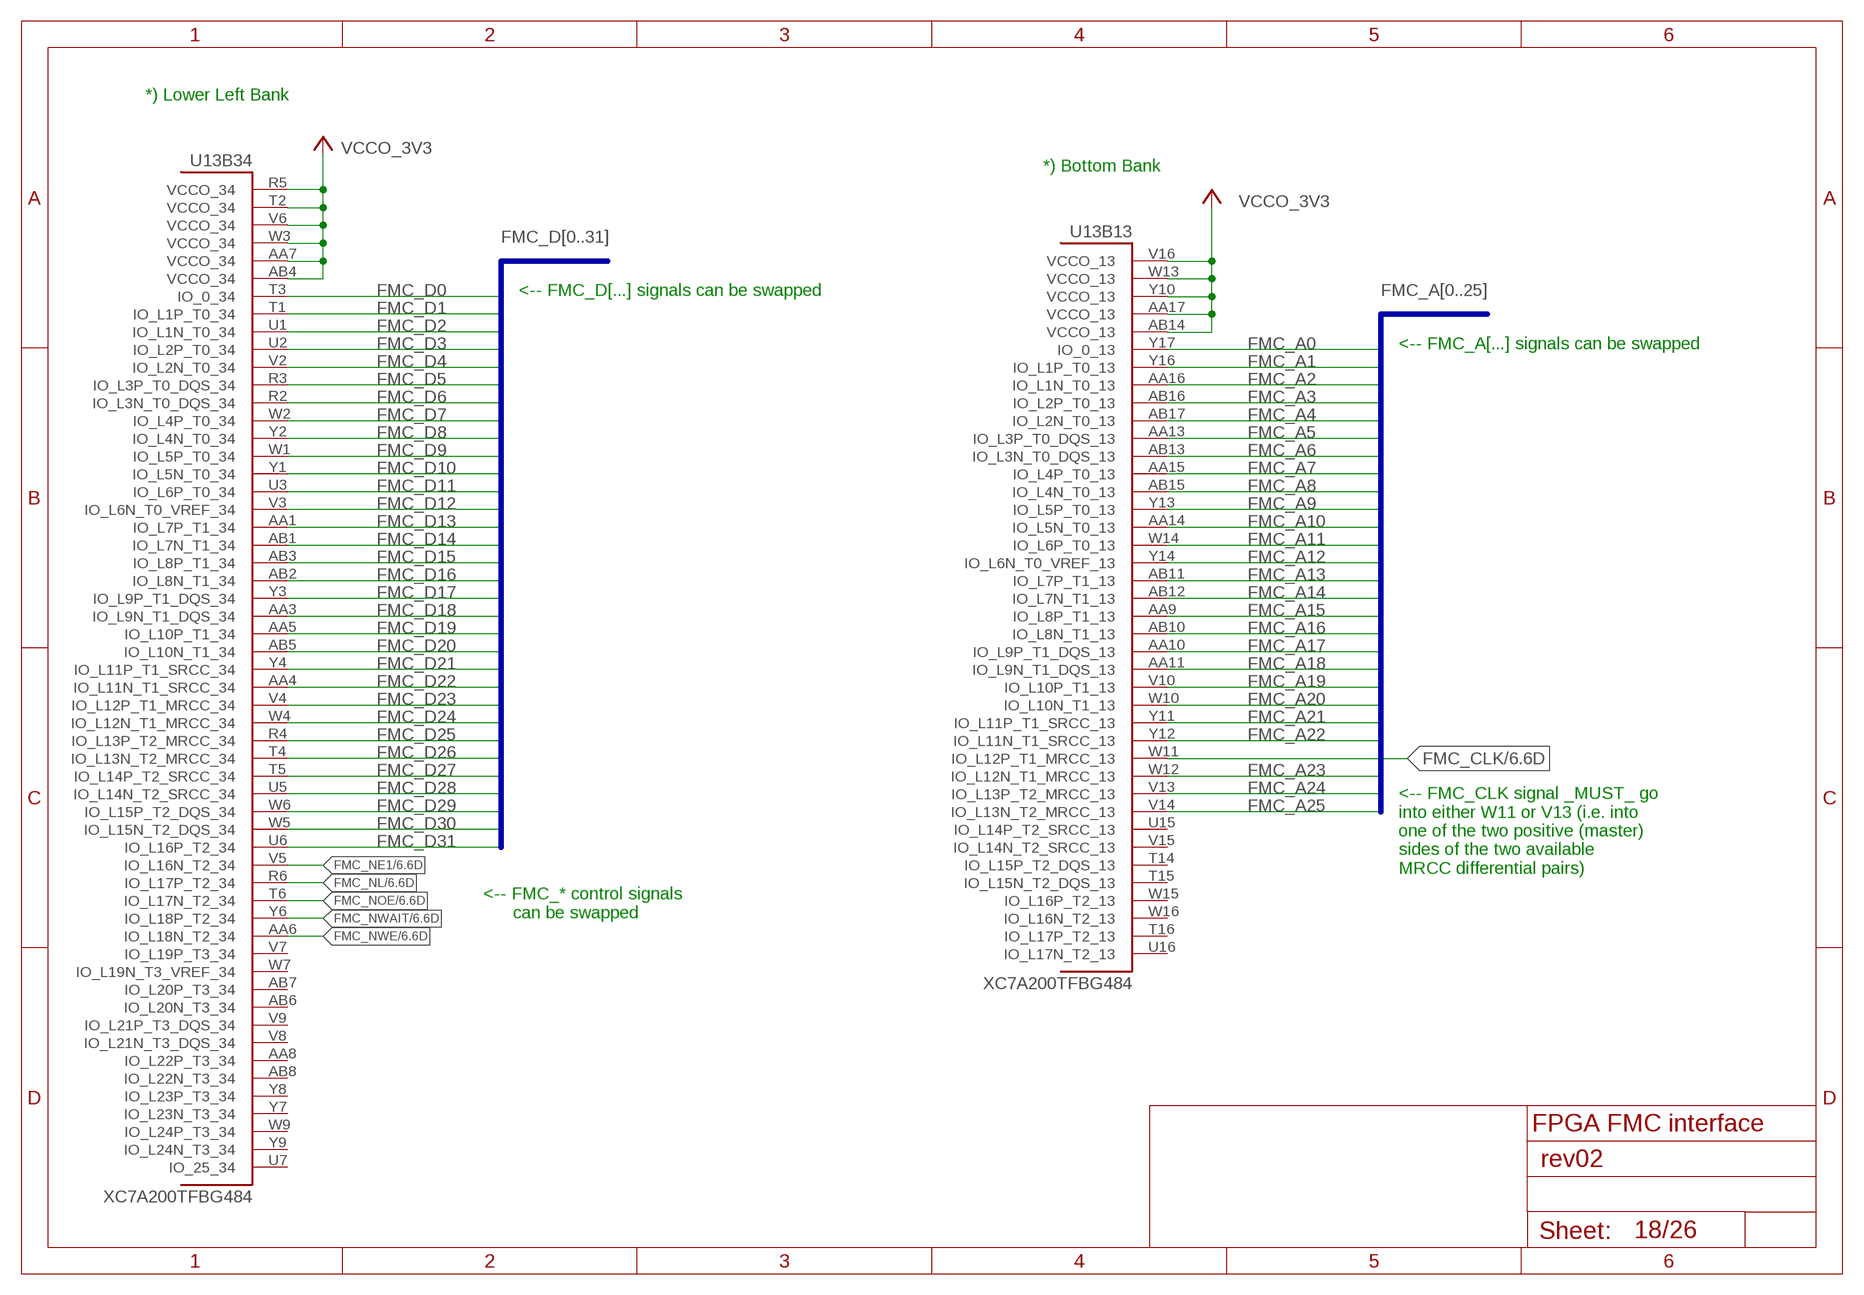
[diagram p17: schematic, sheet 18]

### Nets
FMC_A0 [FMC ADDR]: U13.Y17(B13:IO_0_13) ; also sheet 6,7
FMC_A1 [FMC ADDR]: U13.Y16(B13:IO_L1P_T0_13) ; also sheet 6,7
FMC_A2 [FMC ADDR]: U13.AA16(B13:IO_L1N_T0_13) ; also sheet 6,7
FMC_A3 [FMC ADDR]: U13.AB16(B13:IO_L2P_T0_13) ; also sheet 6,7
FMC_A4 [FMC ADDR]: U13.AB17(B13:IO_L2N_T0_13) ; also sheet 6,7
FMC_A5 [FMC ADDR]: U13.AA13(B13:IO_L3P_T0_DQS_13) ; also sheet 6,7
FMC_A6 [FMC ADDR]: U13.AB13(B13:IO_L3N_T0_DQS_13) ; also sheet 6,7
FMC_A7 [FMC ADDR]: U13.AA15(B13:IO_L4P_T0_13) ; also sheet 6,7
FMC_A8 [FMC ADDR]: U13.AB15(B13:IO_L4N_T0_13) ; also sheet 6,7
FMC_A9 [FMC ADDR]: U13.Y13(B13:IO_L5P_T0_13) ; also sheet 6,7
FMC_A10 [FMC ADDR]: U13.AA14(B13:IO_L5N_T0_13) ; also sheet 6,7
FMC_A11 [FMC ADDR]: U13.W14(B13:IO_L6P_T0_13) ; also sheet 6,7
FMC_A12 [FMC ADDR]: U13.Y14(B13:IO_L6N_T0_VREF_13) ; also sheet 6,7
FMC_A13 [FMC ADDR]: U13.AB11(B13:IO_L7P_T1_13) ; also sheet 6
FMC_A14 [FMC ADDR]: U13.AB12(B13:IO_L7N_T1_13) ; also sheet 6,7
FMC_A15 [FMC ADDR]: U13.AA9(B13:IO_L8P_T1_13) ; also sheet 6,7
FMC_A16 [FMC ADDR]: U13.AB10(B13:IO_L8N_T1_13) ; also sheet 6
FMC_A17 [FMC ADDR]: U13.AA10(B13:IO_L9P_T1_DQS_13) ; also sheet 6
FMC_A18 [FMC ADDR]: U13.AA11(B13:IO_L9N_T1_DQS_13) ; also sheet 6
FMC_A19 [FMC ADDR]: U13.V10(B13:IO_L10P_T1_13) ; also sheet 6
FMC_A20: U13.W10(B13:IO_L10N_T1_13) ; also sheet 6
FMC_A21: U13.Y11(B13:IO_L11P_T1_SRCC_13) ; also sheet 6
FMC_A22: U13.Y12(B13:IO_L11N_T1_SRCC_13) ; also sheet 6
FMC_A23: U13.W12(B13:IO_L12N_T1_MRCC_13) ; also sheet 6
FMC_A24: U13.V13(B13:IO_L13P_T2_MRCC_13) ; also sheet 6
FMC_A25: U13.V14(B13:IO_L13N_T2_MRCC_13) ; also sheet 6
FMC_CLK: U13.W11(B13:IO_L12P_T1_MRCC_13) ; also sheet 6
FMC_D0 [FMC DATA]: U13.T3(B34:IO_0_34) ; also sheet 6,7
FMC_D1 [FMC DATA]: U13.T1(B34:IO_L1P_T0_34) ; also sheet 6,7
FMC_D2 [FMC DATA]: U13.U1(B34:IO_L1N_T0_34) ; also sheet 6,7
FMC_D3 [FMC DATA]: U13.U2(B34:IO_L2P_T0_34) ; also sheet 6,7
FMC_D4 [FMC DATA]: U13.V2(B34:IO_L2N_T0_34) ; also sheet 6,7
FMC_D5 [FMC DATA]: U13.R3(B34:IO_L3P_T0_DQS_34) ; also sheet 6,7
FMC_D6 [FMC DATA]: U13.R2(B34:IO_L3N_T0_DQS_34) ; also sheet 6,7
FMC_D7 [FMC DATA]: U13.W2(B34:IO_L4P_T0_34) ; also sheet 6,7
FMC_D8 [FMC DATA]: U13.Y2(B34:IO_L4N_T0_34) ; also sheet 6,7
FMC_D9 [FMC DATA]: U13.W1(B34:IO_L5P_T0_34) ; also sheet 6
FMC_D10 [FMC DATA]: U13.Y1(B34:IO_L5N_T0_34) ; also sheet 6,7
FMC_D11 [FMC DATA]: U13.U3(B34:IO_L6P_T0_34) ; also sheet 6,7
FMC_D12 [FMC DATA]: U13.V3(B34:IO_L6N_T0_VREF_34) ; also sheet 6,7
FMC_D13 [FMC DATA]: U13.AA1(B34:IO_L7P_T1_34) ; also sheet 6,7
FMC_D14 [FMC DATA]: U13.AB1(B34:IO_L7N_T1_34) ; also sheet 6,7
FMC_D15 [FMC DATA]: U13.AB3(B34:IO_L8P_T1_34) ; also sheet 6,7
FMC_D16 [FMC DATA]: U13.AB2(B34:IO_L8N_T1_34) ; also sheet 6,7
FMC_D17 [FMC DATA]: U13.Y3(B34:IO_L9P_T1_DQS_34) ; also sheet 6,7
FMC_D18 [FMC DATA]: U13.AA3(B34:IO_L9N_T1_DQS_34) ; also sheet 6,7
FMC_D19 [FMC DATA]: U13.AA5(B34:IO_L10P_T1_34) ; also sheet 6,7
FMC_D20 [FMC DATA]: U13.AB5(B34:IO_L10N_T1_34) ; also sheet 6,7
FMC_D21 [FMC DATA]: U13.Y4(B34:IO_L11P_T1_SRCC_34) ; also sheet 6,7
FMC_D22 [FMC DATA]: U13.AA4(B34:IO_L11N_T1_SRCC_34) ; also sheet 6,7
FMC_D23 [FMC DATA]: U13.V4(B34:IO_L12P_T1_MRCC_34) ; also sheet 6,7
FMC_D24 [FMC DATA]: U13.W4(B34:IO_L12N_T1_MRCC_34) ; also sheet 6,7
FMC_D25 [FMC DATA]: U13.R4(B34:IO_L13P_T2_MRCC_34) ; also sheet 6,7
FMC_D26 [FMC DATA]: U13.T4(B34:IO_L13N_T2_MRCC_34) ; also sheet 6,7
FMC_D27 [FMC DATA]: U13.T5(B34:IO_L14P_T2_SRCC_34) ; also sheet 6,7
FMC_D28 [FMC DATA]: U13.U5(B34:IO_L14N_T2_SRCC_34) ; also sheet 6,7
FMC_D29 [FMC DATA]: U13.W6(B34:IO_L15P_T2_DQS_34) ; also sheet 6,7
FMC_D30 [FMC DATA]: U13.W5(B34:IO_L15N_T2_DQS_34) ; also sheet 6,7
FMC_D31 [FMC DATA]: U13.U6(B34:IO_L16P_T2_34) ; also sheet 6,7
FMC_NE1: U13.V5(B34:IO_L16N_T2_34) ; also sheet 6
FMC_NL: U13.R6(B34:IO_L17P_T2_34) ; also sheet 6
FMC_NOE: U13.T6(B34:IO_L17N_T2_34) ; also sheet 6
FMC_NWAIT: U13.Y6(B34:IO_L18P_T2_34) ; also sheet 6
FMC_NWE: U13.AA6(B34:IO_L18N_T2_34) ; also sheet 6
VCCO_3V3: U13.AA7(B34:VCCO_34) U13.AA17(B13:VCCO_13) U13.AB4(B34:VCCO_34) U13.AB14(B13:VCCO_13) U13.R5(B34:VCCO_34) U13.T2(B34:VCCO_34) U13.V6(B34:VCCO_34) U13.V16(B13:VCCO_13) U13.W3(B34:VCCO_34) U13.W13(B13:VCCO_13) U13.Y10(B13:VCCO_13) ; supply symbol labelled VCC ; also sheet 3,4,5,7,8,9,10,11,12,14,16,17,19,20,21,24
Unconnected: U13.AA8(B34:IO_L22P_T3_34) U13.AB6(B34:IO_L20N_T3_34) U13.AB7(B34:IO_L20P_T3_34) U13.AB8(B34:IO_L22N_T3_34) U13.T14(B13:IO_L15P_T2_DQS_13) U13.T15(B13:IO_L15N_T2_DQS_13) U13.T16(B13:IO_L17P_T2_13) U13.U7(B34:IO_25_34) U13.U15(B13:IO_L14P_T2_SRCC_13) U13.U16(B13:IO_L17N_T2_13) U13.V7(B34:IO_L19P_T3_34) U13.V8(B34:IO_L21N_T3_DQS_34) U13.V9(B34:IO_L21P_T3_DQS_34) U13.V15(B13:IO_L14N_T2_SRCC_13) U13.W7(B34:IO_L19N_T3_VREF_34) U13.W9(B34:IO_L24P_T3_34) U13.W15(B13:IO_L16P_T2_13) U13.W16(B13:IO_L16N_T2_13) U13.Y7(B34:IO_L23N_T3_34) U13.Y8(B34:IO_L23P_T3_34) U13.Y9(B34:IO_L24N_T3_34)

### Buses
FMC_A[0..25]
FMC_D[0..31]

### Notes on the sheet
- *) Lower Left Bank
- *) Bottom Bank
- <-- FMC_D[...] signals can be swapped
- <-- FMC_A[...] signals can be swapped
- <-- FMC_CLK signal _MUST_ go
  into either W11 or V13 (i.e. into
  one of the two positive (master)
  sides of the two available
  MRCC differential pairs)
- <-- FMC_* control signals
        can be swapped
- FPGA FMC interface